# EAGLE schematic PKG900000001531 (EAGLE 7.7.0), part 1 of 2

## Sheet 1 of 32
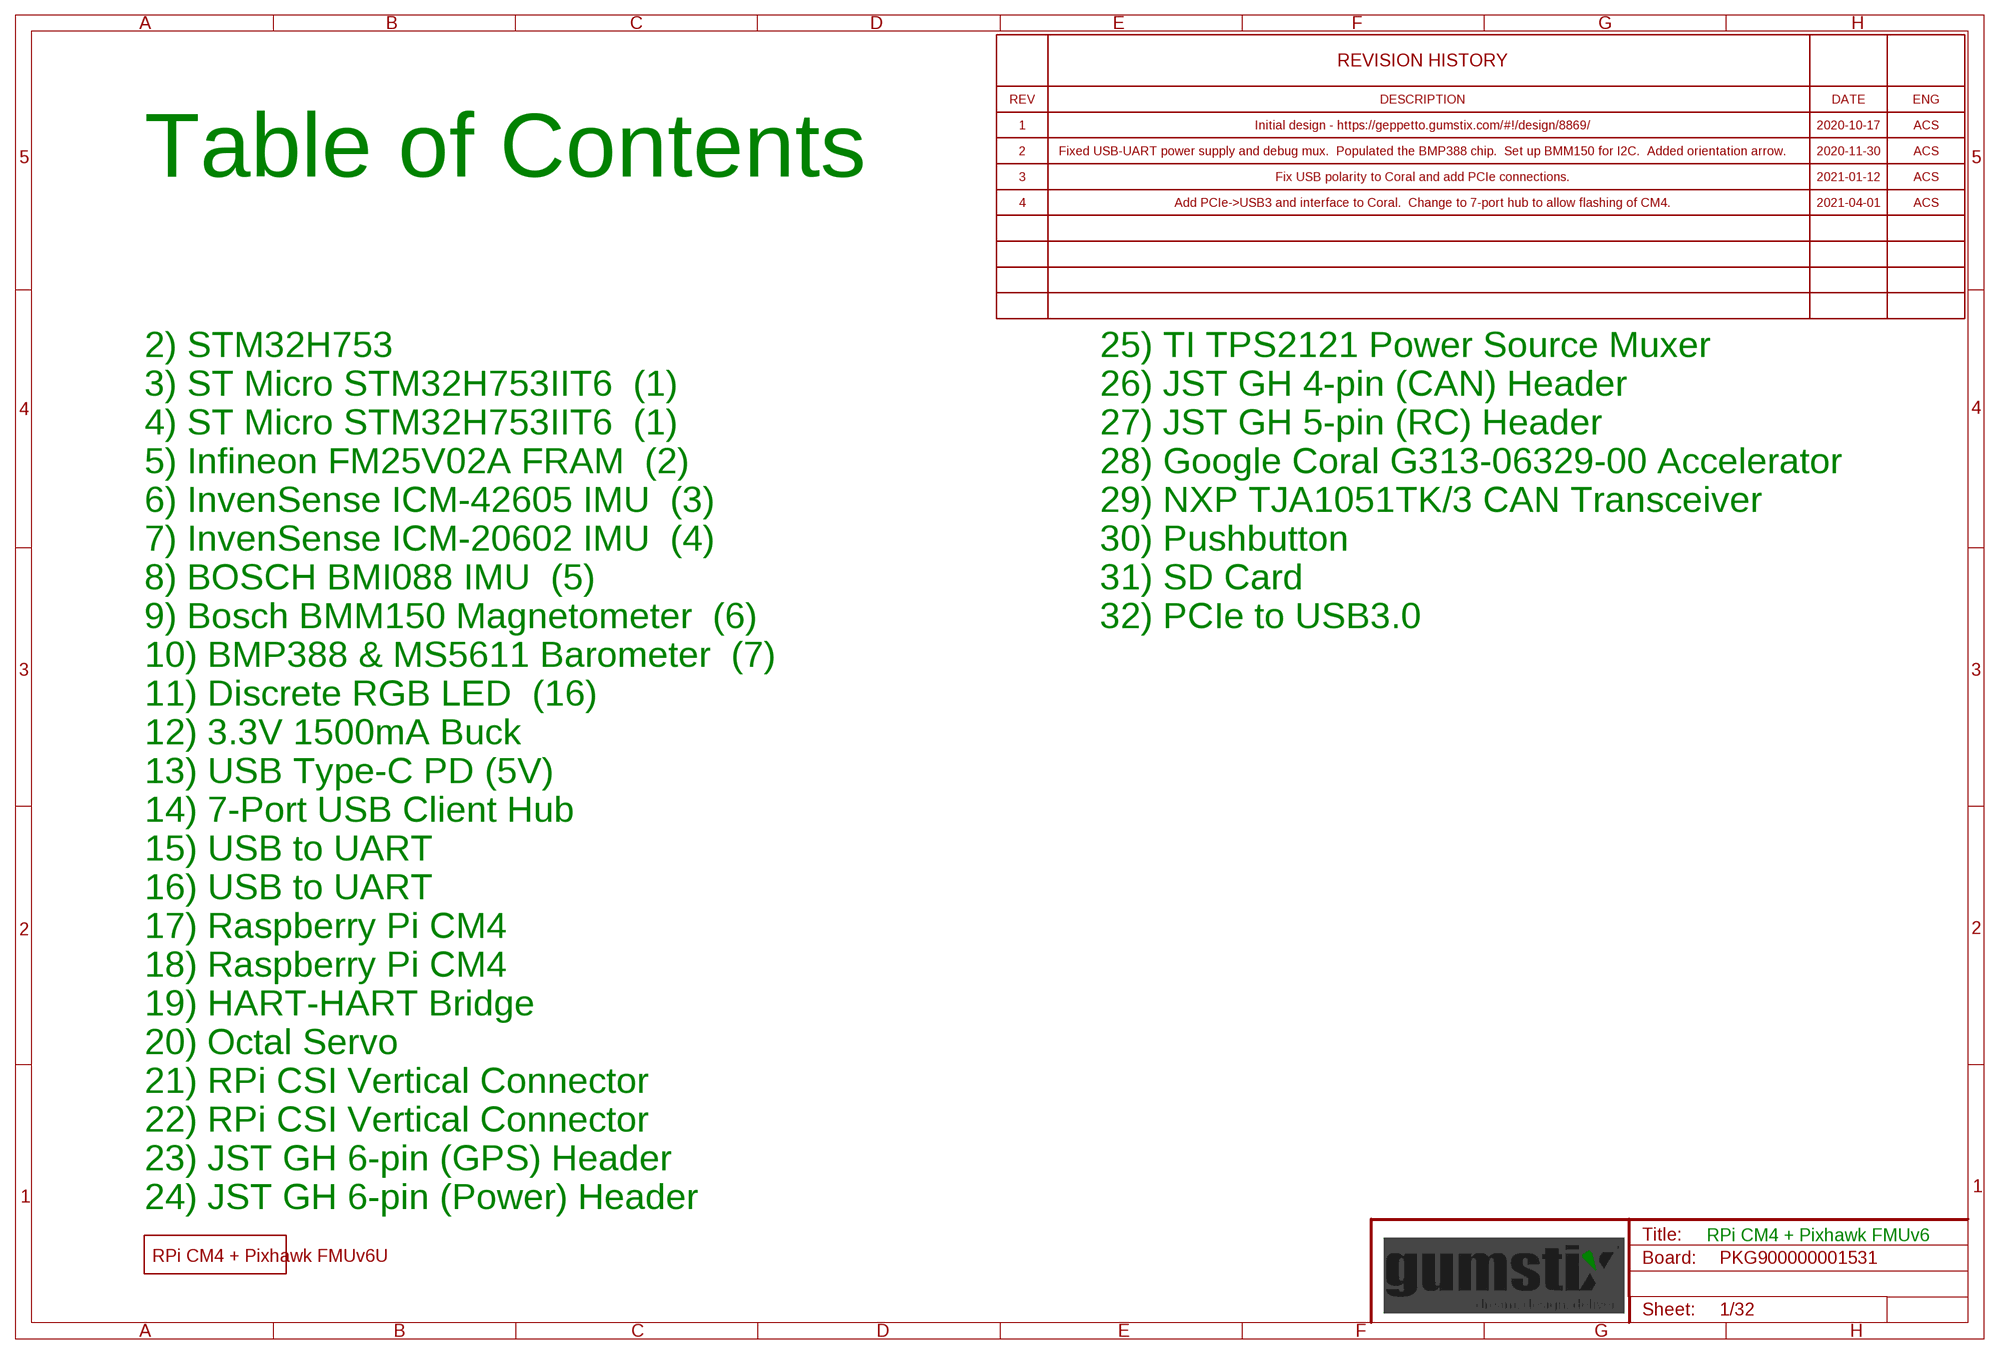
[diagram p0: schematic, sheet 1]
U$3 (REVISION_HISTORY_8): VALUE: DNP

### Parts
FD1  DNP  FIDUCIAL  [FIDUCIAL]
FD2  DNP  FIDUCIAL  [FIDUCIAL]
FD3  DNP  FIDUCIAL  [FIDUCIAL]
FD4  DNP  FIDUCIAL  [FIDUCIAL]
FD5  DNP  FIDUCIAL  [FIDUCIAL]
FD6  DNP  FIDUCIAL  [FIDUCIAL]
FD7  DNP  FIDUCIAL  [FIDUCIAL]
FD8  DNP  FIDUCIAL  [FIDUCIAL]
U$2  DNP  UPVERTER_LABELSMALL  [UPVERTER_LABEL_SMALL]

### Notes on the sheet
- 1 | Initial design - https://geppetto.gumstix.com/#\!/design/8869/ | 2020-10-17 | ACS
- 2 | Fixed USB-UART power supply and debug mux.  Populated the BMP388 chip.  Set up BMM150 for I2C.  Added orientation arrow. | 2020-11-30 | ACS
- Table of Contents | 3 | Fix USB polarity to Coral and add PCIe connections. | 2021-01-12 | ACS
- 4 | Add PCIe->USB3 and interface to Coral.  Change to 7-port hub to allow flashing of CM4. | 2021-04-01 | ACS
- 2) STM32H753 | 25) TI TPS2121 Power Source Muxer
- 3) ST Micro STM32H753IIT6  (1) | 26) JST GH 4-pin (CAN) Header
- 4) ST Micro STM32H753IIT6  (1) | 27) JST GH 5-pin (RC) Header
- 5) Infineon FM25V02A FRAM  (2) | 28) Google Coral G313-06329-00 Accelerator
- 6) InvenSense ICM-42605 IMU  (3) | 29) NXP TJA1051TK/3 CAN Transceiver
- 7) InvenSense ICM-20602 IMU  (4) | 30) Pushbutton
- 8) BOSCH BMI088 IMU  (5) | 31) SD Card
- 9) Bosch BMM150 Magnetometer  (6) | 32) PCIe to USB3.0
- 10) BMP388 & MS5611 Barometer  (7)
- 11) Discrete RGB LED  (16)
- 12) 3.3V 1500mA Buck
- 13) USB Type-C PD (5V)
- 14) 7-Port USB Client Hub
- 15) USB to UART
- 16) USB to UART
- 17) Raspberry Pi CM4
- 18) Raspberry Pi CM4
- 19) HART-HART Bridge
- 20) Octal Servo
- 21) RPi CSI Vertical Connector
- 22) RPi CSI Vertical Connector
- 23) JST GH 6-pin (GPS) Header
- 24) JST GH 6-pin (Power) Header
- RPi CM4 + Pixhawk FMUv6

## Sheet 2 of 32
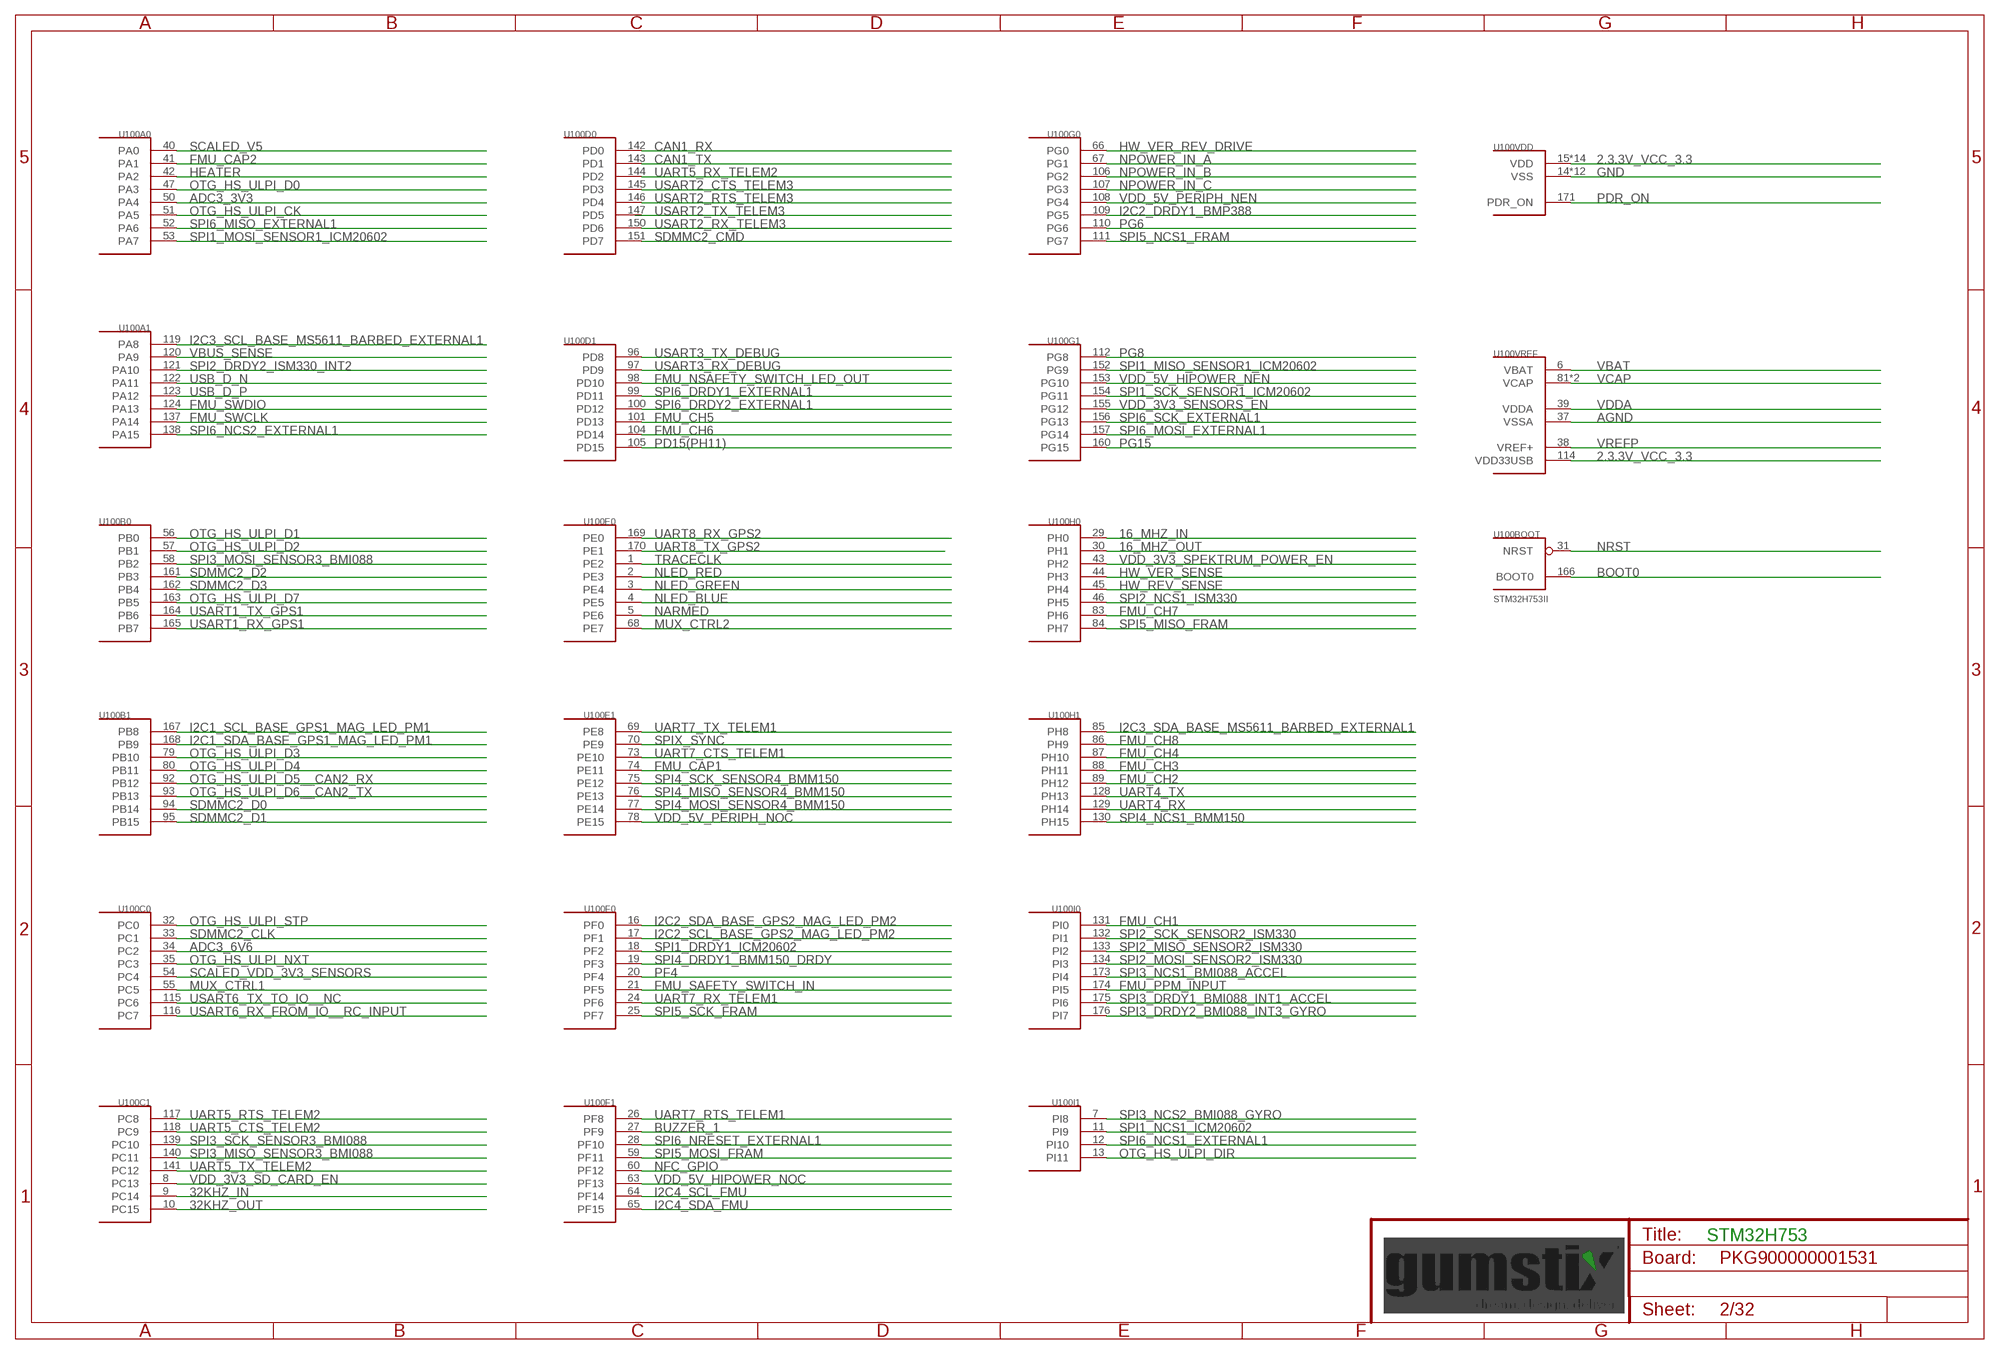
[diagram p1: schematic, sheet 2]

### Parts
U100  STM32H753II  [LQFP176]

### Nets
2.3.3V_VCC_3.3 [supply]: U100.15(VDD:VDD) U100.23(VDD:VDD) U100.36(VDD:VDD) U100.49(VDD:VDD) U100.62(VDD:VDD) U100.72(VDD:VDD) U100.82(VDD:VDD) U100.91(VDD:VDD) U100.103(VDD:VDD) U100.114(VREF:VDD33USB) U100.127(VDD:VDD) U100.136(VDD:VDD) U100.149(VDD:VDD) U100.159(VDD:VDD) U100.172(VDD:VDD) ; also sheet 3,4,5,11,12,14,15,19,20,21,22,29,30,32
16_MHZ_IN: U100.29(H0:PH0) ; also sheet 3
16_MHZ_OUT: U100.30(H0:PH1) ; also sheet 3
32KHZ_IN: U100.9(C1:PC14) ; also sheet 3
32KHZ_OUT: U100.10(C1:PC15) ; also sheet 3
ADC3_3V3: U100.50(A0:PA4) ; also sheet 24
ADC3_6V6: U100.34(C0:PC2) ; also sheet 24
AGND [supply]: U100.37(VREF:VSSA) ; also sheet 3
BOOT0: U100.166(BOOT:BOOT0) ; also sheet 3
BUZZER_1: U100.27(F1:PF9)
CAN1_RX: U100.142(D0:PD0) ; also sheet 29
CAN1_TX: U100.143(D0:PD1) ; also sheet 29
FMU_CAP1: U100.74(E1:PE11)
FMU_CAP2: U100.41(A0:PA1)
FMU_CH1: U100.131(I0:PI0) ; also sheet 20
FMU_CH2: U100.89(H1:PH12) ; also sheet 20
FMU_CH3: U100.88(H1:PH11) ; also sheet 20
FMU_CH4: U100.87(H1:PH10) ; also sheet 20
FMU_CH5: U100.101(D1:PD13) ; also sheet 20
FMU_CH6: U100.104(D1:PD14) ; also sheet 20
FMU_CH7: U100.83(H0:PH6) ; also sheet 20
FMU_CH8: U100.86(H1:PH9) ; also sheet 20
FMU_NSAFETY_SWITCH_LED_OUT: U100.98(D1:PD10)
FMU_PPM_INPUT: U100.174(I0:PI5) ; also sheet 27
FMU_SAFETY_SWITCH_IN: U100.21(F0:PF5)
FMU_SWCLK: U100.137(A1:PA14) ; also sheet 3
FMU_SWDIO: U100.124(A1:PA13) ; also sheet 3
GND [supply]: U100.14(VDD:VSS) U100.22(VDD:VSS) U100.48(VDD:VSS) U100.61(VDD:VSS) U100.71(VDD:VSS) U100.90(VDD:VSS) U100.102(VDD:VSS) U100.113(VDD:VSS) U100.126(VDD:VSS) U100.135(VDD:VSS) U100.148(VDD:VSS) U100.158(VDD:VSS) ; also sheet 3,4,5,6,7,8,9,10,12,13,14,15,16,17,18,19,20,21,22,23,24,25,26,27,28,29,30,31,32
HEATER: U100.42(A0:PA2)
HW_REV_SENSE: U100.45(H0:PH4) ; also sheet 3
HW_VER_REV_DRIVE: U100.66(PG0) ; also sheet 3
HW_VER_SENSE: U100.44(H0:PH3) ; also sheet 3
I2C1_SCL_BASE_GPS1_MAG_LED_PM1: U100.167(B1:PB8) ; also sheet 23
I2C1_SDA_BASE_GPS1_MAG_LED_PM1: U100.168(B1:PB9) ; also sheet 23
I2C2_DRDY1_BMP388: U100.109(PG5) ; also sheet 10
I2C2_SCL_BASE_GPS2_MAG_LED_PM2: U100.17(F0:PF1)
I2C2_SDA_BASE_GPS2_MAG_LED_PM2: U100.16(F0:PF0)
I2C3_SCL_BASE_MS5611_BARBED_EXTERNAL1: U100.119(A1:PA8) ; also sheet 10
I2C3_SDA_BASE_MS5611_BARBED_EXTERNAL1: U100.85(H1:PH8) ; also sheet 10
I2C4_SCL_FMU: U100.64(F1:PF14) ; also sheet 9,10
I2C4_SDA_FMU: U100.65(F1:PF15) ; also sheet 9,10
MUX_CTRL1: U100.55(C0:PC5)
MUX_CTRL2: U100.68(E0:PE7)
NARMED: U100.5(E0:PE6)
NFC_GPIO: U100.60(F1:PF12) ; also sheet 3
NLED_BLUE: U100.4(E0:PE5) ; also sheet 11
NLED_GREEN: U100.3(E0:PE4) ; also sheet 11
NLED_RED: U100.2(E0:PE3) ; also sheet 11
NPOWER_IN_A: U100.67(PG1)
NPOWER_IN_B: U100.106(PG2)
NPOWER_IN_C: U100.107(PG3)
NRST: U100.31(BOOT:NRST) ; also sheet 3,30
OTG_HS_ULPI_CK: U100.51(A0:PA5) ; also sheet 4
OTG_HS_ULPI_D0: U100.47(A0:PA3) ; also sheet 4
OTG_HS_ULPI_D1: U100.56(B0:PB0) ; also sheet 4
OTG_HS_ULPI_D2: U100.57(B0:PB1) ; also sheet 4
OTG_HS_ULPI_D3: U100.79(B1:PB10) ; also sheet 4
OTG_HS_ULPI_D4: U100.80(B1:PB11) ; also sheet 4
OTG_HS_ULPI_D5__CAN2_RX: U100.92(B1:PB12) ; also sheet 4
OTG_HS_ULPI_D6__CAN2_TX: U100.93(B1:PB13) ; also sheet 4
OTG_HS_ULPI_D7: U100.163(B0:PB5) ; also sheet 4
OTG_HS_ULPI_DIR: U100.13(I1:PI11) ; also sheet 4
OTG_HS_ULPI_NXT: U100.35(C0:PC3) ; also sheet 4
OTG_HS_ULPI_STP: U100.32(C0:PC0) ; also sheet 4
PD15(PH11): U100.105(D1:PD15) ; also sheet 3
PDR_ON: U100.171(VDD:PDR_ON) ; also sheet 3
PF4: U100.20(F0:PF4)
PG6: U100.110(PG6)
PG8: U100.112(PG8)
PG15: U100.160(PG15)
SCALED_V5 [supply]: U100.40(A0:PA0) ; also sheet 3
SCALED_VDD_3V3_SENSORS: U100.54(C0:PC4) ; also sheet 3
SDMMC2_CLK: U100.33(C0:PC1) ; also sheet 31
SDMMC2_CMD: U100.151(D0:PD7) ; also sheet 31
SDMMC2_D0: U100.94(B1:PB14) ; also sheet 31
SDMMC2_D1: U100.95(B1:PB15) ; also sheet 31
SDMMC2_D2: U100.161(B0:PB3) ; also sheet 31
SDMMC2_D3: U100.162(B0:PB4) ; also sheet 31
SPI1_DRDY1_ICM20602: U100.18(F0:PF2) ; also sheet 7
SPI1_MISO_SENSOR1_ICM20602: U100.152(PG9) ; also sheet 7
SPI1_MOSI_SENSOR1_ICM20602: U100.53(A0:PA7) ; also sheet 7
SPI1_NCS1_ICM20602: U100.11(I1:PI9) ; also sheet 7
SPI1_SCK_SENSOR1_ICM20602: U100.154(PG11) ; also sheet 7
SPI2_DRDY2_ISM330_INT2: U100.121(A1:PA10) ; also sheet 6
SPI2_MISO_SENSOR2_ISM330: U100.133(I0:PI2) ; also sheet 6
SPI2_MOSI_SENSOR2_ISM330: U100.134(I0:PI3) ; also sheet 6
SPI2_NCS1_ISM330: U100.46(H0:PH5) ; also sheet 6
SPI2_SCK_SENSOR2_ISM330: U100.132(I0:PI1) ; also sheet 6
SPI3_DRDY1_BMI088_INT1_ACCEL: U100.175(I0:PI6) ; also sheet 8
SPI3_DRDY2_BMI088_INT3_GYRO: U100.176(I0:PI7) ; also sheet 8
SPI3_MISO_SENSOR3_BMI088: U100.140(C1:PC11) ; also sheet 8
SPI3_MOSI_SENSOR3_BMI088: U100.58(B0:PB2) ; also sheet 8
SPI3_NCS1_BMI088_ACCEL: U100.173(I0:PI4) ; also sheet 8
SPI3_NCS2_BMI088_GYRO: U100.7(I1:PI8) ; also sheet 8
SPI3_SCK_SENSOR3_BMI088: U100.139(C1:PC10) ; also sheet 8
SPI4_DRDY1_BMM150_DRDY: U100.19(F0:PF3) ; also sheet 9
SPI4_MISO_SENSOR4_BMM150: U100.76(E1:PE13) ; also sheet 9
SPI4_MOSI_SENSOR4_BMM150: U100.77(E1:PE14) ; also sheet 9
SPI4_NCS1_BMM150: U100.130(H1:PH15) ; also sheet 9
SPI4_SCK_SENSOR4_BMM150: U100.75(E1:PE12) ; also sheet 9
SPI5_MISO_FRAM: U100.84(H0:PH7) ; also sheet 5
SPI5_MOSI_FRAM: U100.59(F1:PF11) ; also sheet 5
SPI5_NCS1_FRAM: U100.111(PG7) ; also sheet 5
SPI5_SCK_FRAM: U100.25(F0:PF7) ; also sheet 5
SPI6_DRDY1_EXTERNAL1: U100.99(D1:PD11)
SPI6_DRDY2_EXTERNAL1: U100.100(D1:PD12)
SPI6_MISO_EXTERNAL1: U100.52(A0:PA6)
SPI6_MOSI_EXTERNAL1: U100.157(PG14)
SPI6_NCS1_EXTERNAL1: U100.12(I1:PI10)
SPI6_NCS2_EXTERNAL1: U100.138(A1:PA15)
SPI6_NRESET_EXTERNAL1: U100.28(F1:PF10)
SPI6_SCK_EXTERNAL1: U100.156(PG13) ; also sheet 3
SPIX_SYNC: U100.70(E1:PE9)
TRACECLK: U100.1(E0:PE2)
UART4_RX: U100.129(H1:PH14)
UART4_TX: U100.128(H1:PH13)
UART5_CTS_TELEM2: U100.118(C1:PC9) ; also sheet 19
UART5_RTS_TELEM2: U100.117(C1:PC8) ; also sheet 19
UART5_RX_TELEM2: U100.144(D0:PD2) ; also sheet 19
UART5_TX_TELEM2: U100.141(C1:PC12) ; also sheet 19
UART7_CTS_TELEM1: U100.73(E1:PE10)
UART7_RTS_TELEM1: U100.26(F1:PF8)
UART7_RX_TELEM1: U100.24(F0:PF6) ; also sheet 19
UART7_TX_TELEM1: U100.69(E1:PE8) ; also sheet 19
UART8_RX_GPS2: U100.169(E0:PE0)
UART8_TX_GPS2: U100.170(E0:PE1)
USART1_RX_GPS1: U100.165(B0:PB7) ; also sheet 23
USART1_TX_GPS1: U100.164(B0:PB6) ; also sheet 23
USART2_CTS_TELEM3: U100.145(D0:PD3)
USART2_RTS_TELEM3: U100.146(D0:PD4)
USART2_RX_TELEM3: U100.150(D0:PD6)
USART3_RX_DEBUG: U100.97(D1:PD9) ; also sheet 15
USART3_TX_DEBUG: U100.96(D1:PD8) ; also sheet 15
USART6_RX_FROM_IO__RC_INPUT: U100.116(C0:PC7) ; also sheet 27
USART6_TX_TO_IO__NC: U100.115(C0:PC6)
USB_D_N [USB]: U100.122(A1:PA11) ; also sheet 14
USB_D_P [USB]: U100.123(A1:PA12) ; also sheet 14
VBAT [supply]: U100.6(VREF:VBAT) ; also sheet 3
VBUS_SENSE [supply]: U100.120(A1:PA9) ; also sheet 4,13,15,16
VCAP [supply]: U100.81(VREF:VCAP) U100.125(VREF:VCAP) ; also sheet 3
VDD_3V3_SD_CARD_EN: U100.8(C1:PC13) ; also sheet 3
VDD_3V3_SENSORS_EN: U100.155(PG12) ; also sheet 3
VDD_3V3_SPEKTRUM_POWER_EN: U100.43(H0:PH2) ; also sheet 3
VDD_5V_HIPOWER_NEN: U100.153(PG10) ; also sheet 3
VDD_5V_HIPOWER_NOC: U100.63(F1:PF13) ; also sheet 3
VDD_5V_PERIPH_NEN: U100.108(PG4) ; also sheet 3
VDD_5V_PERIPH_NOC: U100.78(E1:PE15) ; also sheet 3
VDDA [supply]: U100.39(VREF:VDDA) ; also sheet 3
VREFP [supply]: U100.38(VREF:VREF+) ; also sheet 3
Unconnected: U100.147(D0:PD5)

### Notes on the sheet
- STM32H753

## Sheet 3 of 32
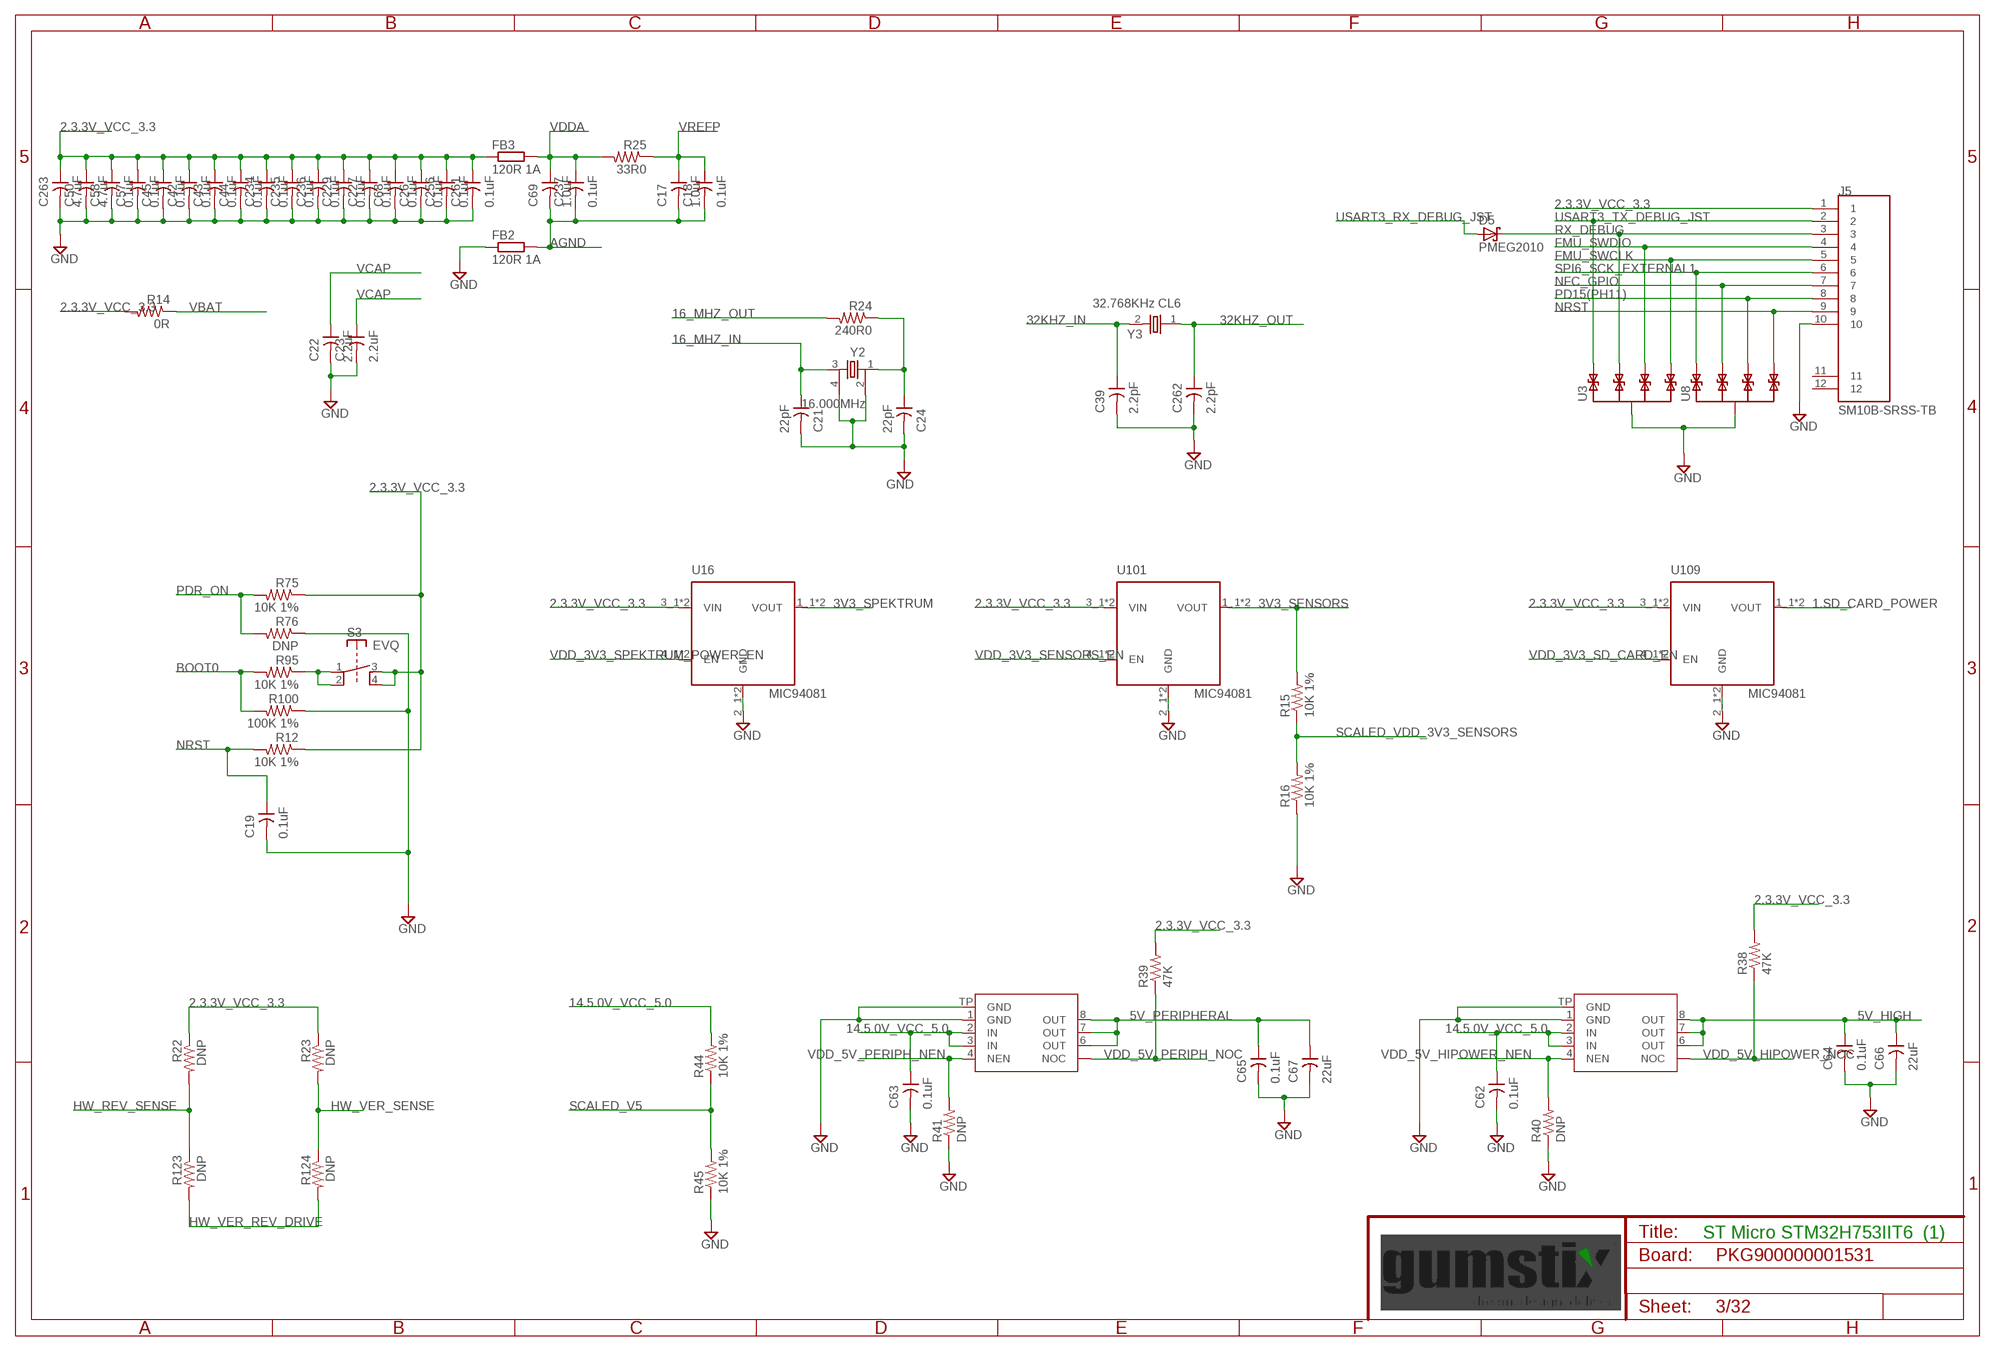
[diagram p2: schematic, sheet 3]

### Parts
C17  1.0uF  C0402  [0402]
C18  0.1uF  C0201  [0201]
C19  0.1uF  C0201  [0201]
C21  22pF  C0201  [0201]
C22  2.2uF  C0603  [0603]
C23  2.2uF  C0603  [0603]
C24  22pF  C0201  [0201]
C26  0.1uF  C0201  [0201]
C39  2.2pF  C0201  [0201]
C42  0.1uF  C0201  [0201]
C43  0.1uF  C0201  [0201]
C44  0.1uF  C0201  [0201]
C45  0.1uF  C0201  [0201]
C50  4.7uF  C0603  [0603]
C57  0.1uF  C0201  [0201]
C58  0.1uF  C0201  [0201]
C62  0.1uF  C0201  [0201]
C63  0.1uF  C0201  [0201]
C64  0.1uF  C0201  [0201]
C65  0.1uF  C0201  [0201]
C66  22uF  C0805  [0805]
C67  22uF  C0805  [0805]
C68  0.1uF  C0201  [0201]
C69  1.0uF  C0402  [0402]
C227  0.1uF  C0201  [0201]
C229  0.1uF  C0201  [0201]
C234  0.1uF  C0201  [0201]
C235  0.1uF  C0201  [0201]
C236  0.1uF  C0201  [0201]
C237  0.1uF  C0201  [0201]
C256  0.1uF  C0201  [0201]
C261  0.1uF  C0201  [0201]
C262  2.2pF  C0201  [0201]
C263  4.7uF  C0603  [0603]
D5  PMEG2010  SCHOTTKY-DIODESOD123F  [SOD123F]
FB2  120R 1A  FB0402  [0402]
FB3  120R 1A  FB0402  [0402]
J5  SM10B-SRSS-TB  [SM10B-SRSS-TB]
R12  10K 1%  R0201  [0201]
R14  0R  R0402  [0402]
R15  10K 1%  R0201  [0201]
R16  10K 1%  R0201  [0201]
R22  DNP  R0201  [0201]
R23  DNP  R0201  [0201]
R24  240R0  R0201  [0201]
R25  33R0  R0201  [0201]
R38  47K  R0201  [0201]
R39  47K  R0201  [0201]
R40  DNP  R0201  [0201]
R41  DNP  R0201  [0201]
R44  10K 1%  R0201  [0201]
R45  10K 1%  R0201  [0201]
R75  10K 1%  R0201  [0201]
R76  DNP  R0201  [0201]
R95  10K 1%  R0201  [0201]
R100  100K 1%  R0201  [0201]
R123  DNP  R0201  [0201]
R124  DNP  R0201  [0201]
S3  EVQ  EVQKMT0  [KMT0]
U1  TPS2041BDGN  TPS2041DGN  [MSOP8-PAD]
U3  TPD4E02B0410-USON  [UFDFN-10]
U8  TPD4E02B0410-USON  [UFDFN-10]
U16  MIC94081  MIC94080  [FTDFN-4]
U25  TPS2041BDGN  TPS2041DGN  [MSOP8-PAD]
U101  MIC94081  MIC94080  [FTDFN-4]
U109  MIC94081  MIC94080  [FTDFN-4]
Y2  16.000MHz  Y4CRYSTAL-3225  [CRYSTAL-3225]
Y3  32.768KHz CL6  X21206  [1206]

### Nets
1.SD_CARD_POWER: U109.1_1(VOUT) U109.1_2(VOUT) ; also sheet 31
2.3.3V_VCC_3.3 [supply]: C26.1 C42.1 C43.1 C44.1 C45.1 C50.1 C57.1 C58.1 C68.1 C227.1 C229.1 C234.1 C235.1 C236.1 C256.1 C261.1 C263.1 FB3.1 J5.1 R12.1 R14.2 R22.1 R23.1 R38.2 R39.2 R75.1 S3.3(B) S3.4(B') U16.3_1(VIN) U16.3_2(VIN) U101.3_1(VIN) U101.3_2(VIN) U109.3_1(VIN) U109.3_2(VIN) ; also sheet 2,4,5,11,12,14,15,19,20,21,22,29,30,32
3V3_SENSORS [supply]: R15.2 U101.1_1(VOUT) U101.1_2(VOUT) ; also sheet 6,7,8,9,10
3V3_SPEKTRUM [supply]: U16.1_1(VOUT) U16.1_2(VOUT) ; also sheet 27
5V_HIGH [supply]: C64.1 C66.1 U25.6(OUT) U25.7(OUT) U25.8(OUT) ; also sheet 20
5V_PERIPHERAL [supply]: C65.1 C67.1 U1.6(OUT) U1.7(OUT) U1.8(OUT) ; also sheet 23,26,27,29
14.5.0V_VCC_5.0 [supply]: C62.1 C63.1 R44.2 U1.2(IN) U1.3(IN) U25.2(IN) U25.3(IN) ; also sheet 12,17,25
16_MHZ_IN: C21.1 Y2.3 ; also sheet 2
16_MHZ_OUT: R24.2 ; also sheet 2
32KHZ_IN: C39.1 Y3.2 ; also sheet 2
32KHZ_OUT: C262.1 Y3.1 ; also sheet 2
AGND [supply]: C17.2 C18.2 C69.2 C237.2 FB2.2 ; also sheet 2
BOOT0: R95.2 R100.2 ; also sheet 2
BOOTBUT$1: R95.1 S3.1(A) S3.2(A')
FMU_SWCLK: J5.5 U3.5(P4) U3.6(P4) ; also sheet 2
FMU_SWDIO: J5.4 U3.4(P3) U3.7(P3) ; also sheet 2
GND [supply]: C19.2 C21.2 C22.2 C23.2 C24.2 C26.2 C39.2 C42.2 C43.2 C44.2 C45.2 C50.2 C57.2 C58.2 C62.2 C63.2 C64.2 C65.2 C66.2 C67.2 C68.2 C227.2 C229.2 C234.2 C235.2 C236.2 C256.2 C261.2 C262.2 C263.2 FB2.1 J5.10 R16.1 R40.1 R41.1 R45.1 R76.1 R100.1 U1.1(GND) U1.TP(GND) U3.3(SHIELD) U3.8(SHIELD) U8.3(SHIELD) U8.8(SHIELD) U16.2_1(GND) U16.2_2(GND) U25.1(GND) U25.TP(GND) U101.2_1(GND) U101.2_2(GND) U109.2_1(GND) U109.2_2(GND) Y2.2 Y2.4 ; also sheet 2,4,5,6,7,8,9,10,12,13,14,15,16,17,18,19,20,21,22,23,24,25,26,27,28,29,30,31,32
HW_REV_SENSE: R22.2 R123.1 ; also sheet 2
HW_VER_REV_DRIVE: R123.2 R124.2 ; also sheet 2
HW_VER_SENSE: R23.2 R124.1 ; also sheet 2
NFC_GPIO: J5.7 U8.2 U8.9(P2) ; also sheet 2
NRST: C19.1 J5.9 R12.2 U8.5(P4) U8.6(P4) ; also sheet 2,30
PD15(PH11): J5.8 U8.4(P3) U8.7(P3) ; also sheet 2
PDR_ON: R75.2 R76.2 ; also sheet 2
RX_DEBUG: D5.C J5.3 U3.2 U3.9(P2)
SCALED_V5 [supply]: R44.1 R45.2 ; also sheet 2
SCALED_VDD_3V3_SENSORS: R15.1 R16.2 ; also sheet 2
SPI6_SCK_EXTERNAL1: J5.6 U8.1 U8.10(P1) ; also sheet 2
STM_OSC2$1: C24.1 R24.1 Y2.1
USART3_RX_DEBUG_JST: D5.A ; also sheet 15
USART3_TX_DEBUG_JST: J5.2 U3.1 U3.10(P1) ; also sheet 15
VBAT [supply]: R14.1 ; also sheet 2
VCAP [supply]: C22.1 C23.1 ; also sheet 2
VDD_3V3_SD_CARD_EN: U109.4_1(EN) U109.4_2(EN) ; also sheet 2
VDD_3V3_SENSORS_EN: U101.4_1(EN) U101.4_2(EN) ; also sheet 2
VDD_3V3_SPEKTRUM_POWER_EN: U16.4_1(EN) U16.4_2(EN) ; also sheet 2
VDD_5V_HIPOWER_NEN: R40.2 U25.4(NEN) ; also sheet 2
VDD_5V_HIPOWER_NOC: R38.1 U25.5(NOC) ; also sheet 2
VDD_5V_PERIPH_NEN: R41.2 U1.4(NEN) ; also sheet 2
VDD_5V_PERIPH_NOC: R39.1 U1.5(NOC) ; also sheet 2
VDDA [supply]: C69.1 C237.1 FB3.2 R25.2 ; also sheet 2
VREFP [supply]: C17.1 C18.1 R25.1 ; also sheet 2
Unconnected: J5.11 J5.12

### Notes on the sheet
- ST Micro STM32H753IIT6  (1)

## Sheet 4 of 32
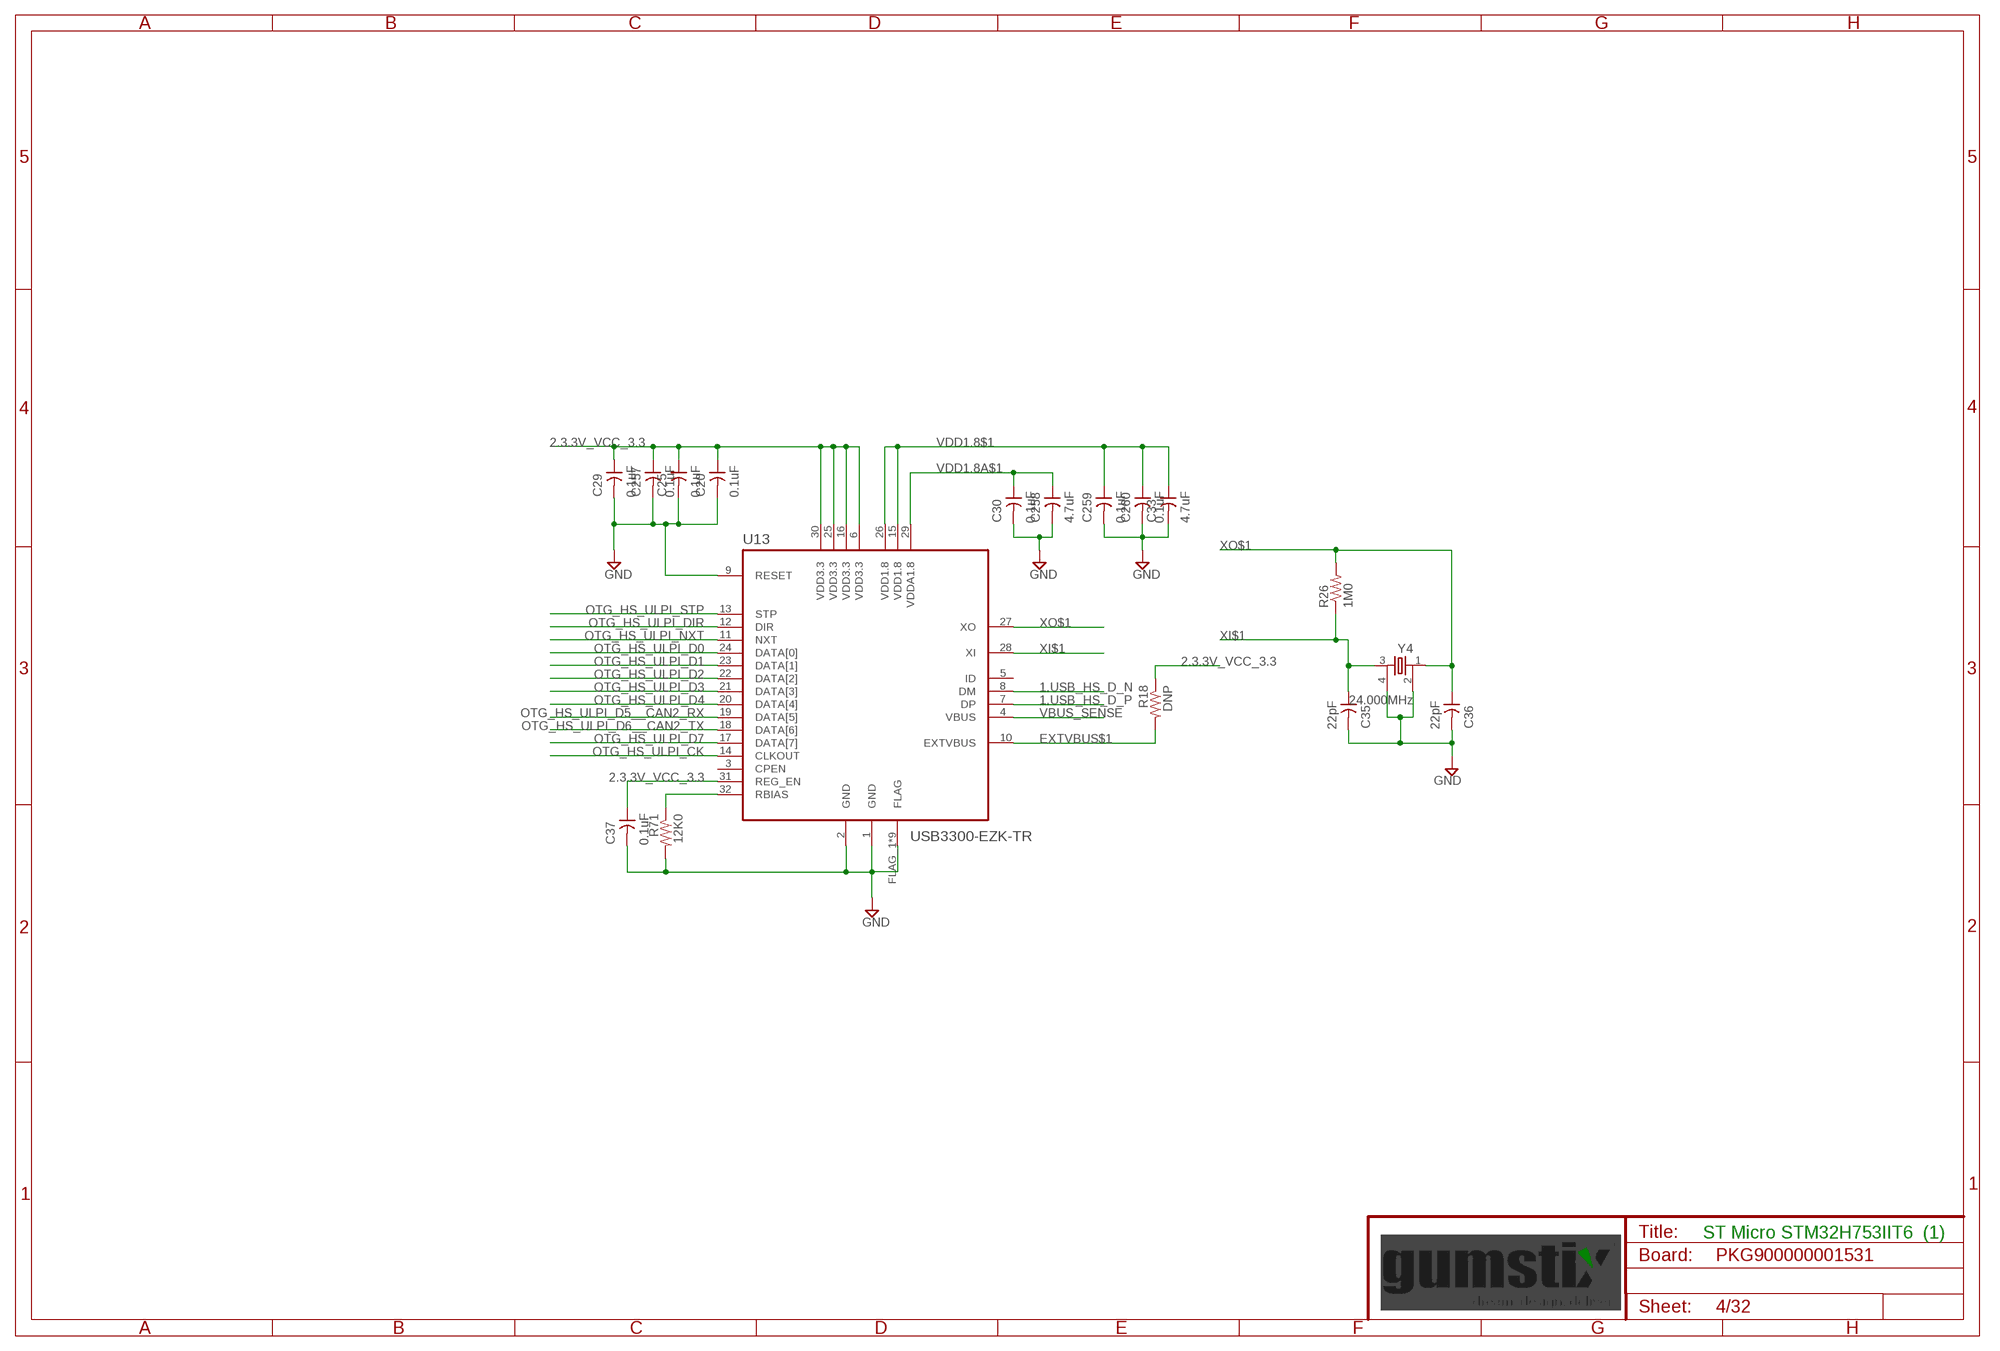
[diagram p3: schematic, sheet 4]

### Parts
C20  0.1uF  C0201  [0201]
C25  0.1uF  C0201  [0201]
C29  0.1uF  C0201  [0201]
C30  0.1uF  C0201  [0201]
C33  4.7uF  C0603  [0603]
C35  22pF  C0201  [0201]
C36  22pF  C0201  [0201]
C37  0.1uF  C0201  [0201]
C257  0.1uF  C0201  [0201]
C258  4.7uF  C0603  [0603]
C259  0.1uF  C0201  [0201]
C260  0.1uF  C0201  [0201]
R18  DNP  R0201  [0201]
R26  1M0  R0402  [0402]
R71  12K0  R0402  [0402]
U13  USB3300-EZK-TR  [QFN32-USB3300]
Y4  24.000MHz  Y4CRYSTAL-3225  [CRYSTAL-3225]

### Nets
1.USB_HS_D_N [USB]: U13.8(DM) ; also sheet 14
1.USB_HS_D_P [USB]: U13.7(DP) ; also sheet 14
2.3.3V_VCC_3.3 [supply]: C20.1 C25.1 C29.1 C37.1 C257.1 R18.1 U13.6(VDD3.3) U13.16(VDD3.3) U13.25(VDD3.3) U13.30(VDD3.3) U13.31(REG_EN) ; also sheet 2,3,5,11,12,14,15,19,20,21,22,29,30,32
EXTVBUS$1: R18.2 U13.10(EXTVBUS)
GND [supply]: C20.2 C25.2 C29.2 C30.2 C33.2 C35.2 C36.2 C37.2 C257.2 C258.2 C259.2 C260.2 R71.2 U13.1(GND) U13.2(GND) U13.9(RESET) U13.FLAG_1(FLAG) U13.FLAG_2(FLAG) U13.FLAG_3(FLAG) U13.FLAG_4(FLAG) U13.FLAG_5(FLAG) U13.FLAG_6(FLAG) U13.FLAG_7(FLAG) U13.FLAG_8(FLAG) U13.FLAG_9(FLAG) Y4.2 Y4.4 ; also sheet 2,3,5,6,7,8,9,10,12,13,14,15,16,17,18,19,20,21,22,23,24,25,26,27,28,29,30,31,32
OTG_HS_ULPI_CK: U13.14(CLKOUT) ; also sheet 2
OTG_HS_ULPI_D0: U13.24(DATA[0]) ; also sheet 2
OTG_HS_ULPI_D1: U13.23(DATA[1]) ; also sheet 2
OTG_HS_ULPI_D2: U13.22(DATA[2]) ; also sheet 2
OTG_HS_ULPI_D3: U13.21(DATA[3]) ; also sheet 2
OTG_HS_ULPI_D4: U13.20(DATA[4]) ; also sheet 2
OTG_HS_ULPI_D5__CAN2_RX: U13.19(DATA[5]) ; also sheet 2
OTG_HS_ULPI_D6__CAN2_TX: U13.18(DATA[6]) ; also sheet 2
OTG_HS_ULPI_D7: U13.17(DATA[7]) ; also sheet 2
OTG_HS_ULPI_DIR: U13.12(DIR) ; also sheet 2
OTG_HS_ULPI_NXT: U13.11(NXT) ; also sheet 2
OTG_HS_ULPI_STP: U13.13(STP) ; also sheet 2
RBIAS$1: R71.1 U13.32(RBIAS)
VBUS_SENSE [supply]: U13.4(VBUS) ; also sheet 2,13,15,16
VDD1.8$1 [supply]: C33.1 C259.1 C260.1 U13.15(VDD1.8) U13.26(VDD1.8)
VDD1.8A$1 [supply]: C30.1 C258.1 U13.29(VDDA1.8)
XI$1: C35.1 R26.1 U13.28(XI) Y4.3
XO$1: C36.1 R26.2 U13.27(XO) Y4.1
Unconnected: U13.3(CPEN) U13.5(ID)

### Notes on the sheet
- ST Micro STM32H753IIT6  (1)

## Sheet 5 of 32
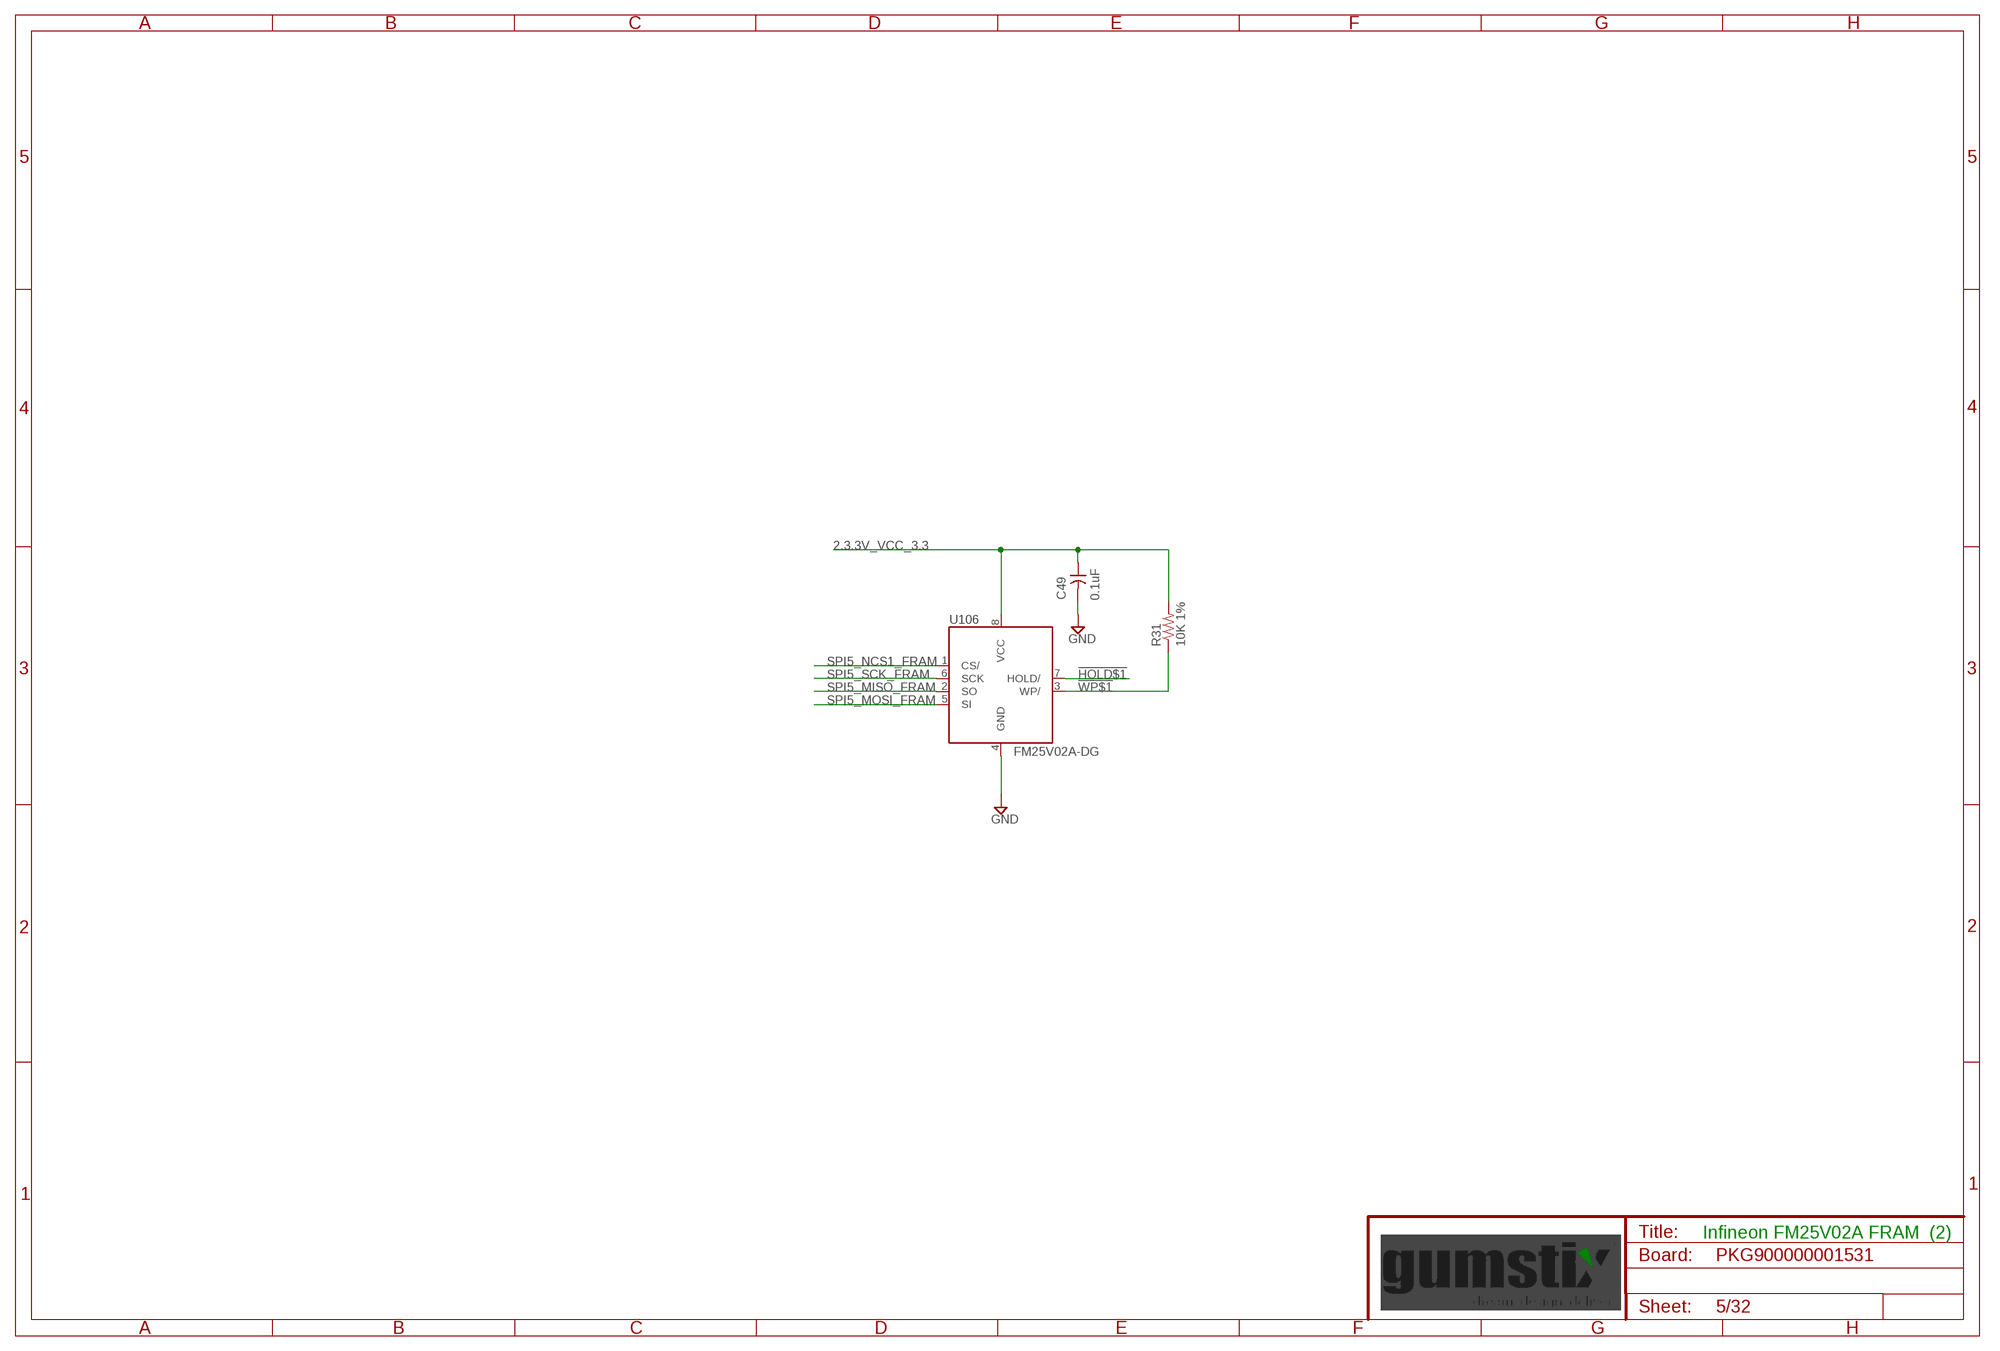
[diagram p4: schematic, sheet 5]

### Parts
C49  0.1uF  C0201  [0201]
R31  10K 1%  R0201  [0201]
U106  FM25V02A-DG  [DFN8-4X4.5]

### Nets
2.3.3V_VCC_3.3 [supply]: C49.1 R31.2 U106.8(VCC) ; also sheet 2,3,4,11,12,14,15,19,20,21,22,29,30,32
!HOLD$1: U106.7(HOLD/)
!WP$1: R31.1 U106.3(WP/)
GND [supply]: C49.2 U106.4(GND) ; also sheet 2,3,4,6,7,8,9,10,12,13,14,15,16,17,18,19,20,21,22,23,24,25,26,27,28,29,30,31,32
SPI5_MISO_FRAM: U106.2(SO) ; also sheet 2
SPI5_MOSI_FRAM: U106.5(SI) ; also sheet 2
SPI5_NCS1_FRAM: U106.1(CS/) ; also sheet 2
SPI5_SCK_FRAM: U106.6(SCK) ; also sheet 2

### Notes on the sheet
- Infineon FM25V02A FRAM  (2)

## Sheet 6 of 32
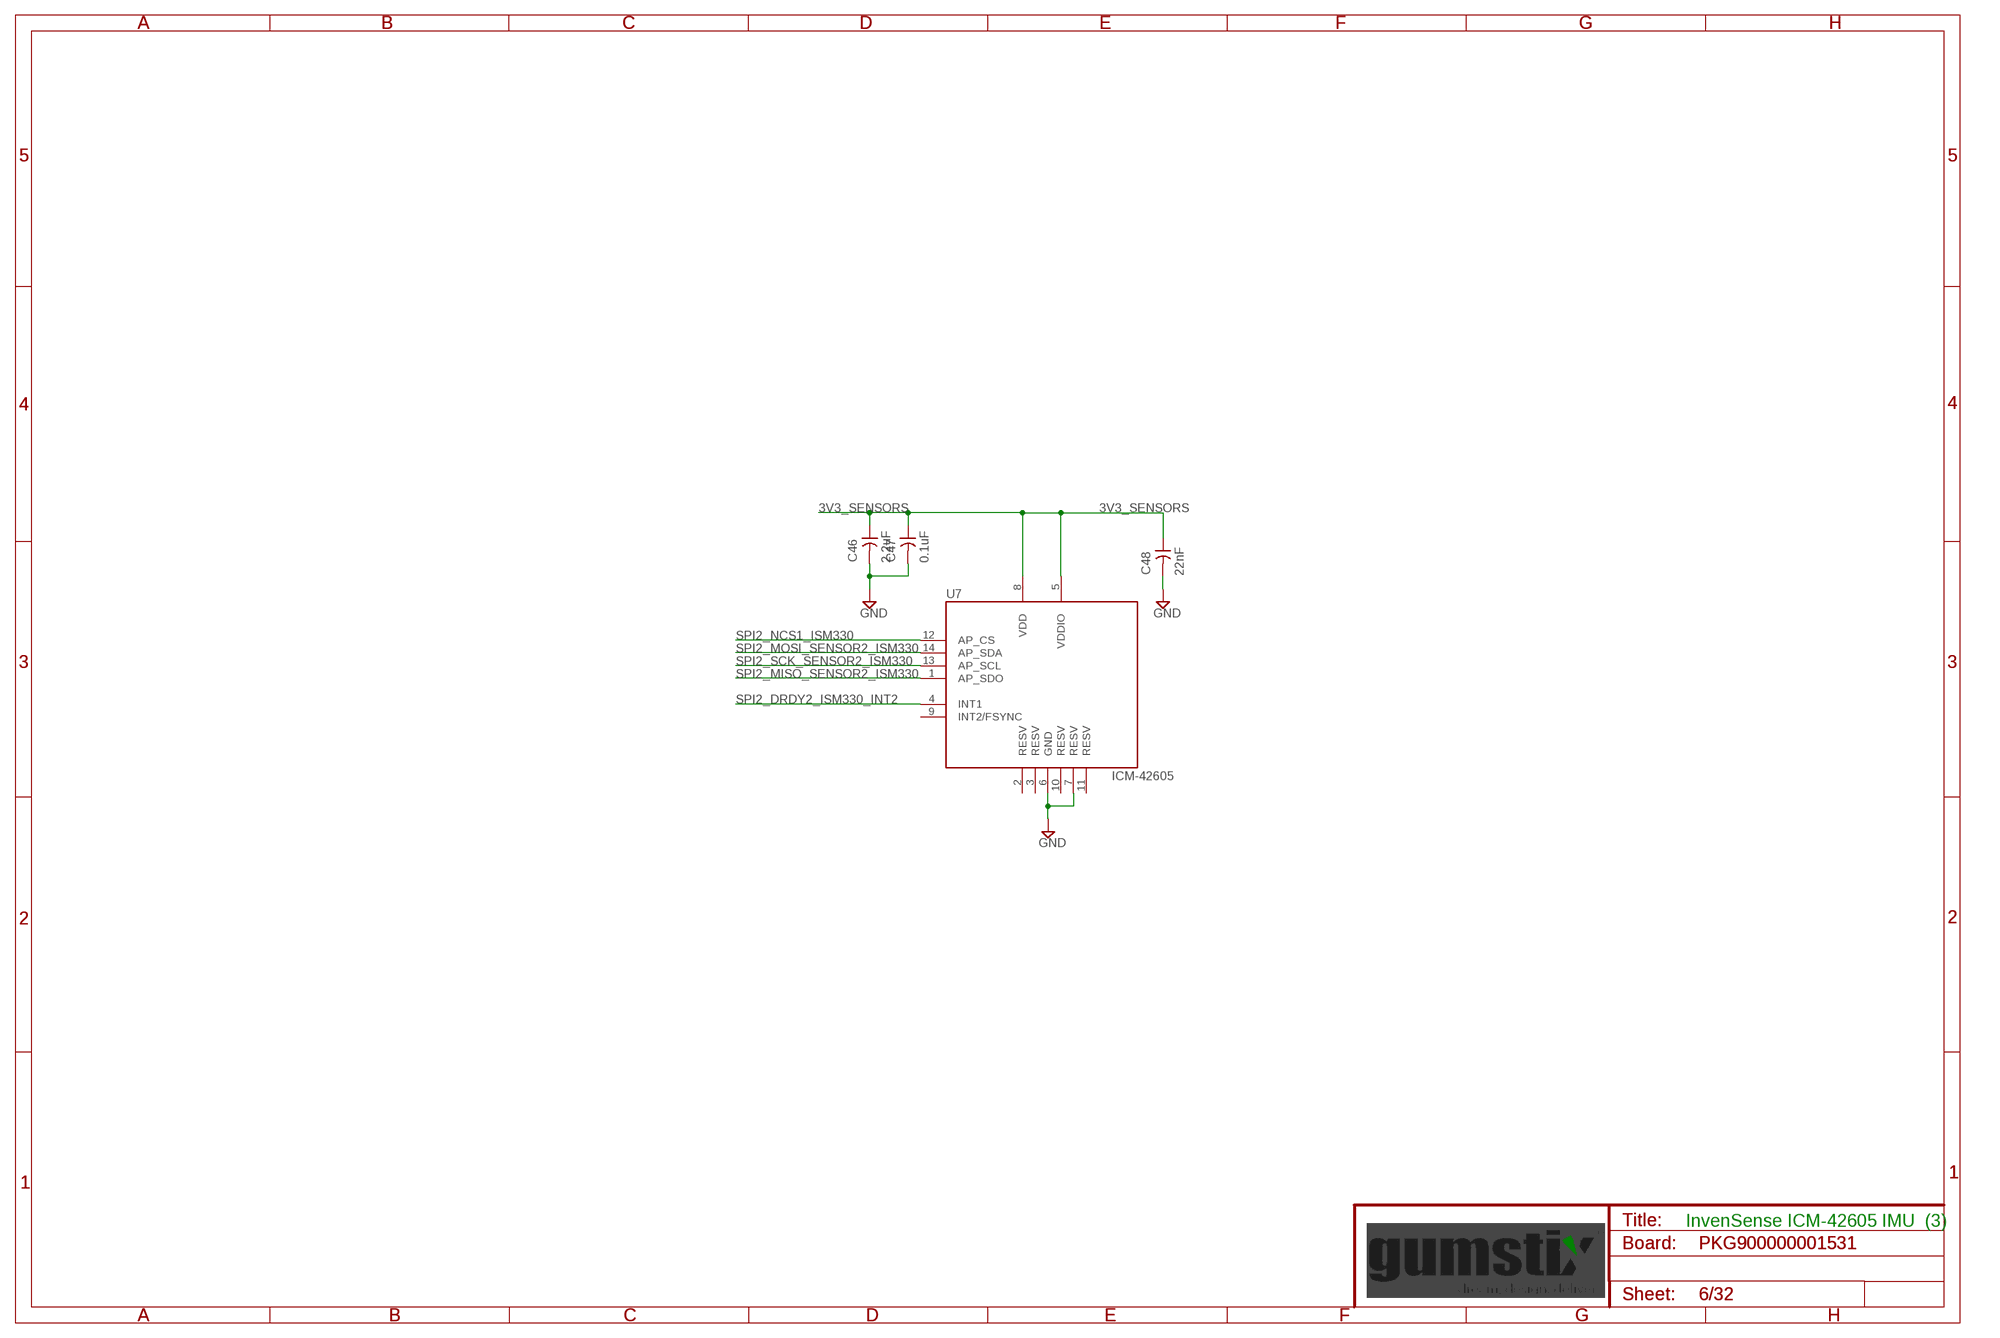
[diagram p5: schematic, sheet 6]

### Parts
C46  2.2uF  C0402  [0402]
C47  0.1uF  C0201  [0201]
C48  22nF  C0201  [0201]
U7  ICM-42605  ICM-42688-P  [LGA14-2.5X3MM]

### Nets
3V3_SENSORS [supply]: C46.1 C47.1 C48.1 U7.5(VDDIO) U7.8(VDD) ; also sheet 3,7,8,9,10
GND [supply]: C46.2 C47.2 C48.2 U7.6(GND) U7.7(RESV) ; also sheet 2,3,4,5,7,8,9,10,12,13,14,15,16,17,18,19,20,21,22,23,24,25,26,27,28,29,30,31,32
SPI2_DRDY2_ISM330_INT2: U7.4(INT1) ; also sheet 2
SPI2_MISO_SENSOR2_ISM330: U7.1(AP_SDO) ; also sheet 2
SPI2_MOSI_SENSOR2_ISM330: U7.14(AP_SDA) ; also sheet 2
SPI2_NCS1_ISM330: U7.12(AP_CS) ; also sheet 2
SPI2_SCK_SENSOR2_ISM330: U7.13(AP_SCL) ; also sheet 2
Unconnected: U7.2(RESV) U7.3(RESV) U7.9(INT2/FSYNC) U7.10(RESV) U7.11(RESV)

### Notes on the sheet
- InvenSense ICM-42605 IMU  (3)

## Sheet 7 of 32
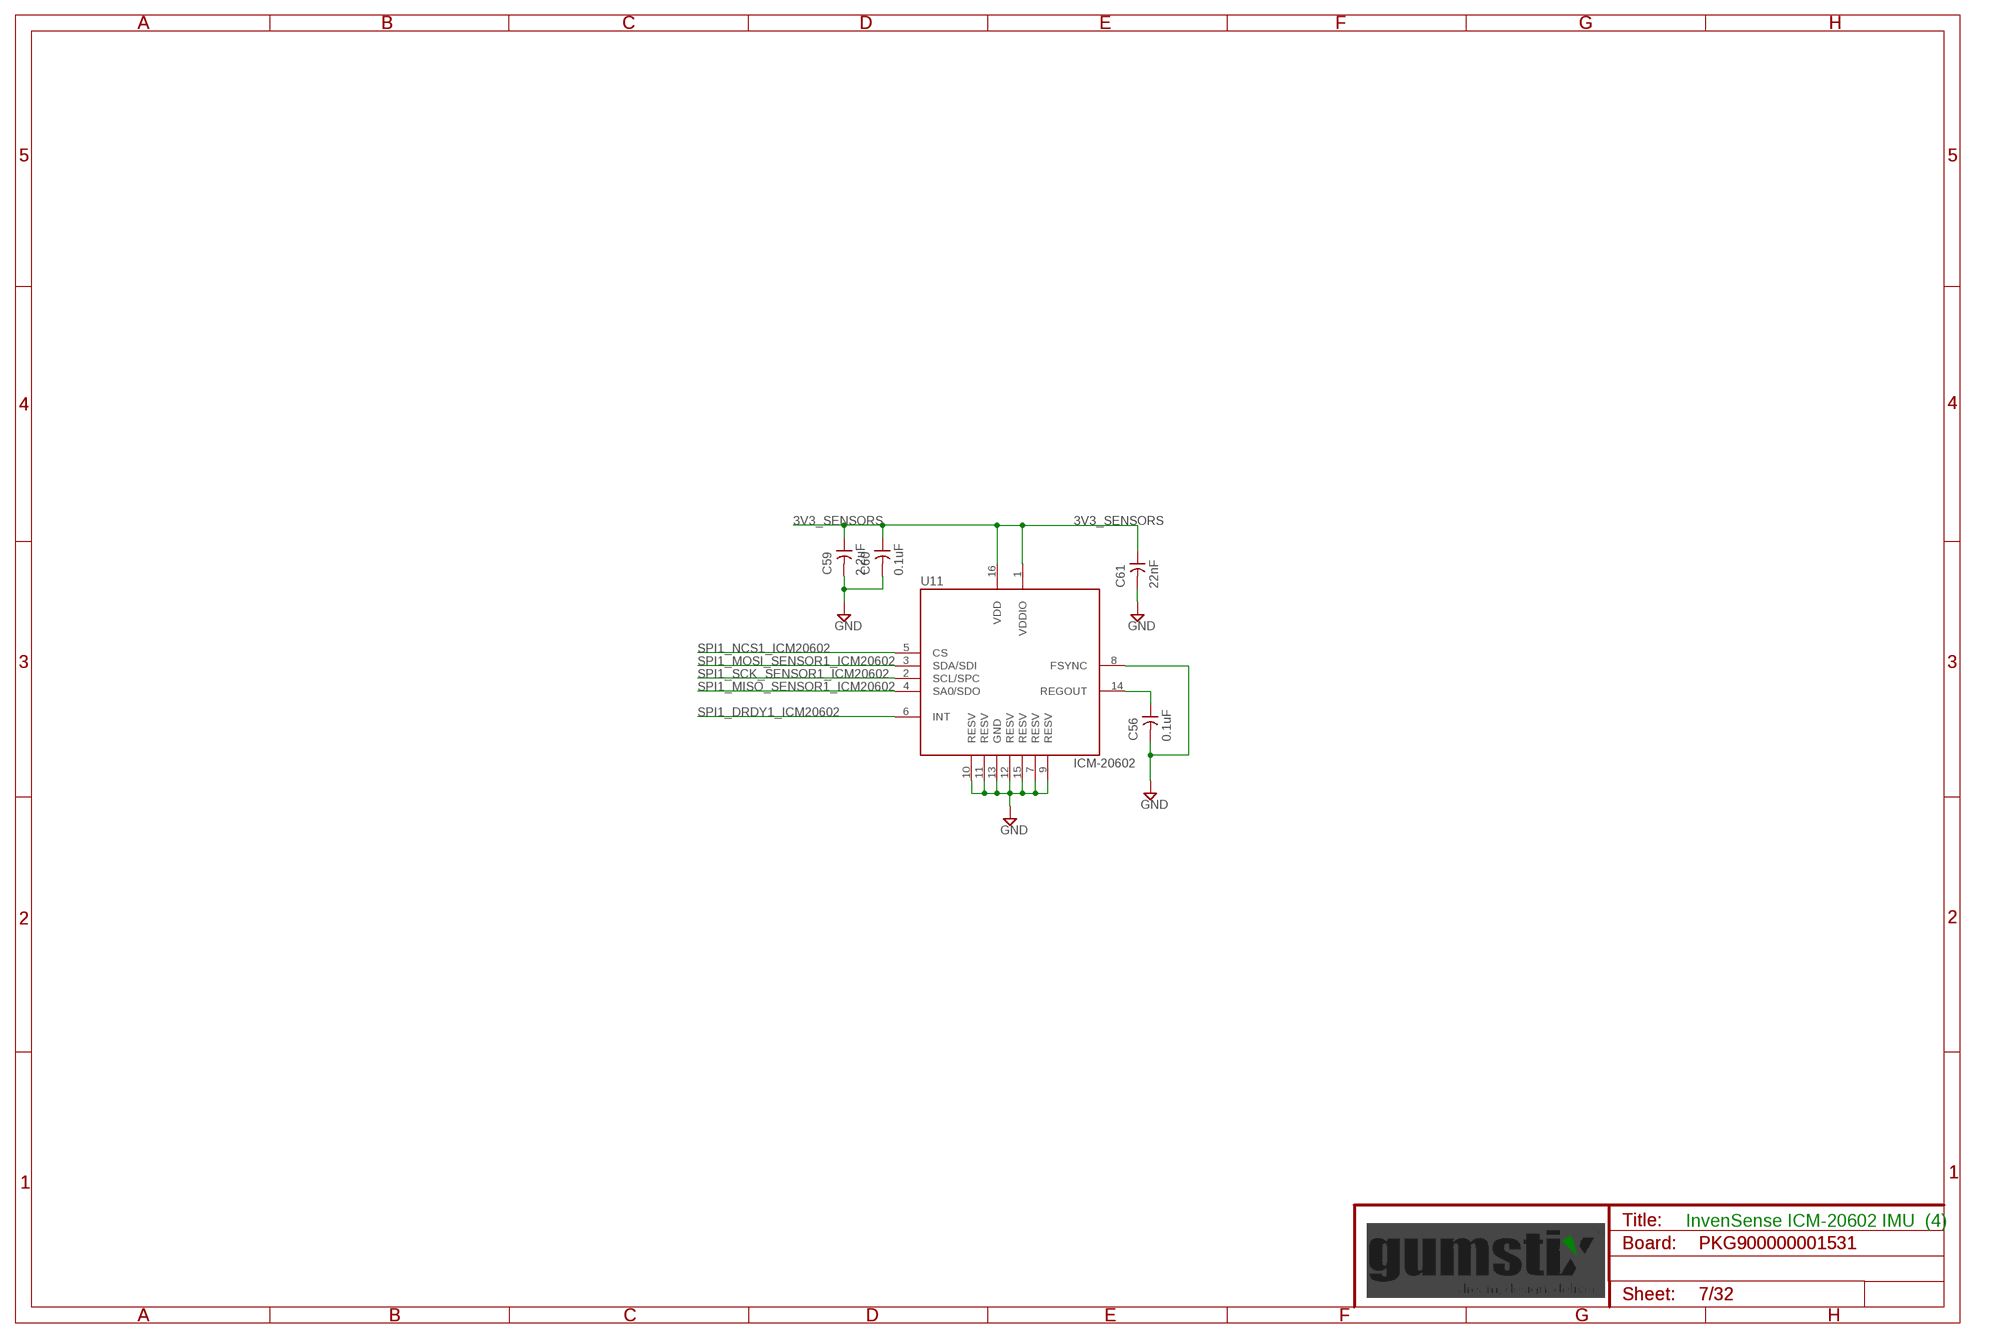
[diagram p6: schematic, sheet 7]

### Parts
C56  0.1uF  C0201  [0201]
C59  2.2uF  C0402  [0402]
C60  0.1uF  C0201  [0201]
C61  22nF  C0201  [0201]
U11  ICM-20602  [LGA16-3X3MM]

### Nets
3V3_SENSORS [supply]: C59.1 C60.1 C61.1 U11.1(VDDIO) U11.16(VDD) ; also sheet 3,6,8,9,10
GND [supply]: C56.2 C59.2 C60.2 C61.2 U11.7(RESV) U11.8(FSYNC) U11.9(RESV) U11.10(RESV) U11.11(RESV) U11.12(RESV) U11.13(GND) U11.15(RESV) ; also sheet 2,3,4,5,6,8,9,10,12,13,14,15,16,17,18,19,20,21,22,23,24,25,26,27,28,29,30,31,32
REGOUT$1: C56.1 U11.14(REGOUT)
SPI1_DRDY1_ICM20602: U11.6(INT) ; also sheet 2
SPI1_MISO_SENSOR1_ICM20602: U11.4(SA0/SDO) ; also sheet 2
SPI1_MOSI_SENSOR1_ICM20602: U11.3(SDA/SDI) ; also sheet 2
SPI1_NCS1_ICM20602: U11.5(CS) ; also sheet 2
SPI1_SCK_SENSOR1_ICM20602: U11.2(SCL/SPC) ; also sheet 2

### Notes on the sheet
- InvenSense ICM-20602 IMU  (4)

## Sheet 8 of 32
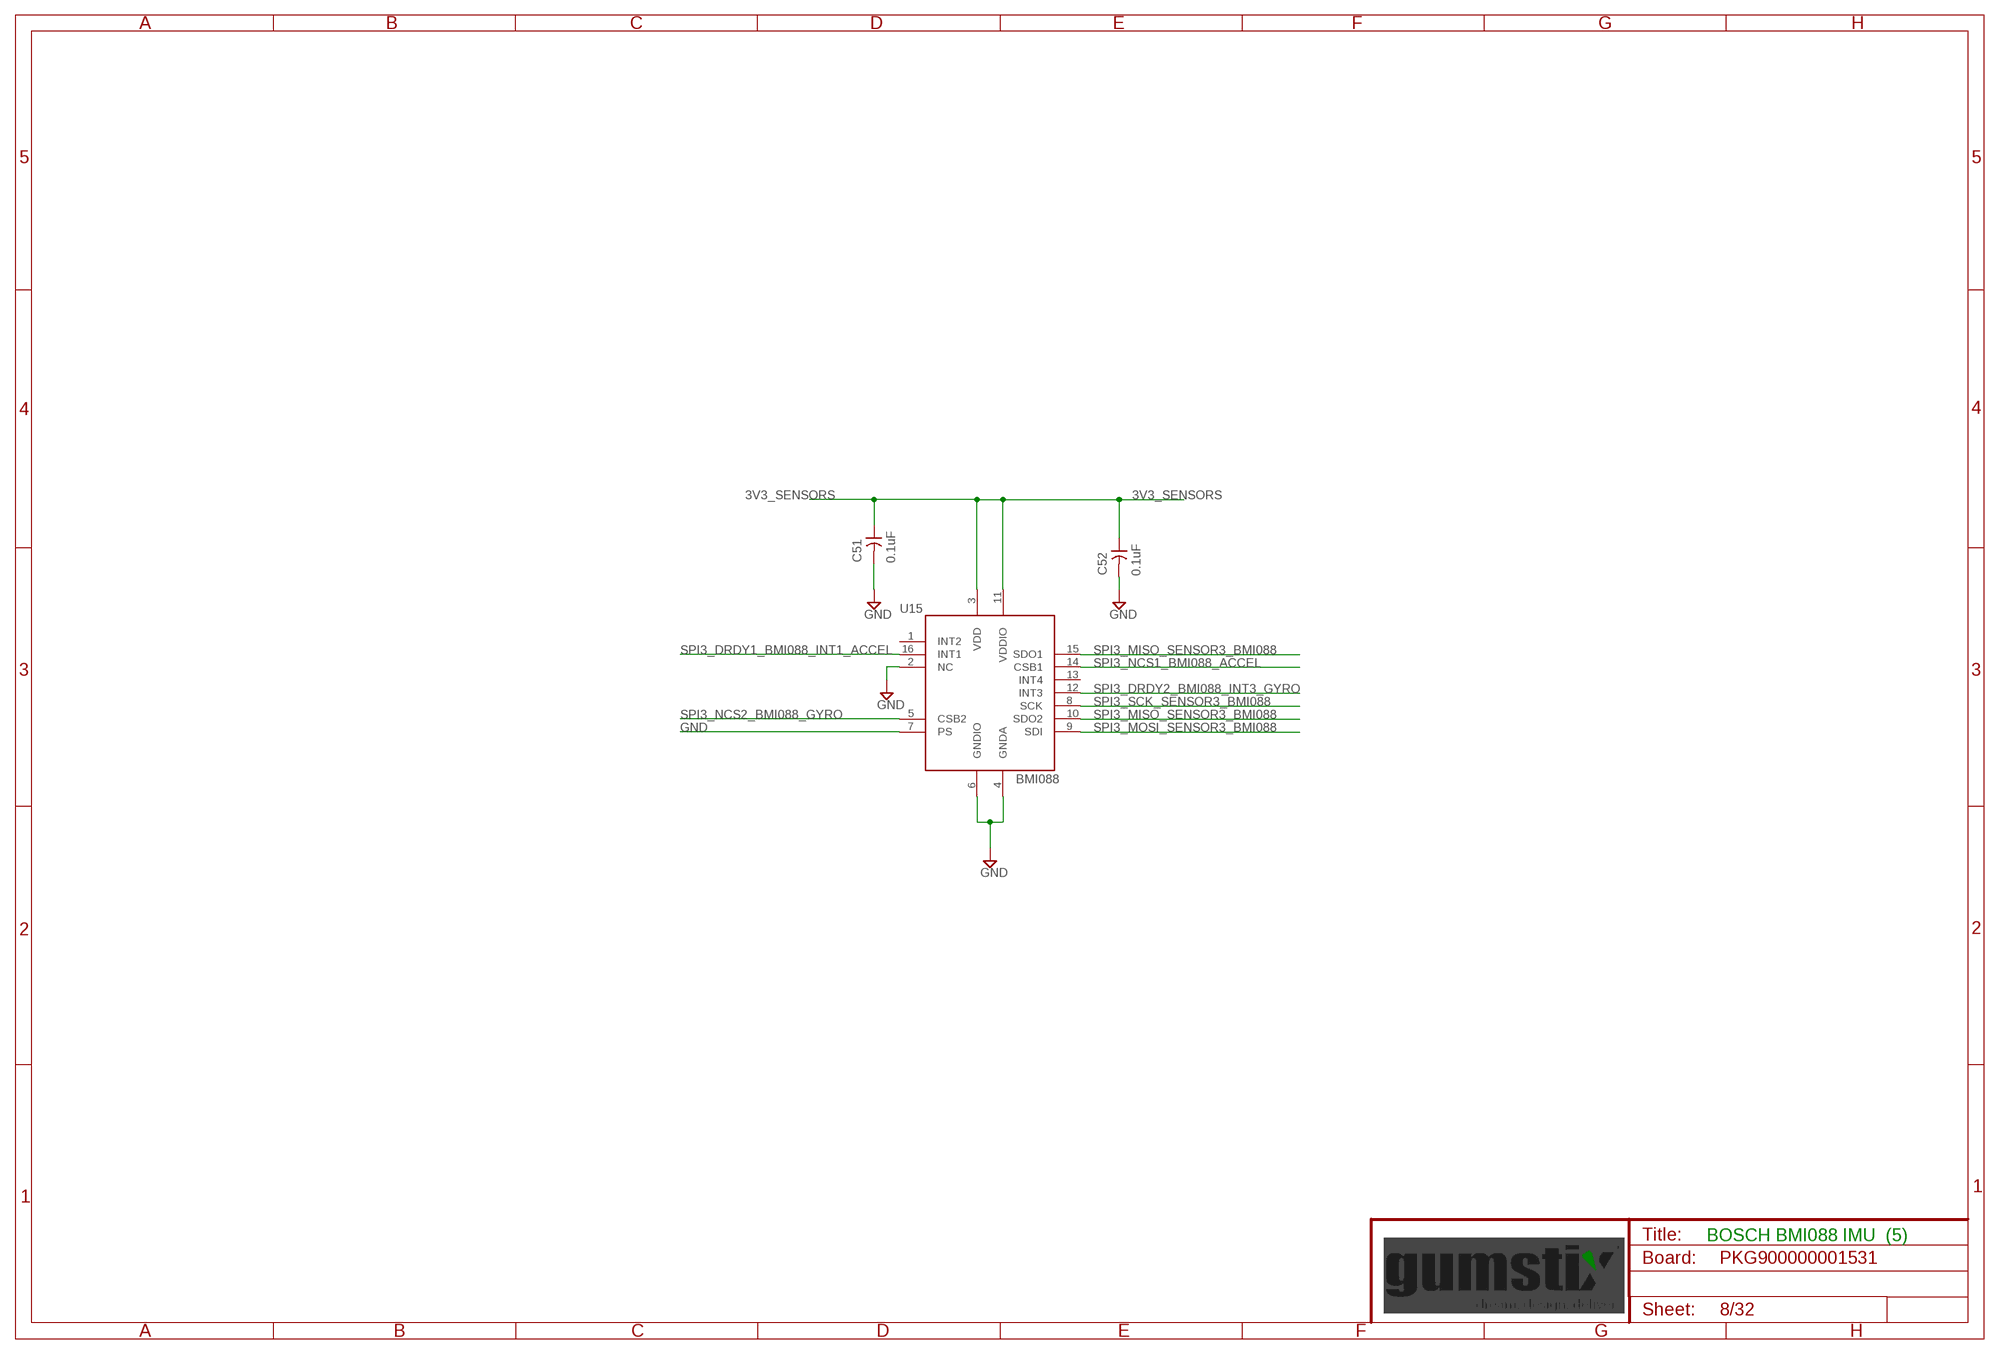
[diagram p7: schematic, sheet 8]

### Parts
C51  0.1uF  C0201  [0201]
C52  0.1uF  C0201  [0201]
U15  BMI088  [LGA16-BMI088]

### Nets
3V3_SENSORS [supply]: C51.1 C52.1 U15.3(VDD) U15.11(VDDIO) ; also sheet 3,6,7,9,10
GND [supply]: C51.2 C52.2 U15.2(NC) U15.4(GNDA) U15.6(GNDIO) U15.7(PS) ; also sheet 2,3,4,5,6,7,9,10,12,13,14,15,16,17,18,19,20,21,22,23,24,25,26,27,28,29,30,31,32
SPI3_DRDY1_BMI088_INT1_ACCEL: U15.16(INT1) ; also sheet 2
SPI3_DRDY2_BMI088_INT3_GYRO: U15.12(INT3) ; also sheet 2
SPI3_MISO_SENSOR3_BMI088: U15.10(SDO2) U15.15(SDO1) ; also sheet 2
SPI3_MOSI_SENSOR3_BMI088: U15.9(SDI) ; also sheet 2
SPI3_NCS1_BMI088_ACCEL: U15.14(CSB1) ; also sheet 2
SPI3_NCS2_BMI088_GYRO: U15.5(CSB2) ; also sheet 2
SPI3_SCK_SENSOR3_BMI088: U15.8(SCK) ; also sheet 2
Unconnected: U15.1(INT2) U15.13(INT4)

### Notes on the sheet
- BOSCH BMI088 IMU  (5)

## Sheet 9 of 32
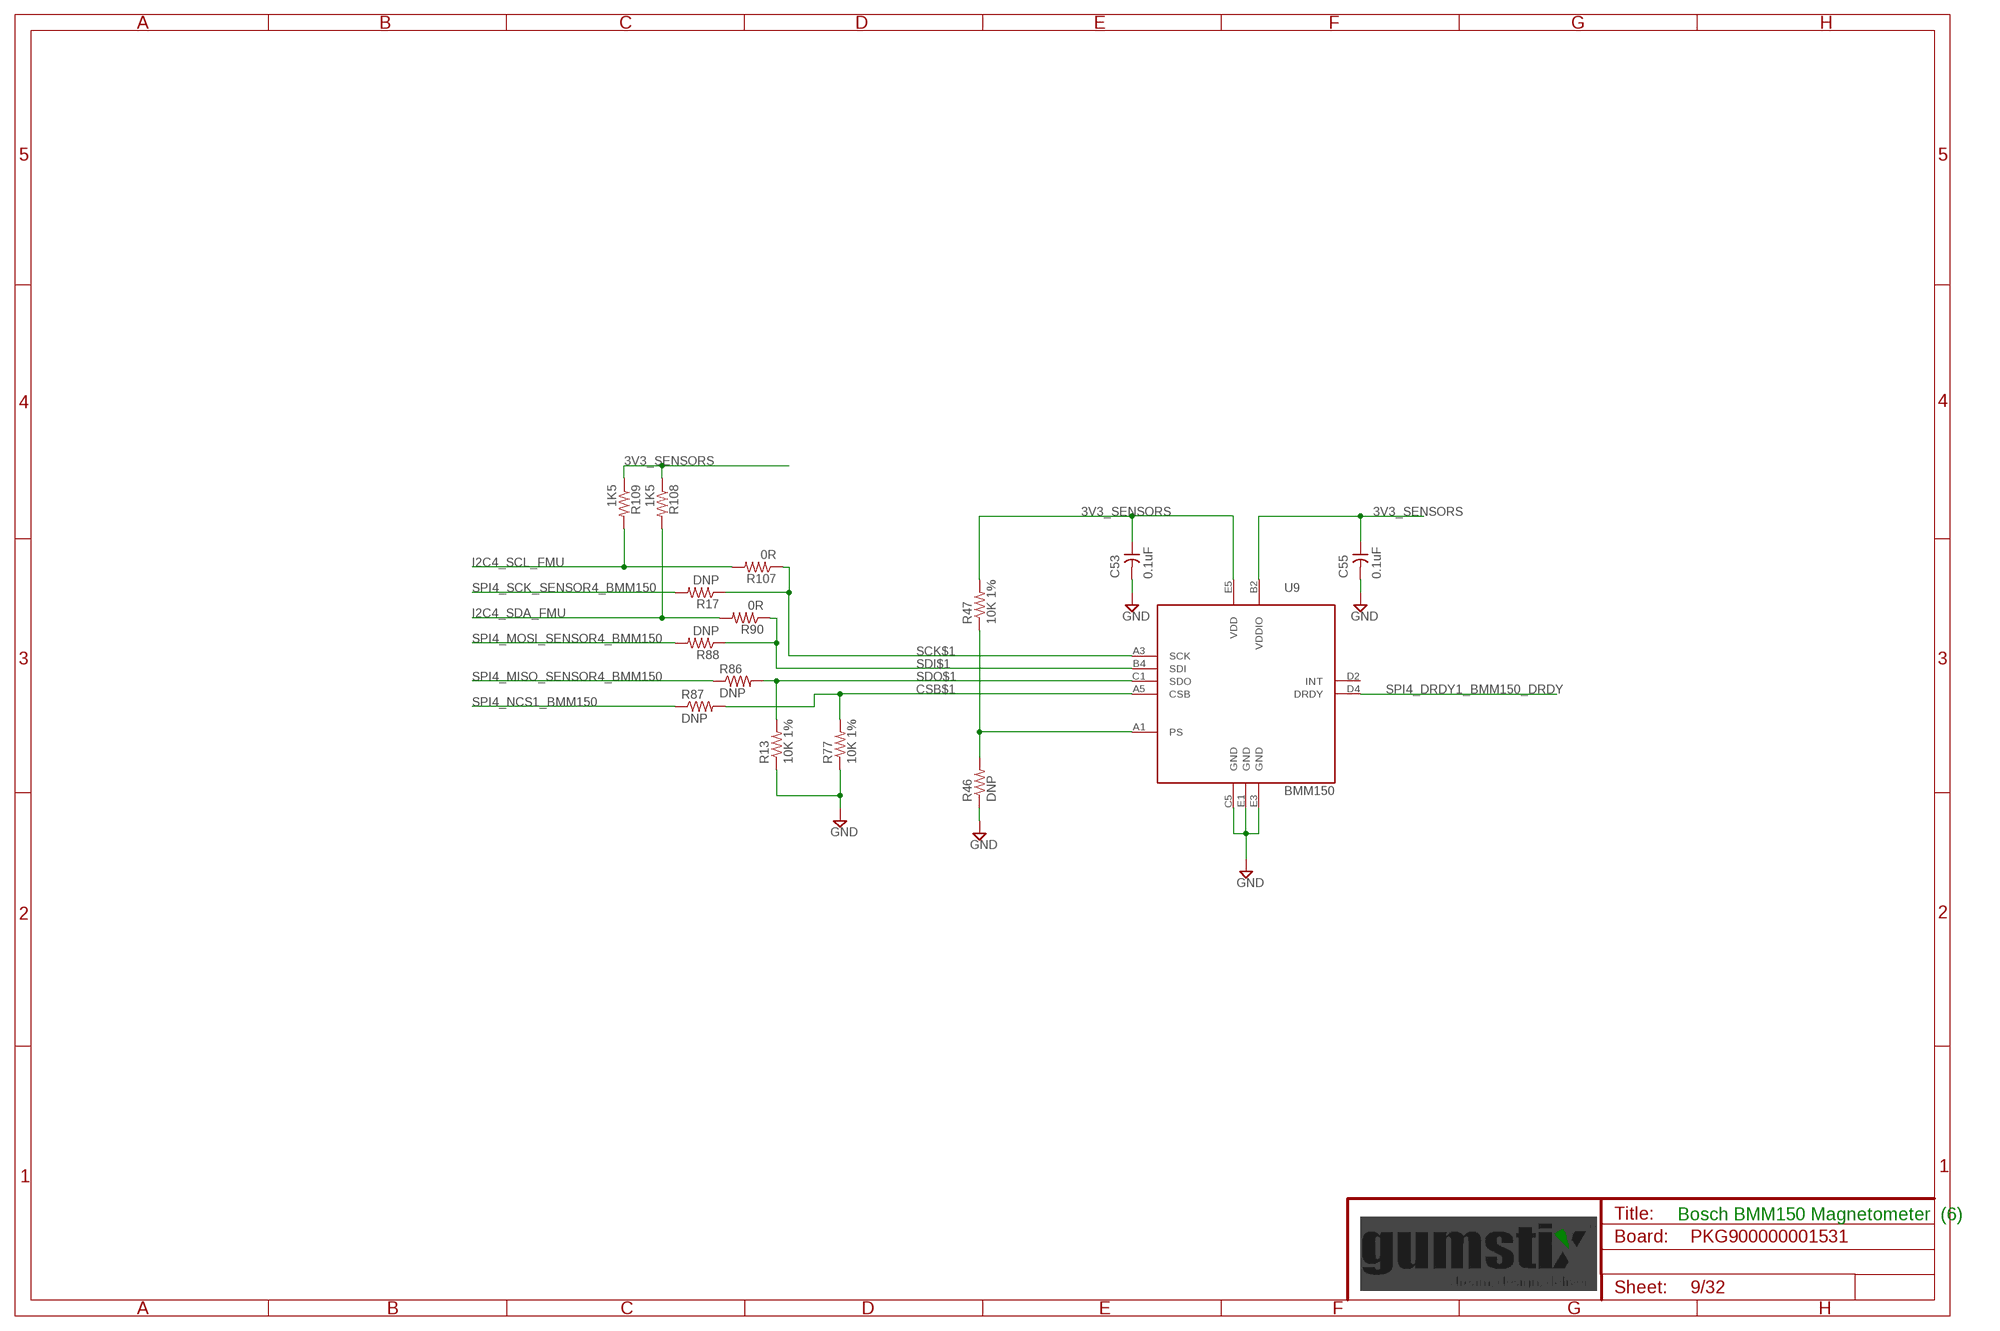
[diagram p8: schematic, sheet 9]

### Parts
C53  0.1uF  C0201  [0201]
C55  0.1uF  C0201  [0201]
R13  10K 1%  R0201  [0201]
R17  DNP  R0201  [0201]
R46  DNP  R0201  [0201]
R47  10K 1%  R0201  [0201]
R77  10K 1%  R0201  [0201]
R86  DNP  R0201  [0201]
R87  DNP  R0201  [0201]
R88  DNP  R0201  [0201]
R90  0R  R0201  [0201]
R107  0R  R0201  [0201]
R108  1K5  R0201  [0201]
R109  1K5  R0201  [0201]
U9  BMM150  [WLCSP-12]

### Nets
3V3_SENSORS [supply]: C53.1 C55.1 R47.2 R108.1 R109.1 U9.B2(VDDIO) U9.E5(VDD) ; also sheet 3,6,7,8,10
BMM150_PS: R46.2 R47.1 U9.A1(PS)
CSB$1: R77.2 R87.2 U9.A5(CSB)
GND [supply]: C53.2 C55.2 R13.1 R46.1 R77.1 U9.C5(GND) U9.E1(GND) U9.E3(GND) ; also sheet 2,3,4,5,6,7,8,10,12,13,14,15,16,17,18,19,20,21,22,23,24,25,26,27,28,29,30,31,32
I2C4_SCL_FMU: R107.2 R109.2 ; also sheet 2,10
I2C4_SDA_FMU: R90.2 R108.2 ; also sheet 2,10
SCK$1: R17.1 R107.1 U9.A3(SCK)
SDI$1: R88.1 R90.1 U9.B4(SDI)
SDO$1: R13.2 R86.2 U9.C1(SDO)
SPI4_DRDY1_BMM150_DRDY: U9.D4(DRDY) ; also sheet 2
SPI4_MISO_SENSOR4_BMM150: R86.1 ; also sheet 2
SPI4_MOSI_SENSOR4_BMM150: R88.2 ; also sheet 2
SPI4_NCS1_BMM150: R87.1 ; also sheet 2
SPI4_SCK_SENSOR4_BMM150: R17.2 ; also sheet 2
Unconnected: U9.D2(INT)

### Notes on the sheet
- Bosch BMM150 Magnetometer  (6)

## Sheet 10 of 32
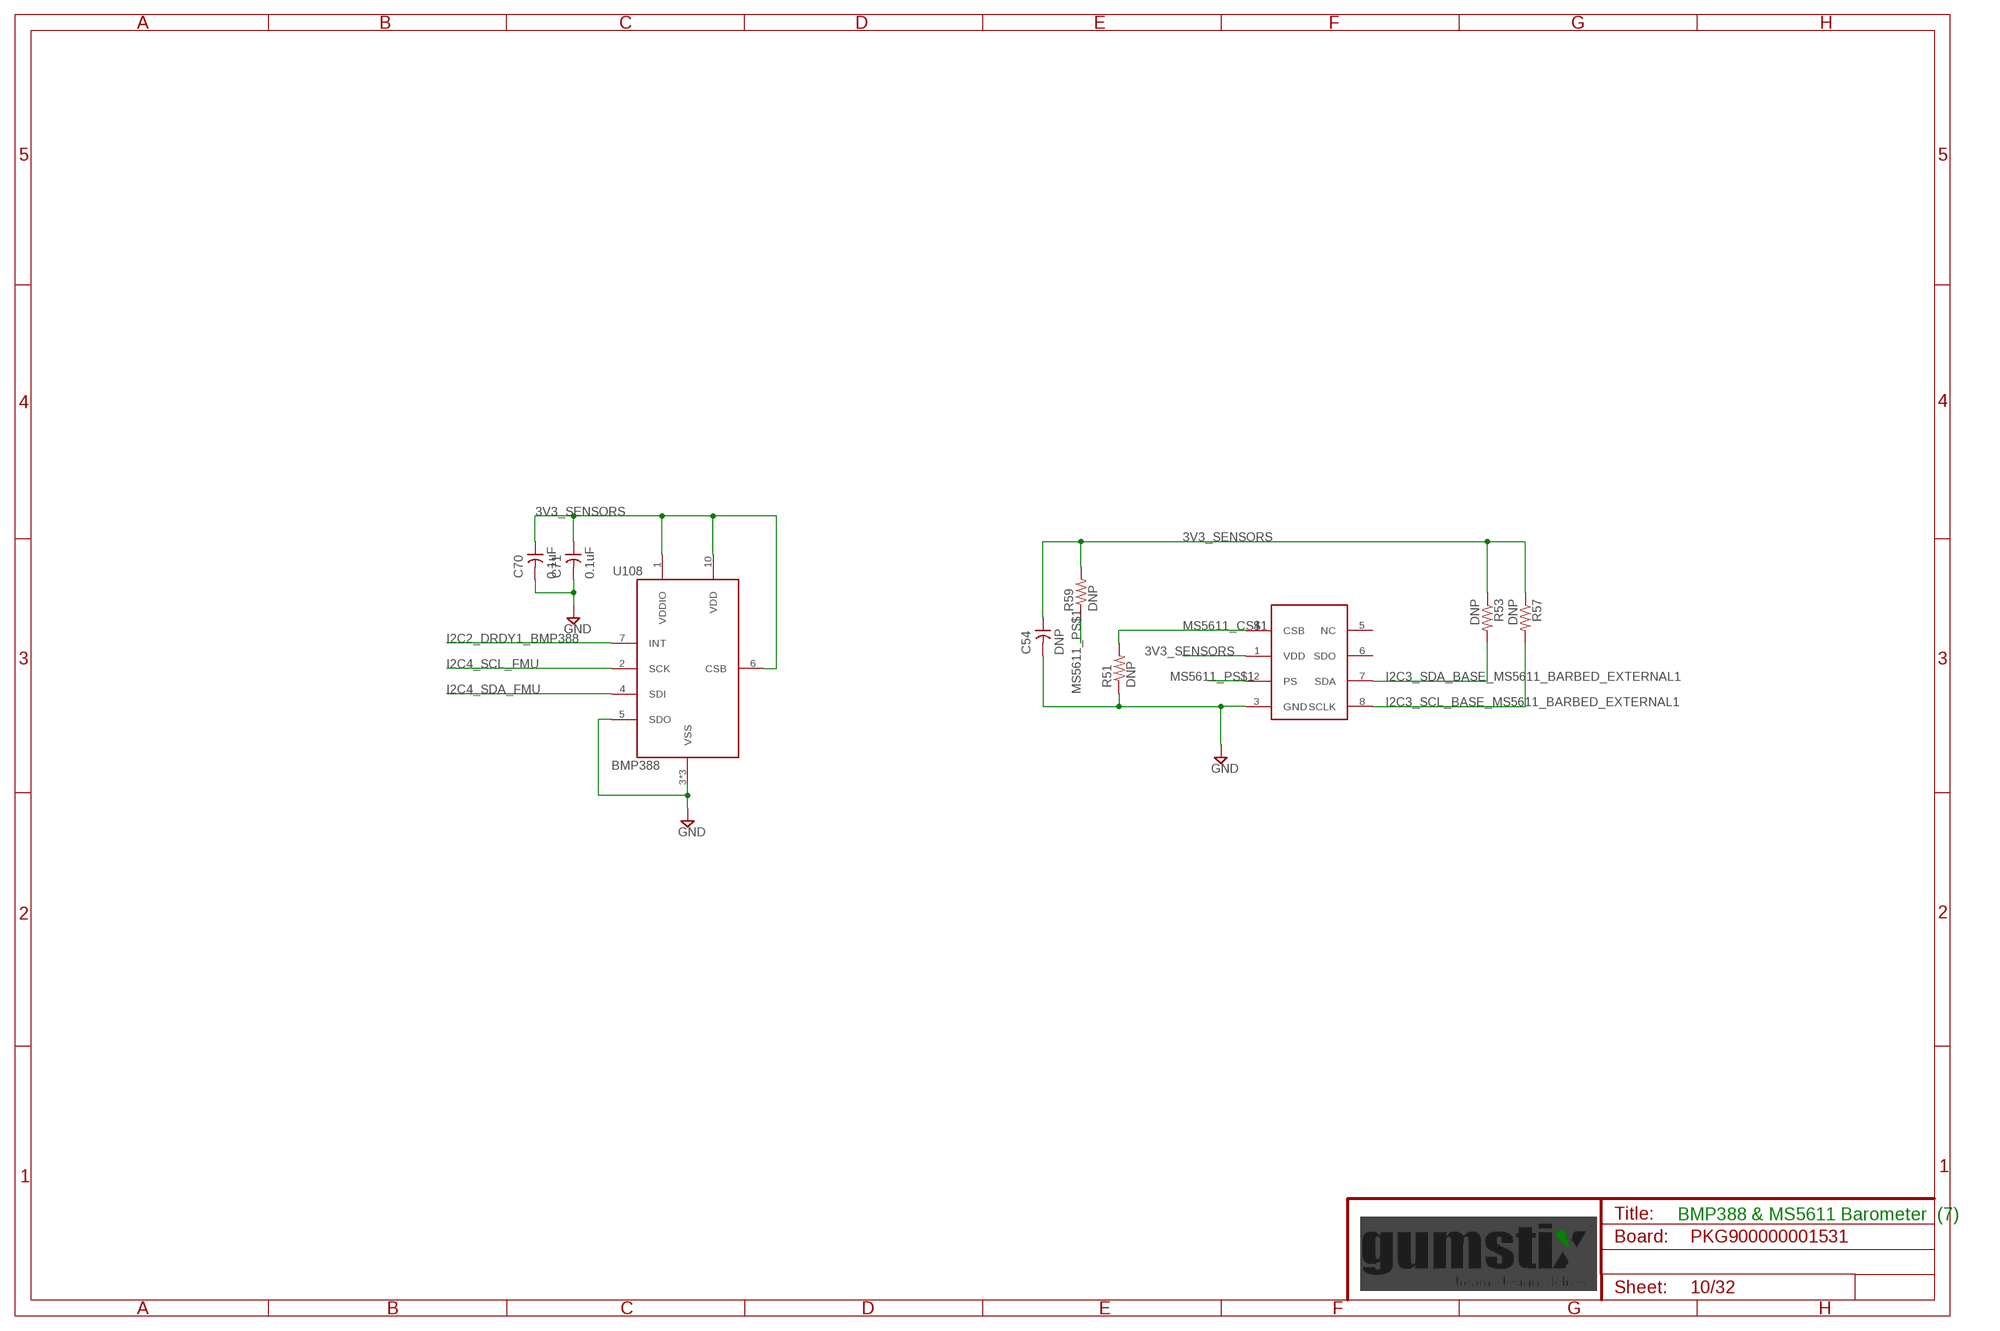
[diagram p9: schematic, sheet 10]

### Parts
C54  DNP  C0201  [0201]
C70  0.1uF  C0201  [0201]
C71  0.1uF  C0201  [0201]
R51  DNP  R0201  [0201]
R53  DNP  R0201  [0201]
R57  DNP  R0201  [0201]
R59  DNP  R0201  [0201]
U10  DNP  MS5611-01  [BA03]
U108  BMP388  [LGA10]

### Nets
3V3_SENSORS [supply]: C54.1 C70.1 C71.1 R53.1 R57.1 R59.2 U10.1(VDD) U108.1(VDDIO) U108.6(CSB) U108.10(VDD) ; also sheet 3,6,7,8,9
GND [supply]: C54.2 C70.2 C71.2 R51.1 U10.3(GND) U108.3(VSS) U108.5(SDO) U108.8(VSS) U108.9(VSS) ; also sheet 2,3,4,5,6,7,8,9,12,13,14,15,16,17,18,19,20,21,22,23,24,25,26,27,28,29,30,31,32
I2C2_DRDY1_BMP388: U108.7(INT) ; also sheet 2
I2C3_SCL_BASE_MS5611_BARBED_EXTERNAL1: R57.2 U10.8(SCLK) ; also sheet 2
I2C3_SDA_BASE_MS5611_BARBED_EXTERNAL1: R53.2 U10.7(SDA) ; also sheet 2
I2C4_SCL_FMU: U108.2(SCK) ; also sheet 2,9
I2C4_SDA_FMU: U108.4(SDI) ; also sheet 2,9
MS5611_CS$1: R51.2 U10.4(CSB)
MS5611_PS$1: R59.1 U10.2(PS)
Unconnected: U10.5(NC) U10.6(SDO)

### Notes on the sheet
- BMP388 & MS5611 Barometer  (7)

## Sheet 11 of 32
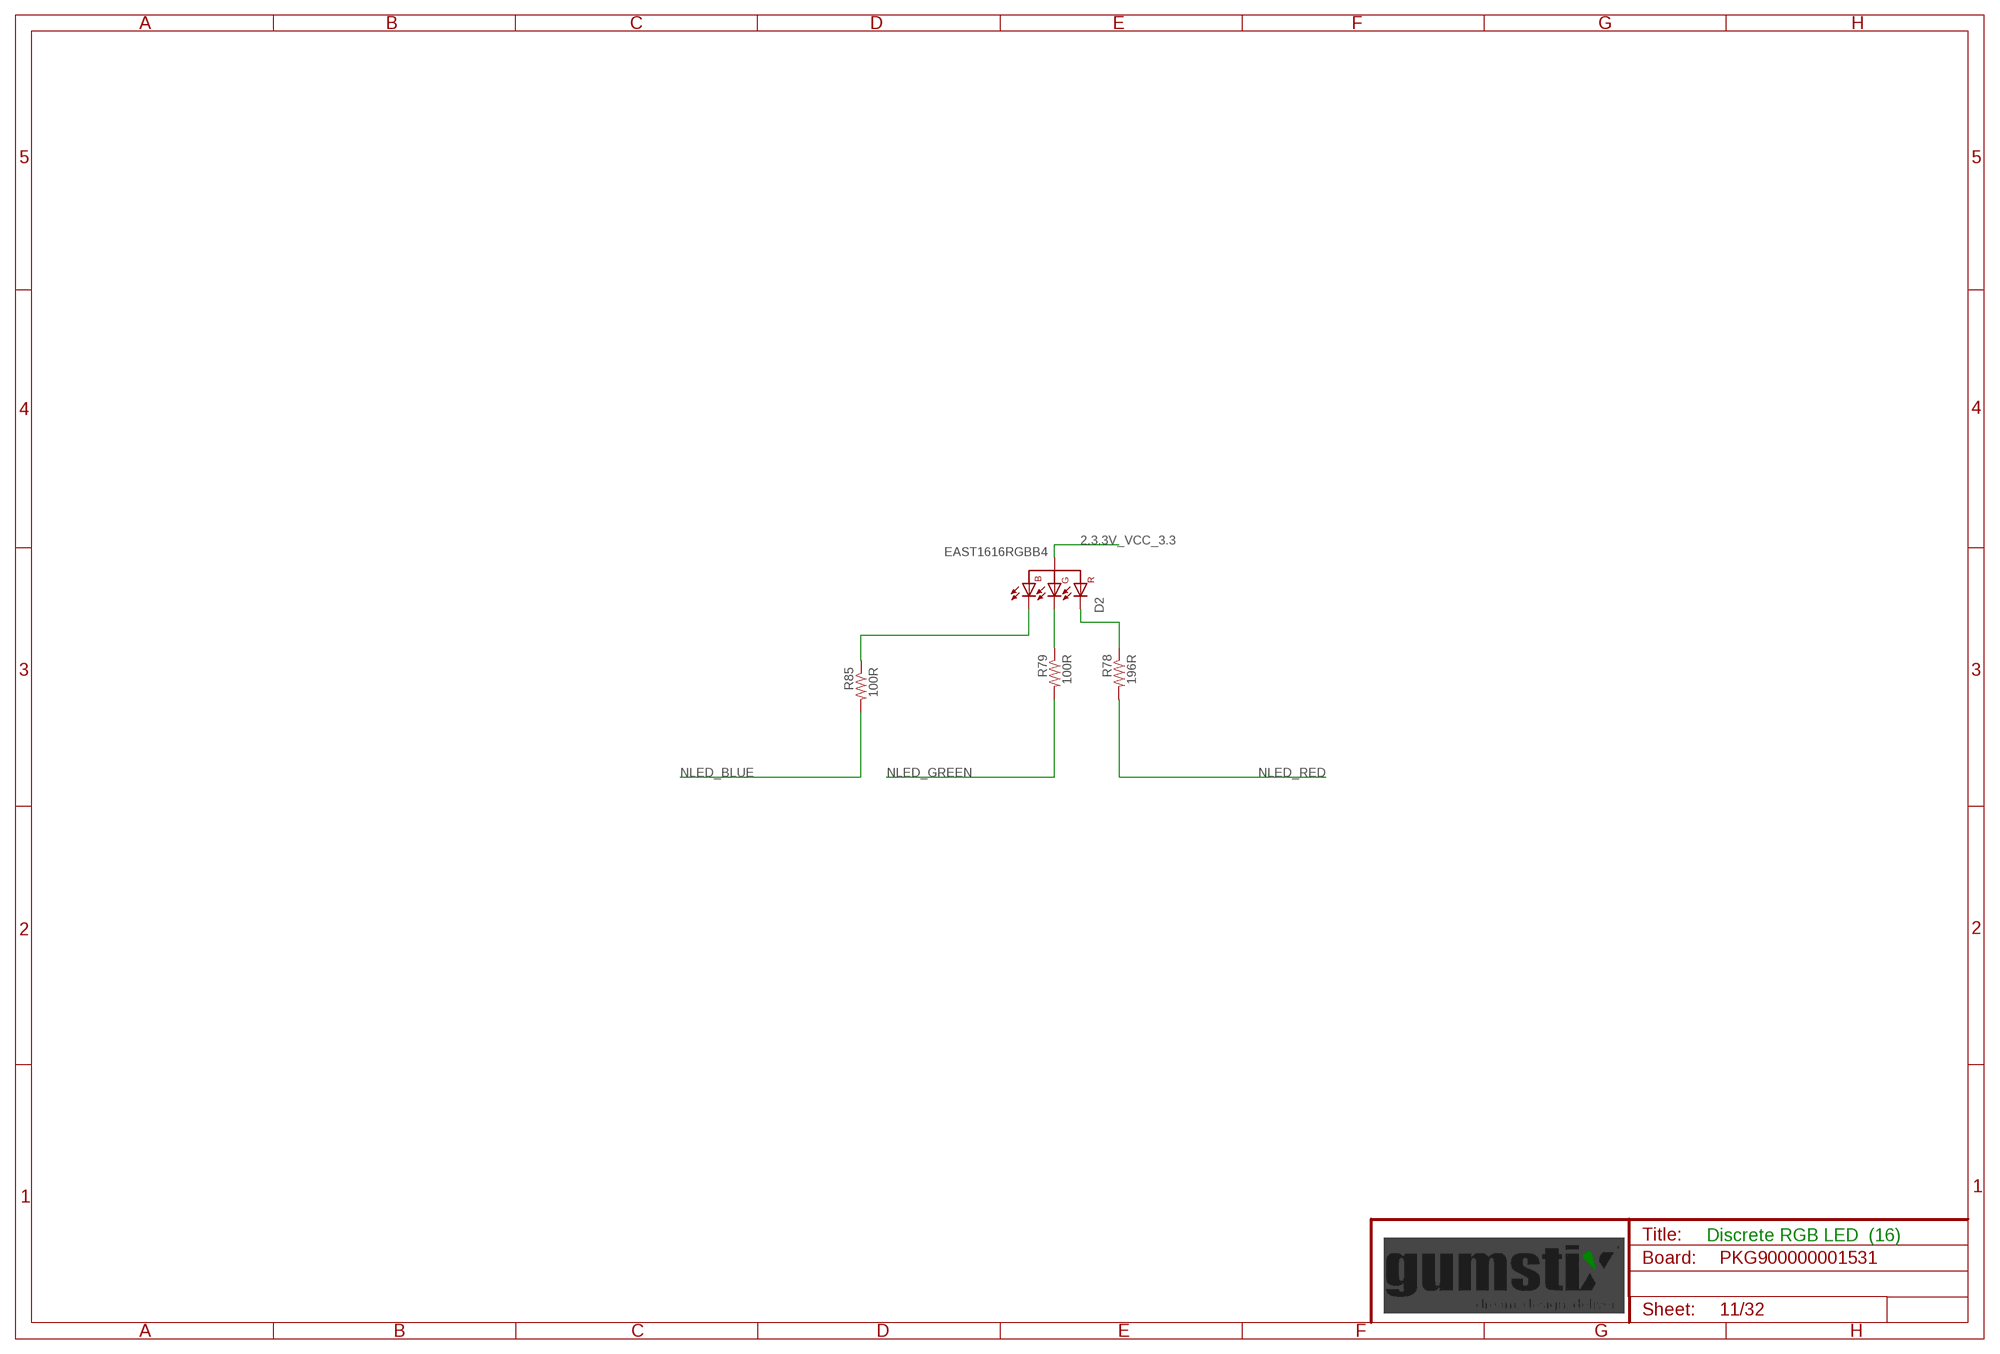
[diagram p10: schematic, sheet 11]

### Parts
D2  EAST1616RGBB4  [SMD4]
R78  196R  R0201  [0201]
R79  100R  R0201  [0201]
R85  100R  R0201  [0201]

### Nets
2.3.3V_VCC_3.3 [supply]: D2.4(VCC) ; also sheet 2,3,4,5,12,14,15,19,20,21,22,29,30,32
C_BLUE$1: D2.3(B) R85.1
C_GREEN$1: D2.2(G) R79.1
C_RED$1: D2.1(R) R78.1
NLED_BLUE: R85.2 ; also sheet 2
NLED_GREEN: R79.2 ; also sheet 2
NLED_RED: R78.2 ; also sheet 2

### Notes on the sheet
- Discrete RGB LED  (16)

## Sheet 12 of 32
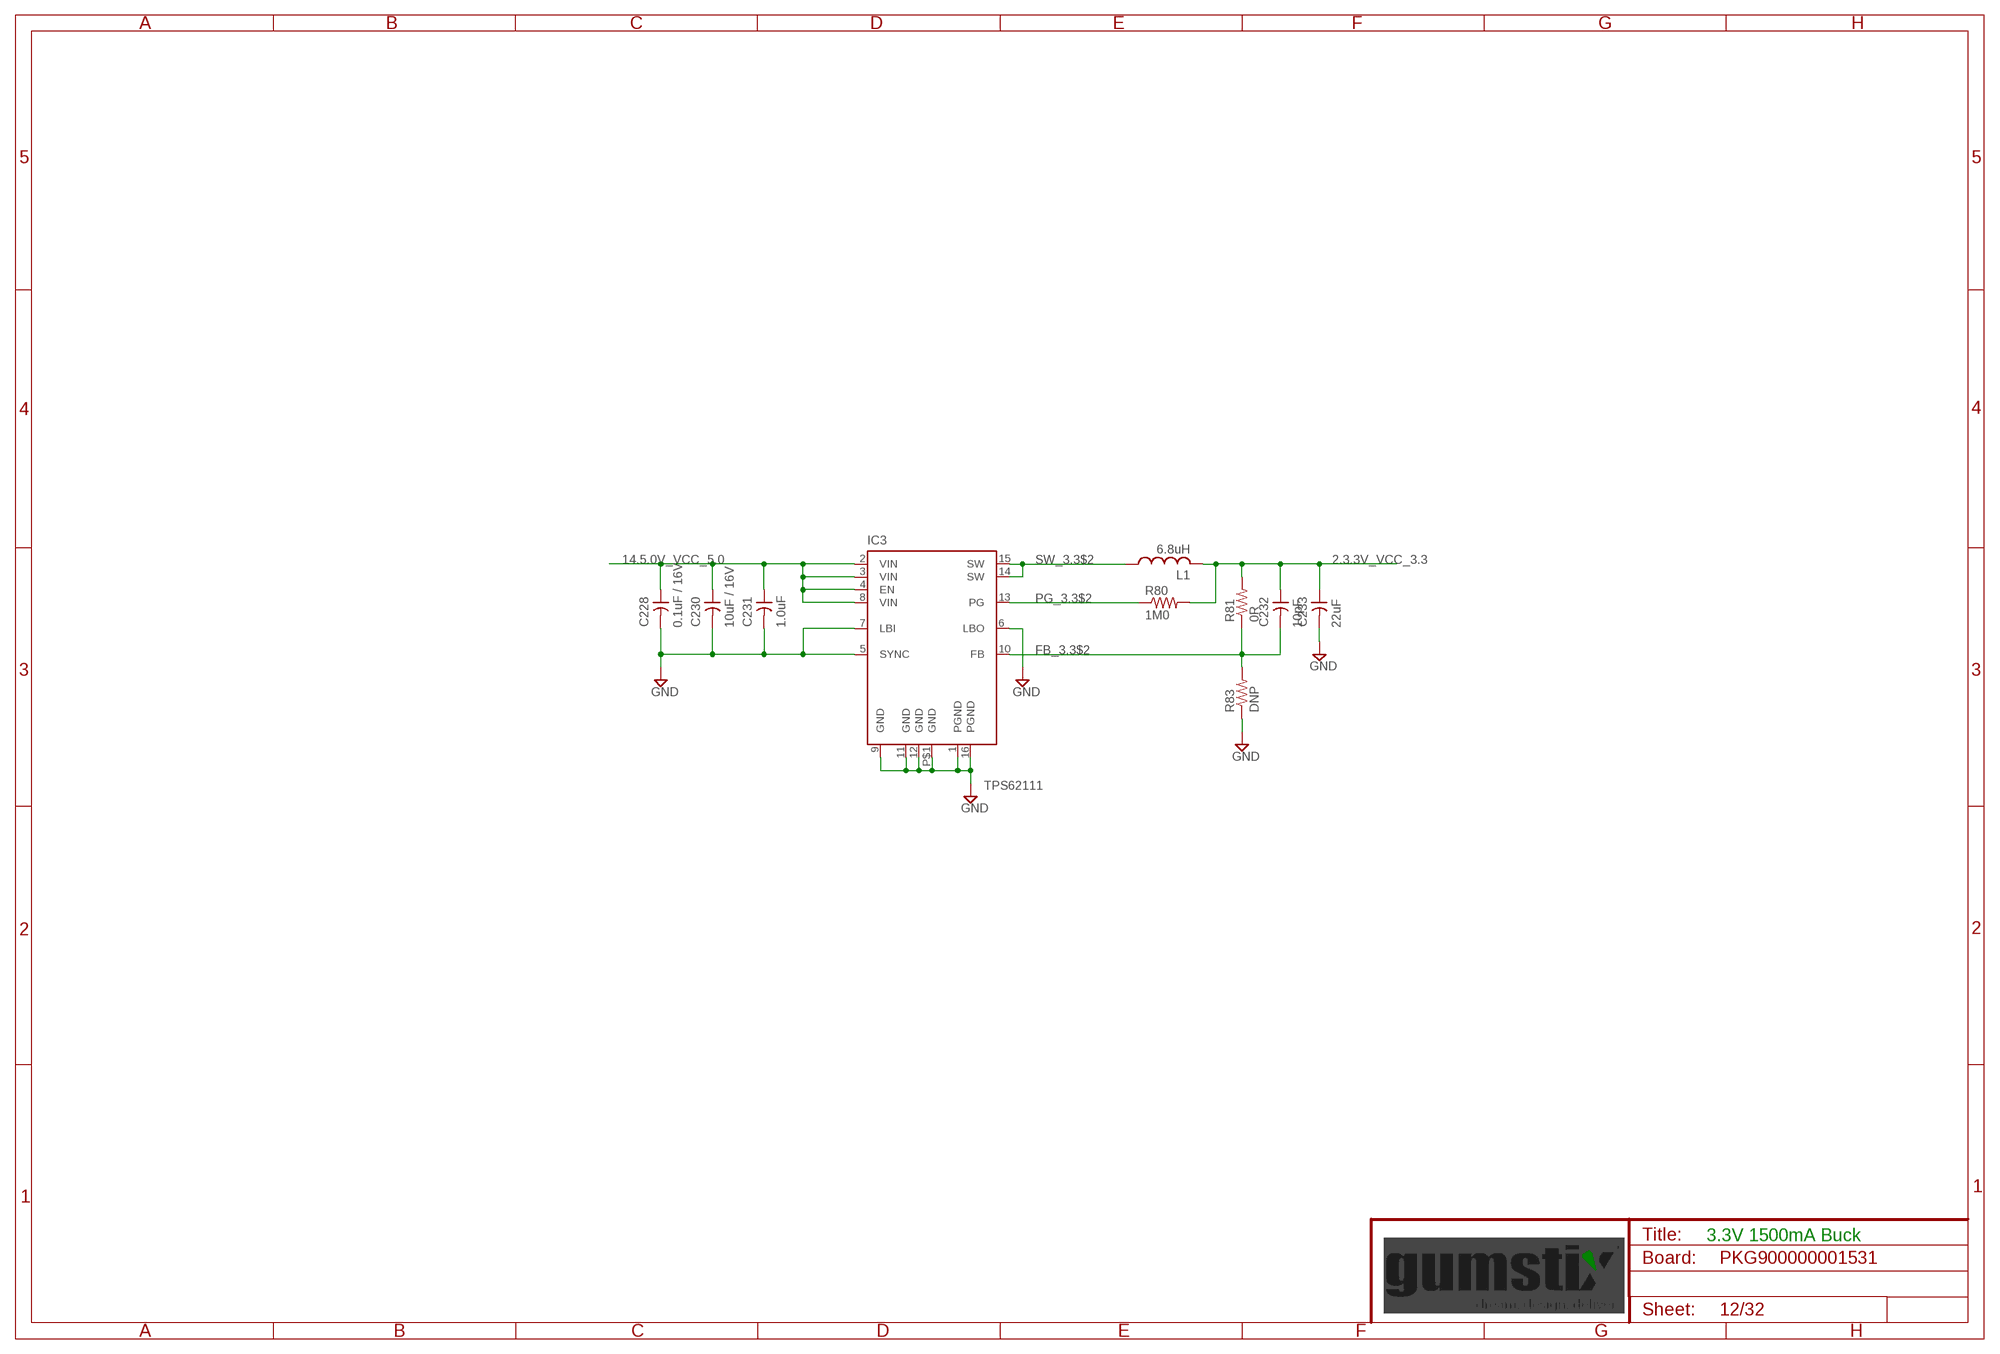
[diagram p11: schematic, sheet 12]

### Parts
C228  0.1uF / 16V  C0402  [0402]
C230  10uF / 16V  C0805  [0805]
C231  1.0uF  C0402  [0402]
C232  10pF  C0201  [0201]
C233  22uF  C0805  [0805]
IC3  TPS62111  [PQFP16]
L1  6.8uH  L1515  [1515]
R80  1M0  R0201  [0201]
R81  0R  R0402  [0402]
R83  DNP  R0402  [0402]

### Nets
2.3.3V_VCC_3.3 [supply]: C232.1 C233.1 L1.2 R80.2 R81.2 ; also sheet 2,3,4,5,11,14,15,19,20,21,22,29,30,32
14.5.0V_VCC_5.0 [supply]: C228.1 C230.1 C231.1 IC3.2(VIN) IC3.3(VIN) IC3.4(EN) IC3.8(VIN) ; also sheet 3,17,25
FB_3.3$2 [supply]: C232.2 IC3.10(FB) R81.1 R83.2
GND [supply]: C228.2 C230.2 C231.2 C233.2 IC3.1(PGND) IC3.5(SYNC) IC3.6(LBO) IC3.7(LBI) IC3.9(GND) IC3.11(GND) IC3.12(GND) IC3.16(PGND) IC3.P$1(GND) R83.1 ; also sheet 2,3,4,5,6,7,8,9,10,13,14,15,16,17,18,19,20,21,22,23,24,25,26,27,28,29,30,31,32
PG_3.3$2: IC3.13(PG) R80.1
SW_3.3$2 [supply]: IC3.14(SW) IC3.15(SW) L1.1

### Notes on the sheet
- 3.3V 1500mA Buck

## Sheet 13 of 32
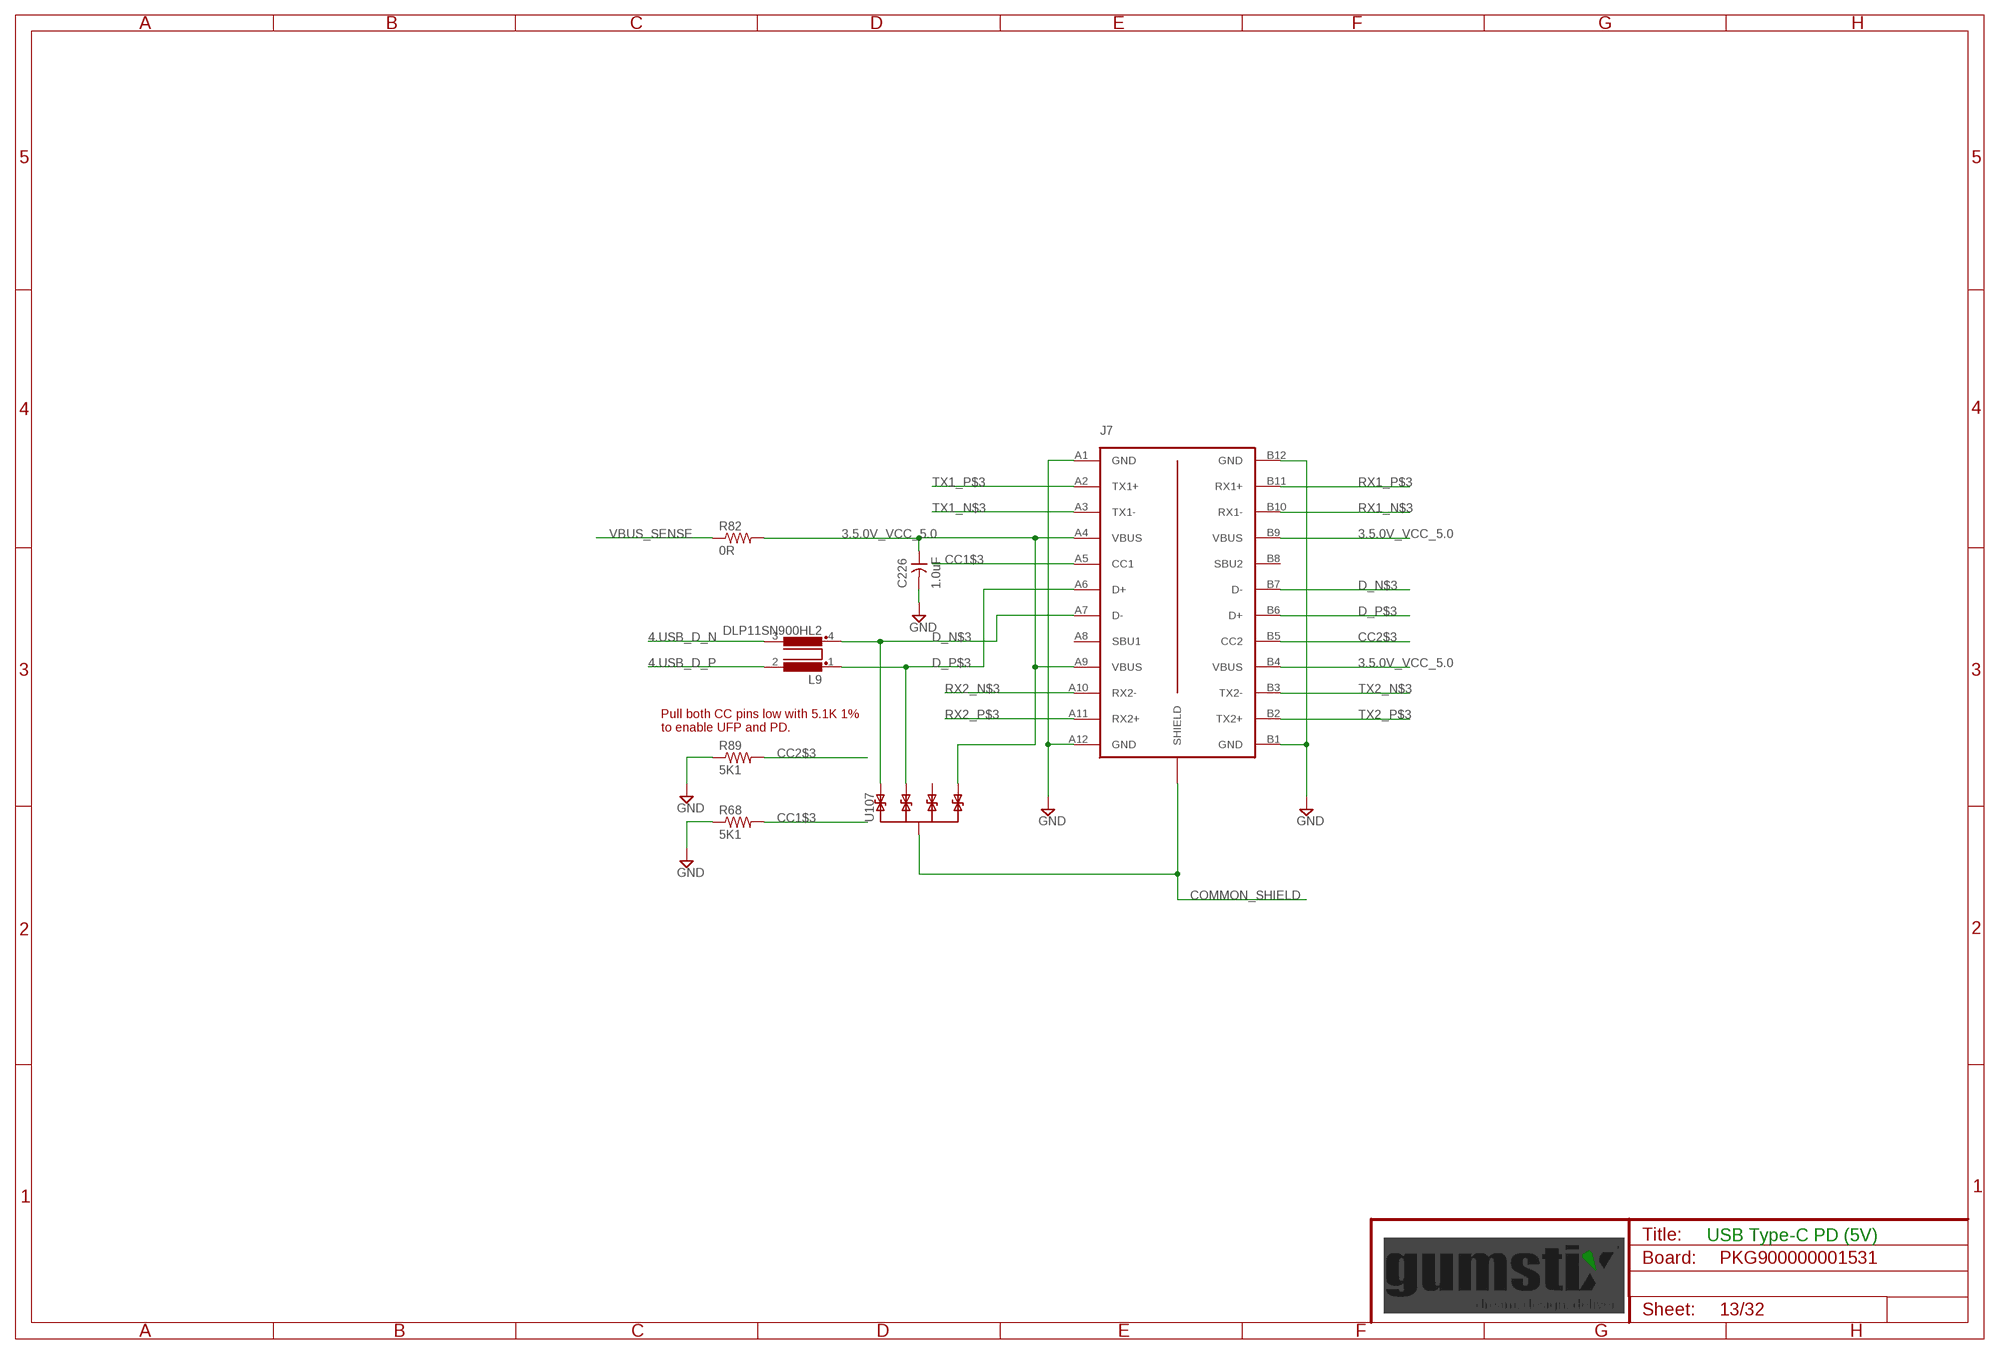
[diagram p12: schematic, sheet 13]

### Parts
C226  1.0uF  C0402  [0402]
J7  USB-TYPE-C  [USB-TYPE-C-SMT]
L9  DLP11SN900HL2  COM_MODE_CHOKE  [0504-DLP11S]
R68  5K1  R0201  [0201]
R82  0R  R0201  [0201]
R89  5K1  R0201  [0201]
U107  TPD4E02B0410-USON  [UFDFN-10]

### Nets
3.5.0V_VCC_5.0 [supply]: C226.1 J7.A4(VBUS) J7.A9(VBUS) J7.B4(VBUS) J7.B9(VBUS) R82.2 U107.5(P4) U107.6(P4) ; also sheet 25
4.USB_D_N [USB]: L9.3 ; also sheet 14
4.USB_D_P [USB]: L9.2 ; also sheet 14
CC1$3: J7.A5(CC1) R68.2
CC2$3: J7.B5(CC2) R89.2
COMMON_SHIELD [supply]: J7.P$1(SHIELD) J7.P$2(SHIELD) J7.P$3(SHIELD) J7.P$4(SHIELD) U107.3(SHIELD) U107.8(SHIELD)
D_N$3 [USB]: J7.A7(D-) J7.B7(D-) L9.4 U107.1 U107.10(P1)
D_P$3 [USB]: J7.A6(D+) J7.B6(D+) L9.1 U107.2 U107.9(P2)
GND [supply]: C226.2 J7.A1(GND) J7.A12(GND) J7.B1(GND) J7.B12(GND) R68.1 R89.1 ; also sheet 2,3,4,5,6,7,8,9,10,12,14,15,16,17,18,19,20,21,22,23,24,25,26,27,28,29,30,31,32
RX1_N$3 [USB]: J7.B10(RX1-)
RX1_P$3 [USB]: J7.B11(RX1+)
RX2_N$3 [USB]: J7.A10(RX2-)
RX2_P$3 [USB]: J7.A11(RX2+)
TX1_N$3 [USB]: J7.A3(TX1-)
TX1_P$3 [USB]: J7.A2(TX1+)
TX2_N$3 [USB]: J7.B3(TX2-)
TX2_P$3 [USB]: J7.B2(TX2+)
VBUS_SENSE [supply]: R82.1 ; also sheet 2,4,15,16
Unconnected: J7.A8(SBU1) J7.B8(SBU2) U107.4(P3) U107.7(P3)

### Notes on the sheet
- Pull both CC pins low with 5.1K 1%
  to enable UFP and PD.
- USB Type-C PD (5V)

## Sheet 14 of 32
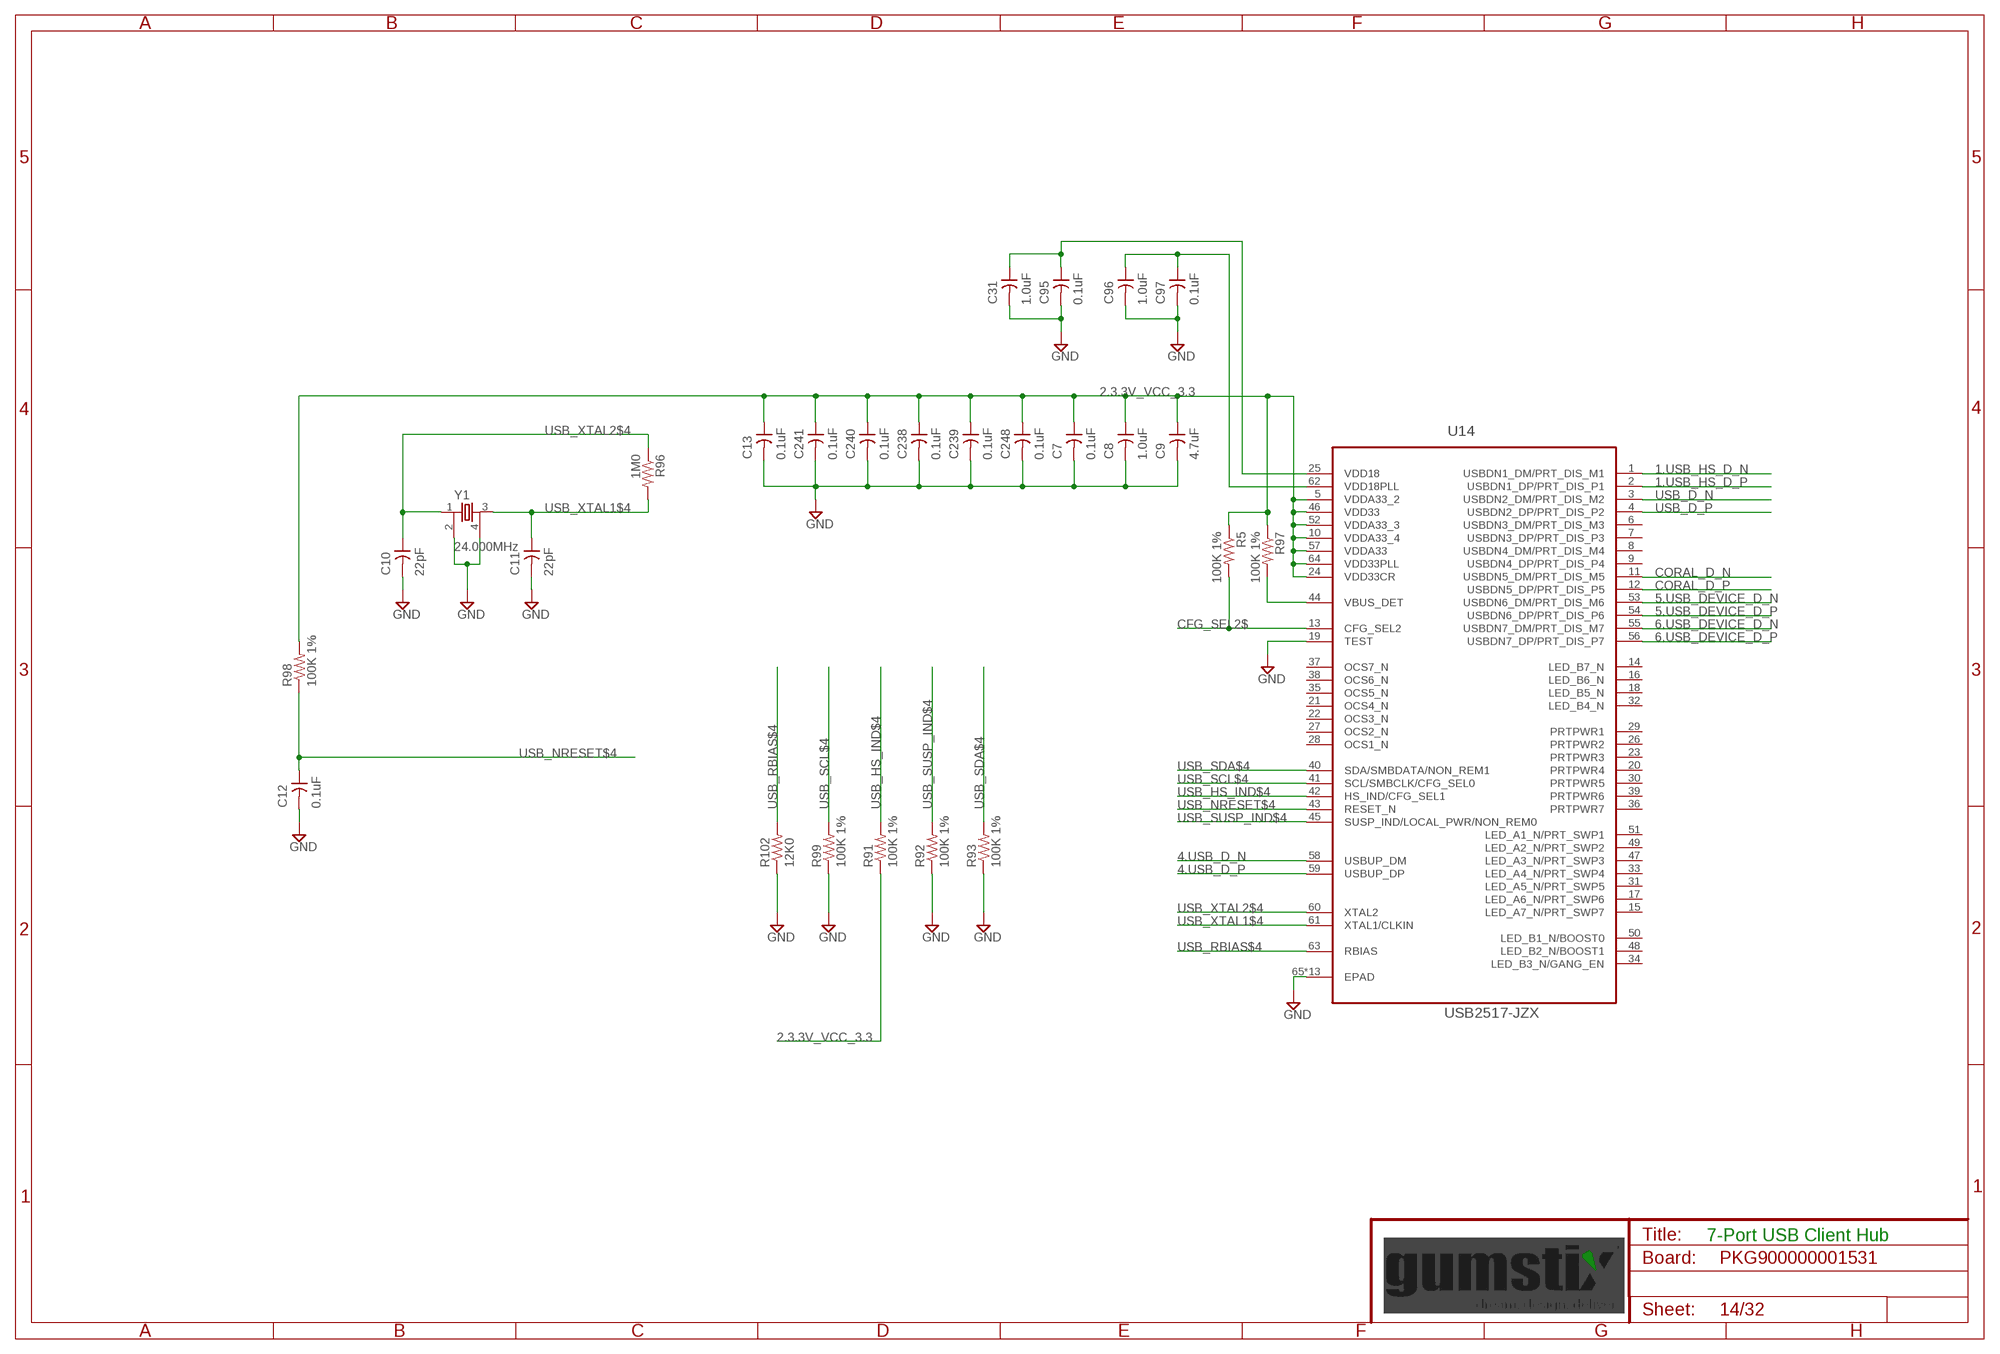
[diagram p13: schematic, sheet 14]

### Parts
C7  0.1uF  C0201  [0201]
C8  1.0uF  C0402  [0402]
C9  4.7uF  C0603  [0603]
C10  22pF  C0201  [0201]
C11  22pF  C0201  [0201]
C12  0.1uF  C0402  [0402]
C13  0.1uF  C0201  [0201]
C31  1.0uF  C0402  [0402]
C95  0.1uF  C0201  [0201]
C96  1.0uF  C0402  [0402]
C97  0.1uF  C0201  [0201]
C238  0.1uF  C0201  [0201]
C239  0.1uF  C0201  [0201]
C240  0.1uF  C0201  [0201]
C241  0.1uF  C0201  [0201]
C248  0.1uF  C0201  [0201]
R5  100K 1%  R0201  [0201]
R91  100K 1%  R0201  [0201]
R92  100K 1%  R0201  [0201]
R93  100K 1%  R0201  [0201]
R96  1M0  R0201  [0201]
R97  100K 1%  R0201  [0201]
R98  100K 1%  R0201  [0201]
R99  100K 1%  R0201  [0201]
R102  12K0  R0201  [0201]
U14  USB2517-JZX  [QFN64-9X9MM-FT2232HQ]
Y1  24.000MHz  Y4CRYSTAL-3225  [CRYSTAL-3225]

### Nets
1.USB_HS_D_N [USB]: U14.1(USBDN1_DM/PRT_DIS_M1) ; also sheet 4
1.USB_HS_D_P [USB]: U14.2(USBDN1_DP/PRT_DIS_P1) ; also sheet 4
2.3.3V_VCC_3.3 [supply]: C7.1 C8.1 C9.1 C13.1 C238.1 C239.1 C240.1 C241.1 C248.1 R5.1 R91.1 R97.1 R98.2 U14.5(VDDA33_2) U14.10(VDDA33_4) U14.24(VDD33CR) U14.46(VDD33) U14.52(VDDA33_3) U14.57(VDDA33) U14.64(VDD33PLL) ; also sheet 2,3,4,5,11,12,15,19,20,21,22,29,30,32
4.USB_D_N [USB]: U14.58(USBUP_DM) ; also sheet 13
4.USB_D_P [USB]: U14.59(USBUP_DP) ; also sheet 13
5.USB_DEVICE_D_N [USB]: U14.53(USBDN6_DM/PRT_DIS_M6) ; also sheet 15
5.USB_DEVICE_D_P [USB]: U14.54(USBDN6_DP/PRT_DIS_P6) ; also sheet 15
6.USB_DEVICE_D_N [USB]: U14.55(USBDN7_DM/PRT_DIS_M7) ; also sheet 16
6.USB_DEVICE_D_P [USB]: U14.56(USBDN7_DP/PRT_DIS_P7) ; also sheet 16
CFG_SEL2$: R5.2 U14.13(CFG_SEL2)
CORAL_D_N [USB]: U14.11(USBDN5_DM/PRT_DIS_M5) ; also sheet 17
CORAL_D_P [USB]: U14.12(USBDN5_DP/PRT_DIS_P5) ; also sheet 17
GND [supply]: C7.2 C8.2 C9.2 C10.2 C11.2 C12.2 C13.2 C31.2 C95.2 C96.2 C97.2 C238.2 C239.2 C240.2 C241.2 C248.2 R92.1 R93.1 R99.1 R102.1 U14.19(TEST) U14.65(EPAD) U14.EPAD1(EPAD) U14.EPAD2(EPAD) U14.EPAD3(EPAD) U14.EPAD4(EPAD) U14.EPAD5(EPAD) U14.EPAD6(EPAD) U14.EPAD7(EPAD) U14.EPAD8(EPAD) U14.EPAD9(EPAD) U14.EPAD10(EPAD) U14.EPAD11(EPAD) U14.EPAD12(EPAD) Y1.2 Y1.4 ; also sheet 2,3,4,5,6,7,8,9,10,12,13,15,16,17,18,19,20,21,22,23,24,25,26,27,28,29,30,31,32
USB_CRFILT$ [supply]: C31.1 C95.1 U14.25(VDD18)
USB_D_N [USB]: U14.3(USBDN2_DM/PRT_DIS_M2) ; also sheet 2
USB_D_P [USB]: U14.4(USBDN2_DP/PRT_DIS_P2) ; also sheet 2
USB_HS_IND$4: R91.2 U14.42(HS_IND/CFG_SEL1)
USB_NRESET$4: C12.1 R98.1 U14.43(RESET_N)
USB_PLLFILT$ [supply]: C96.1 C97.1 U14.62(VDD18PLL)
USB_RBIAS$4: R102.2 U14.63(RBIAS)
USB_SCL$4: R99.2 U14.41(SCL/SMBCLK/CFG_SEL0)
USB_SDA$4: R93.2 U14.40(SDA/SMBDATA/NON_REM1)
USB_SUSP_IND$4: R92.2 U14.45(SUSP_IND/LOCAL_PWR/NON_REM0)
USB_XTAL1$4: C11.1 R96.2 U14.61(XTAL1/CLKIN) Y1.3
USB_XTAL2$4: C10.1 R96.1 U14.60(XTAL2) Y1.1
VBUS_DET$ [USB]: R97.2 U14.44(VBUS_DET)
Unconnected: U14.6(USBDN3_DM/PRT_DIS_M3) U14.7(USBDN3_DP/PRT_DIS_P3) U14.8(USBDN4_DM/PRT_DIS_M4) U14.9(USBDN4_DP/PRT_DIS_P4) U14.14(LED_B7_N) U14.15(LED_A7_N/PRT_SWP7) U14.16(LED_B6_N) U14.17(LED_A6_N/PRT_SWP6) U14.18(LED_B5_N) U14.20(PRTPWR4) U14.21(OCS4_N) U14.22(OCS3_N) U14.23(PRTPWR3) U14.26(PRTPWR2) U14.27(OCS2_N) U14.28(OCS1_N) U14.29(PRTPWR1) U14.30(PRTPWR5) U14.31(LED_A5_N/PRT_SWP5) U14.32(LED_B4_N) U14.33(LED_A4_N/PRT_SWP4) U14.34(LED_B3_N/GANG_EN) U14.35(OCS5_N) U14.36(PRTPWR7) U14.37(OCS7_N) U14.38(OCS6_N) U14.39(PRTPWR6) U14.47(LED_A3_N/PRT_SWP3) U14.48(LED_B2_N/BOOST1) U14.49(LED_A2_N/PRT_SWP2) U14.50(LED_B1_N/BOOST0) U14.51(LED_A1_N/PRT_SWP1)

### Notes on the sheet
- 7-Port USB Client Hub

## Sheet 15 of 32
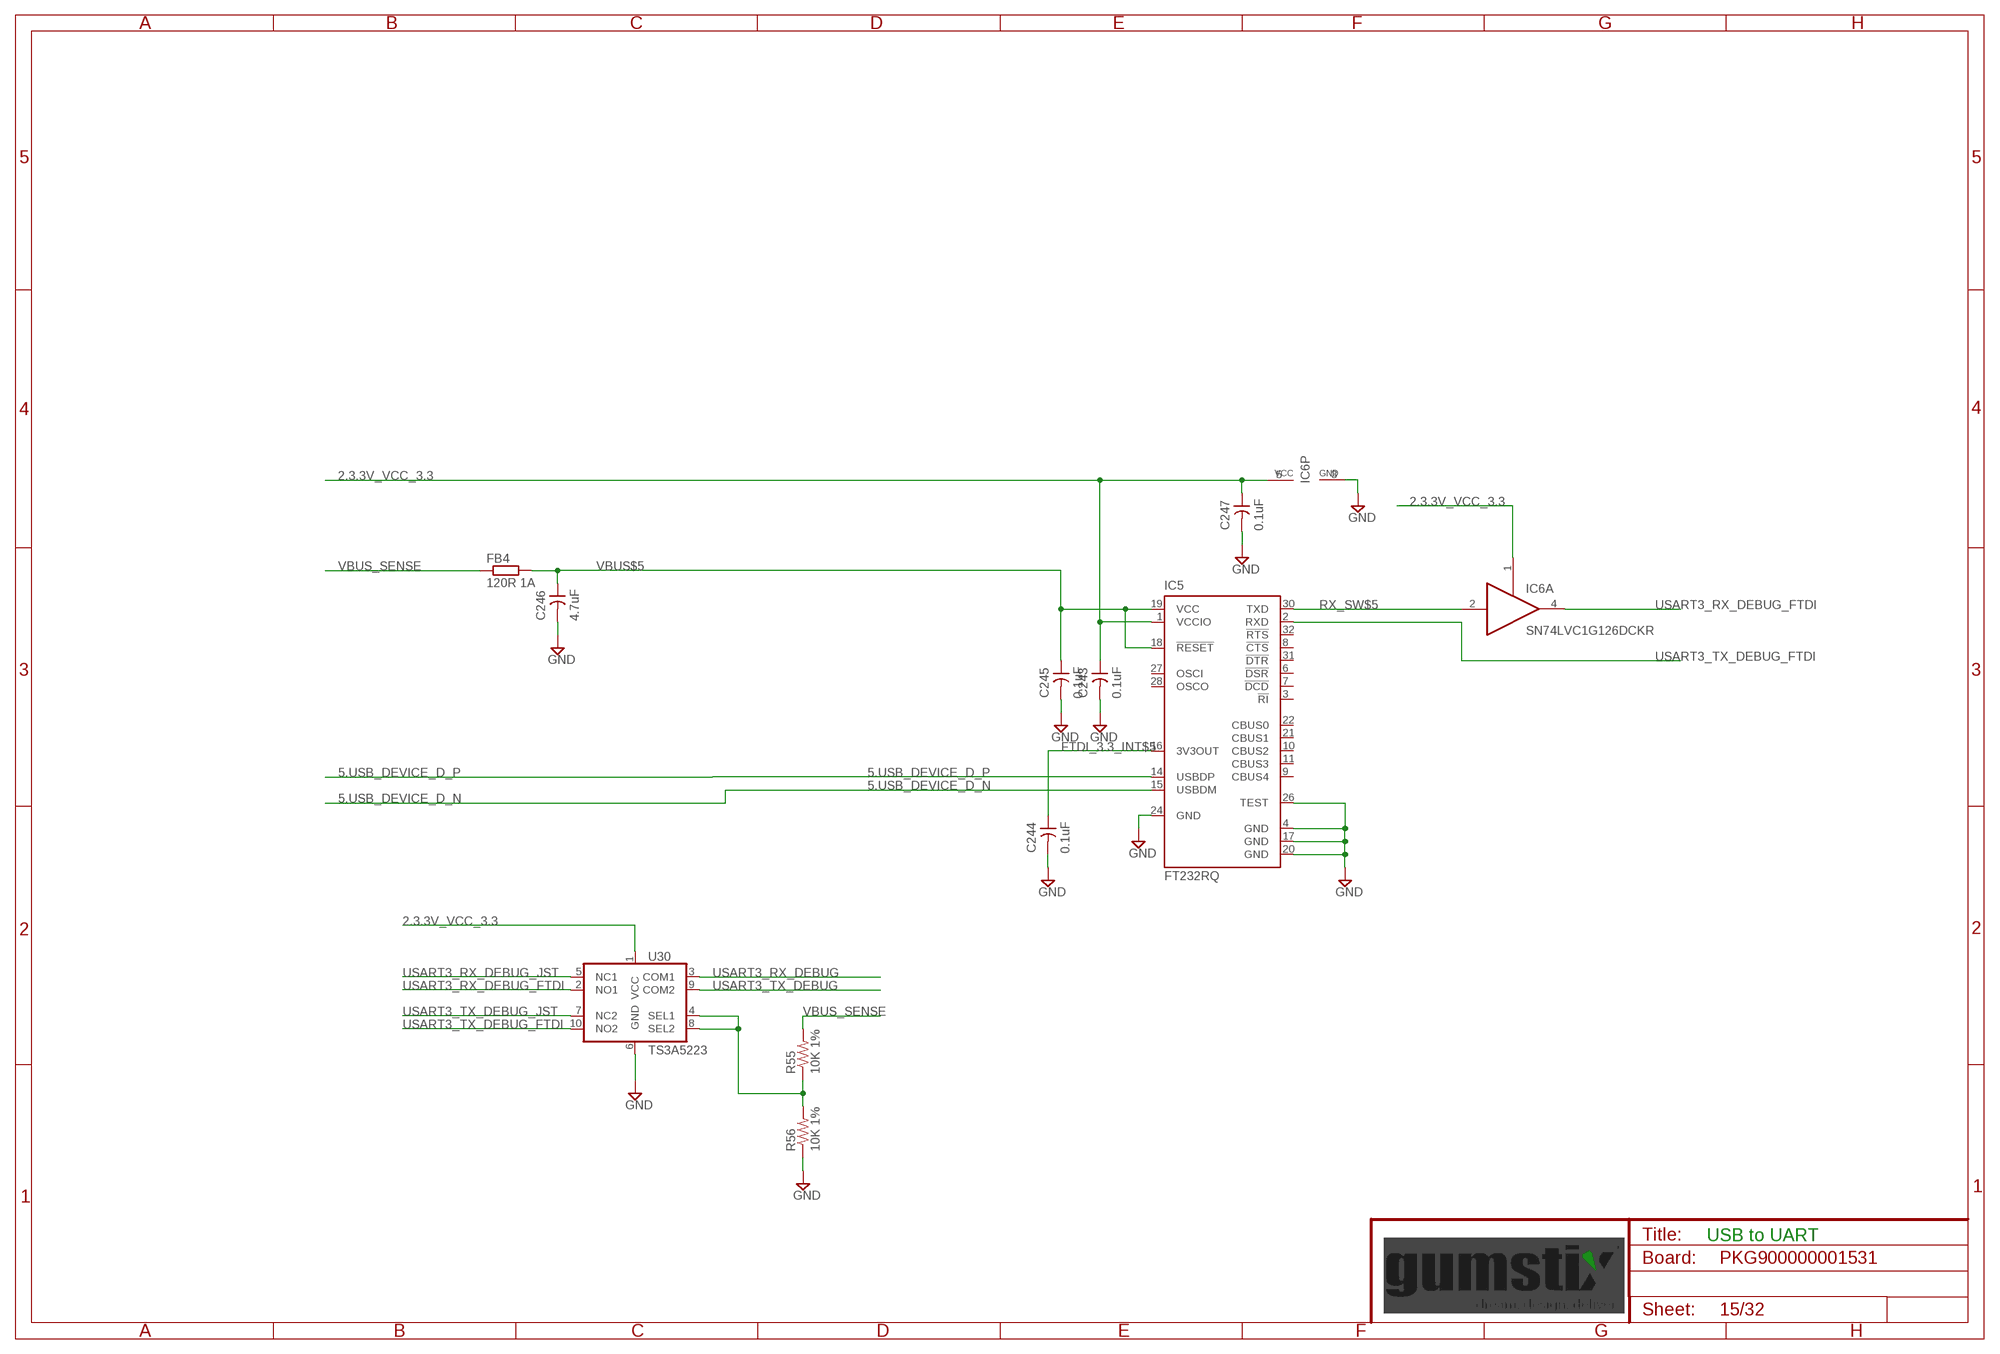
[diagram p14: schematic, sheet 15]

### Parts
C243  0.1uF  C0201  [0201]
C244  0.1uF  C0201  [0201]
C245  0.1uF  C0201  [0201]
C246  4.7uF  C0603  [0603]
C247  0.1uF  C0201  [0201]
FB4  120R 1A  FB0402  [0402]
IC5  FT232RQ  [QFN32]
IC6  SN74LVC1G126DCKR  [SC70-5]
R55  10K 1%  R0201  [0201]
R56  10K 1%  R0201  [0201]
U30  TS3A5223  [UQFN-10]

### Nets
2.3.3V_VCC_3.3 [supply]: C243.1 C247.1 IC5.1(VCCIO) IC6.1(A:OE) IC6.5(P:VCC) U30.1(VCC) ; also sheet 2,3,4,5,11,12,14,19,20,21,22,29,30,32
5.USB_DEVICE_D_N [USB]: IC5.15(USBDM) ; also sheet 14
5.USB_DEVICE_D_P [USB]: IC5.14(USBDP) ; also sheet 14
FTDI_3.3_INT$5 [supply]: C244.1 IC5.16(3V3OUT)
GND [supply]: C243.2 C244.2 C245.2 C246.2 C247.2 IC5.4(GND) IC5.17(GND) IC5.20(GND) IC5.24(GND) IC5.26(TEST) IC6.3(P:GND) R56.1 U30.6(GND) ; also sheet 2,3,4,5,6,7,8,9,10,12,13,14,16,17,18,19,20,21,22,23,24,25,26,27,28,29,30,31,32
RX_SW$5: IC5.30(TXD) IC6.2(A:I)
UART_MUX_SEL$: R55.1 R56.2 U30.4(SEL1) U30.8(SEL2)
USART3_RX_DEBUG: U30.3(COM1) ; also sheet 2
USART3_RX_DEBUG_FTDI: IC6.4(A:O) U30.2(NO1)
USART3_RX_DEBUG_JST: U30.5(NC1) ; also sheet 3
USART3_TX_DEBUG: U30.9(COM2) ; also sheet 2
USART3_TX_DEBUG_FTDI: IC5.2(RXD) U30.10(NO2)
USART3_TX_DEBUG_JST: U30.7(NC2) ; also sheet 3
VBUS$5 [supply]: C245.1 C246.1 FB4.2 IC5.18(!RESET) IC5.19(VCC)
VBUS_SENSE [supply]: FB4.1 R55.2 ; also sheet 2,4,13,16
Unconnected: IC5.3(!RI) IC5.6(!DSR) IC5.7(!DCD) IC5.8(!CTS) IC5.9(CBUS4) IC5.10(CBUS2) IC5.11(CBUS3) IC5.21(CBUS1) IC5.22(CBUS0) IC5.27(OSCI) IC5.28(OSCO) IC5.31(!DTR) IC5.32(!RTS)

### Notes on the sheet
- USB to UART

## Sheet 16 of 32
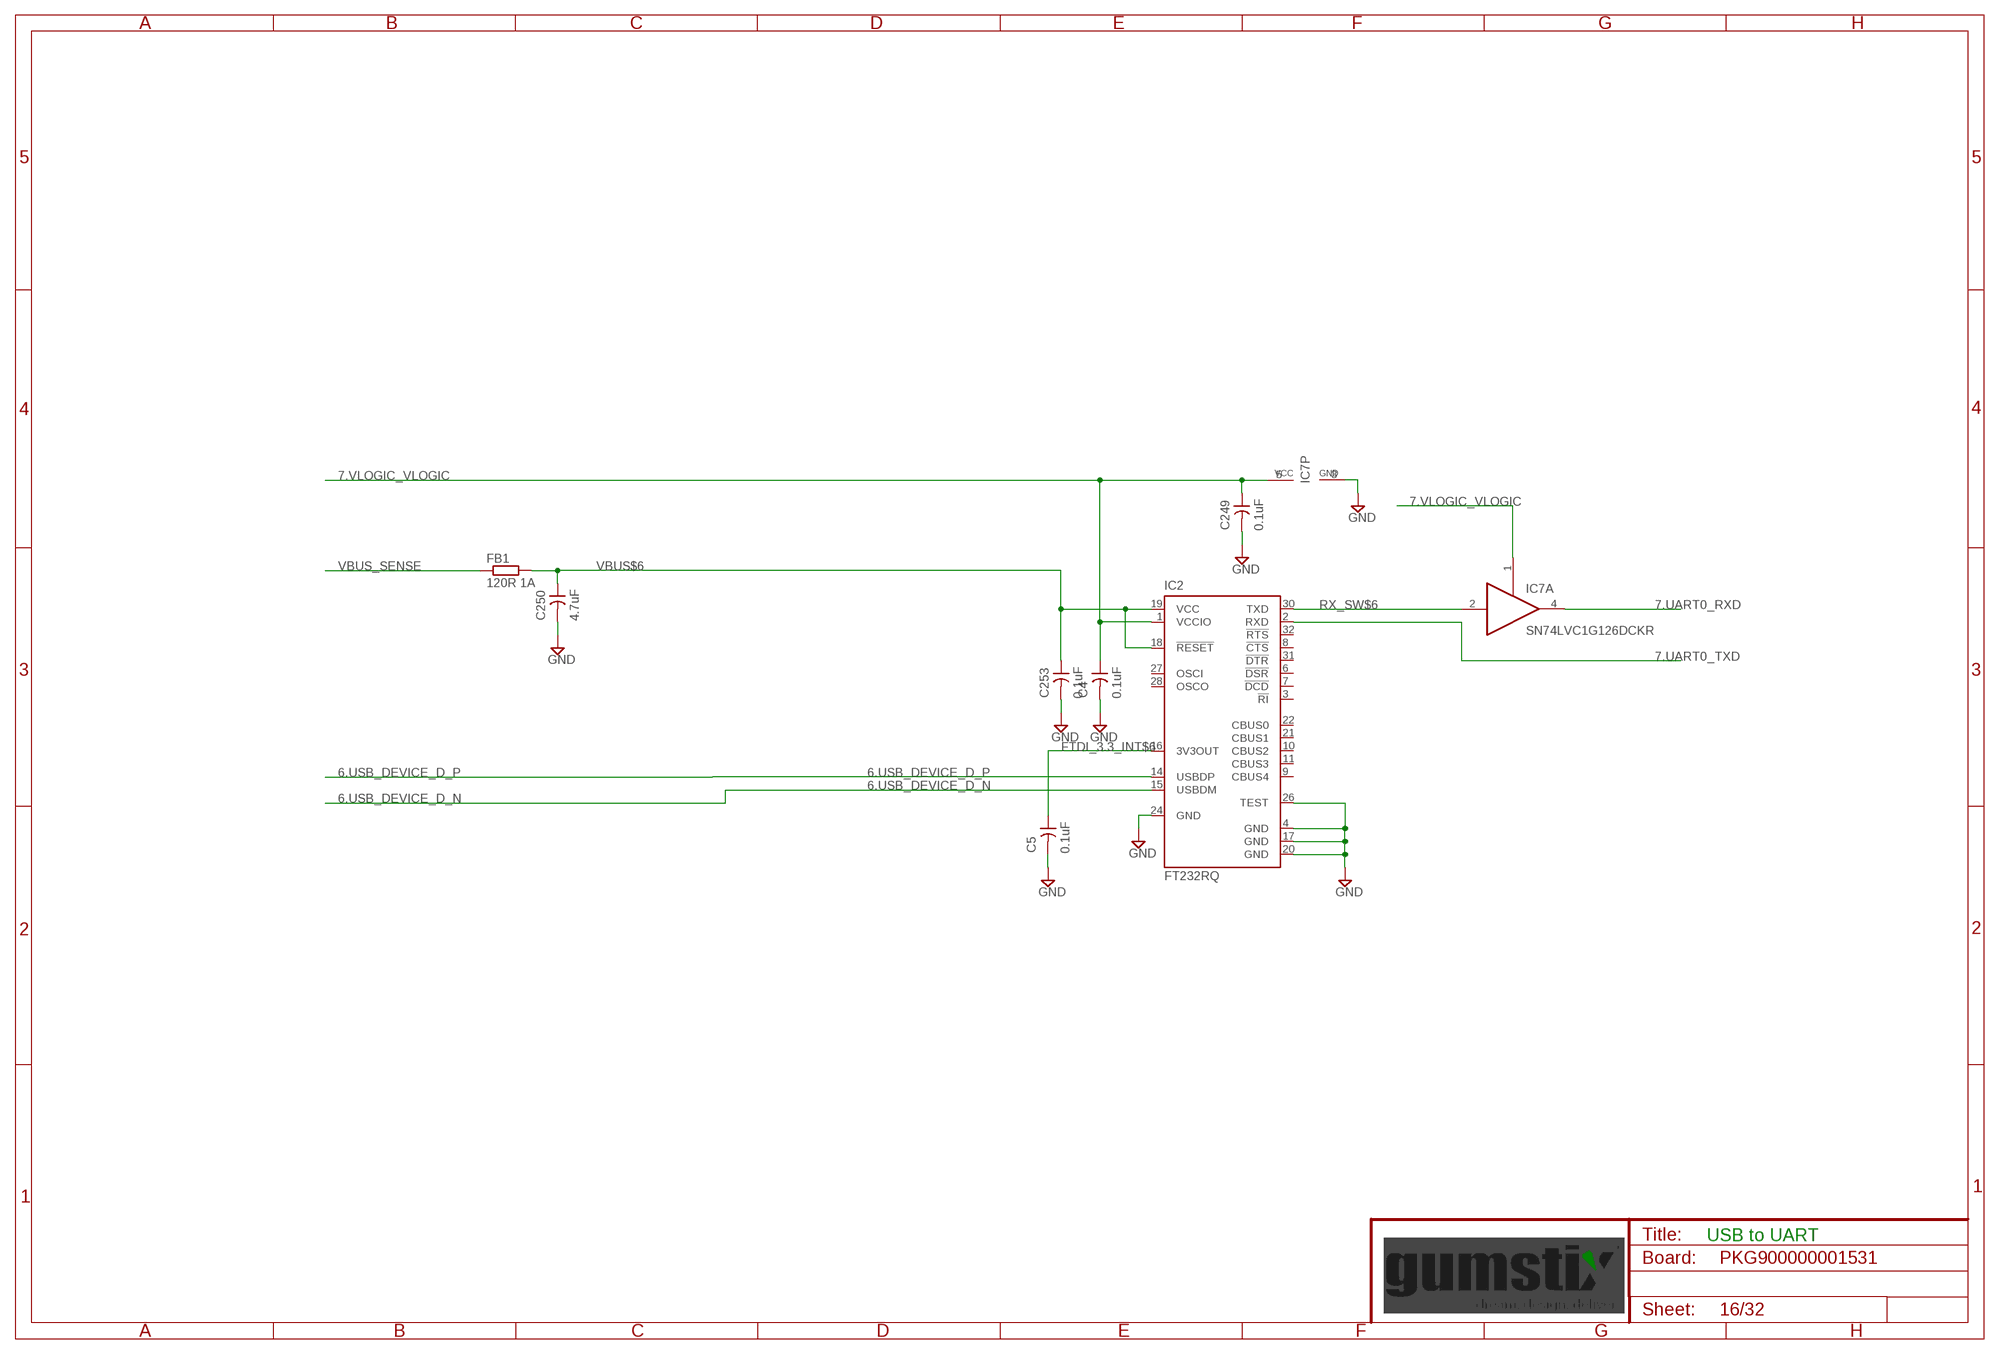
[diagram p15: schematic, sheet 16]

### Parts
C4  0.1uF  C0201  [0201]
C5  0.1uF  C0201  [0201]
C249  0.1uF  C0201  [0201]
C250  4.7uF  C0603  [0603]
C253  0.1uF  C0201  [0201]
FB1  120R 1A  FB0402  [0402]
IC2  FT232RQ  [QFN32]
IC7  SN74LVC1G126DCKR  [SC70-5]

### Nets
6.USB_DEVICE_D_N [USB]: IC2.15(USBDM) ; also sheet 14
6.USB_DEVICE_D_P [USB]: IC2.14(USBDP) ; also sheet 14
7.UART0_RXD: IC7.4(A:O) ; also sheet 17
7.UART0_TXD: IC2.2(RXD) ; also sheet 17
7.VLOGIC_VLOGIC [supply]: C4.1 C249.1 IC2.1(VCCIO) IC7.1(A:OE) IC7.5(P:VCC) ; also sheet 17,19
FTDI_3.3_INT$6 [supply]: C5.1 IC2.16(3V3OUT)
GND [supply]: C4.2 C5.2 C249.2 C250.2 C253.2 IC2.4(GND) IC2.17(GND) IC2.20(GND) IC2.24(GND) IC2.26(TEST) IC7.3(P:GND) ; also sheet 2,3,4,5,6,7,8,9,10,12,13,14,15,17,18,19,20,21,22,23,24,25,26,27,28,29,30,31,32
RX_SW$6: IC2.30(TXD) IC7.2(A:I)
VBUS$6 [supply]: C250.1 C253.1 FB1.2 IC2.18(!RESET) IC2.19(VCC)
VBUS_SENSE [supply]: FB1.1 ; also sheet 2,4,13,15
Unconnected: IC2.3(!RI) IC2.6(!DSR) IC2.7(!DCD) IC2.8(!CTS) IC2.9(CBUS4) IC2.10(CBUS2) IC2.11(CBUS3) IC2.21(CBUS1) IC2.22(CBUS0) IC2.27(OSCI) IC2.28(OSCO) IC2.31(!DTR) IC2.32(!RTS)

### Notes on the sheet
- USB to UART

## Sheet 17 of 32
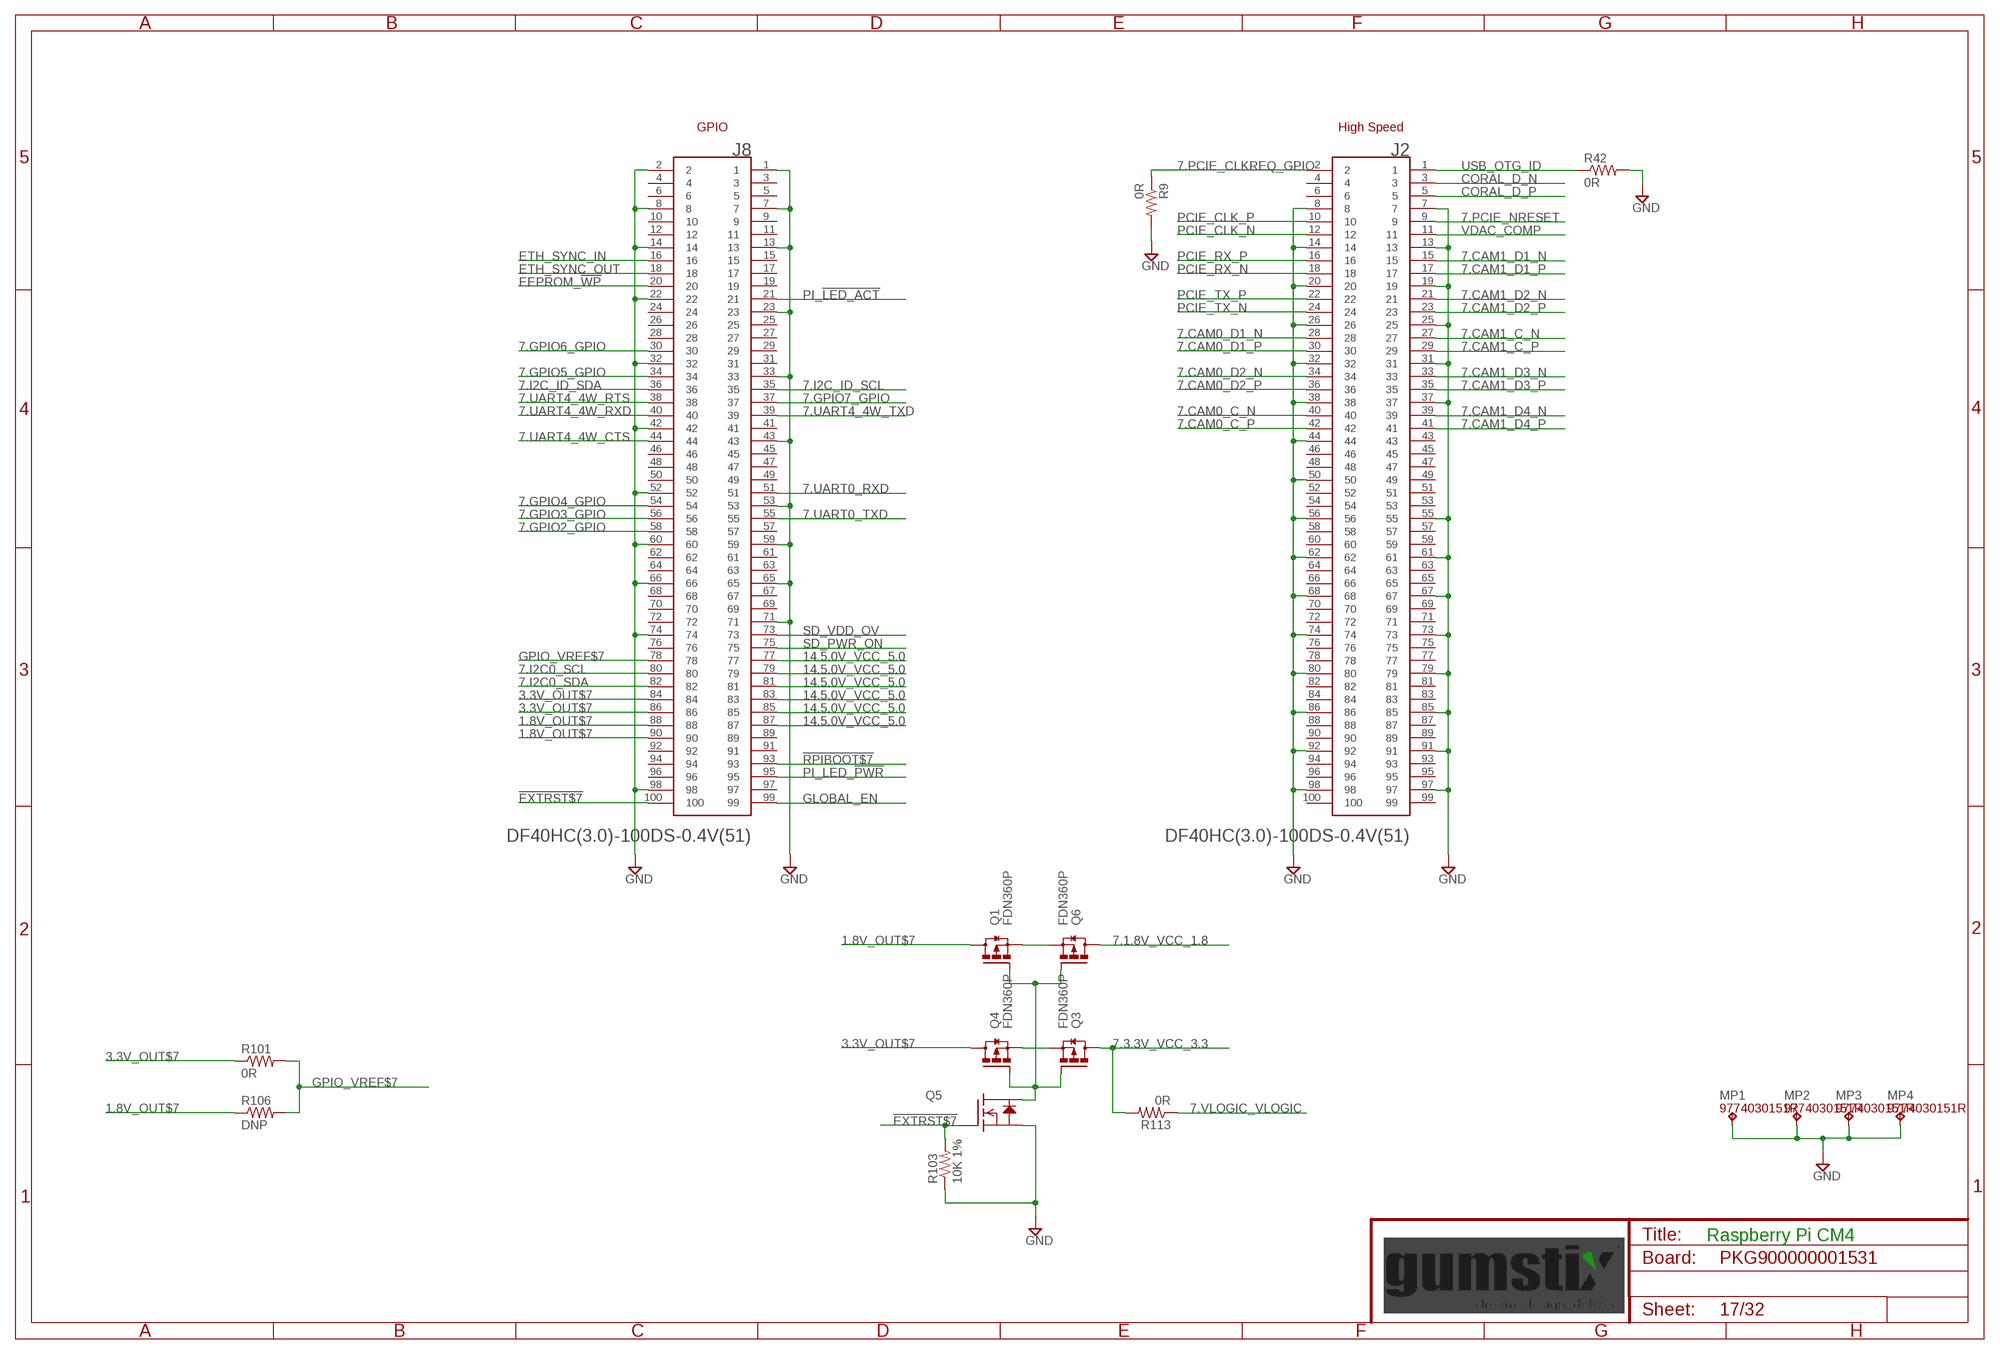
[diagram p16: schematic, sheet 17]

### Parts
J2  DF40HC(3.0)-100DS-0.4V(51)  DF40C-100DS-0.4V(51)  [HRS_DF40C-100DS-0.4V(51)]
J8  DF40HC(3.0)-100DS-0.4V(51)  DF40C-100DS-0.4V(51)  [HRS_DF40C-100DS-0.4V(51)]
MP1  9774030151R  BULLET_CONN2.5MM  [WA-SMSI_9774___151]
MP2  9774030151R  BULLET_CONN2.5MM  [WA-SMSI_9774___151]
MP3  9774030151R  BULLET_CONN2.5MM  [WA-SMSI_9774___151]
MP4  9774030151R  BULLET_CONN2.5MM  [WA-SMSI_9774___151]
Q1  FDN360P  MOSFET_P_ENH  [SOT23]
Q3  FDN360P  MOSFET_P_ENH  [SOT23]
Q4  FDN360P  MOSFET_P_ENH  [SOT23]
Q5  BSS138  [SOT23]
Q6  FDN360P  MOSFET_P_ENH  [SOT23]
R9  0R  R0201  [0201]
R42  0R  R0201  [0201]
R101  0R  R0201  [0201]
R103  10K 1%  R0201  [0201]
R106  DNP  R0201  [0201]
R113  0R  R0201  [0201]

### Nets
1.8V_OUT$7 [supply]: J8.88 J8.90 Q1.3(D) R106.1
3.3V_OUT$7 [supply]: J8.84 J8.86 Q4.3(D) R101.1
7.1.8V_VCC_1.8: Q6.3(D) ; also sheet 28
7.3.3V_VCC_3.3 [supply]: Q3.3(D) R113.2 ; also sheet 27,28
7.CAM0_C_N [HDMI]: J2.40 ; also sheet 21
7.CAM0_C_P [HDMI]: J2.42 ; also sheet 21
7.CAM0_D1_N [HDMI]: J2.28 ; also sheet 21
7.CAM0_D1_P [HDMI]: J2.30 ; also sheet 21
7.CAM0_D2_N [HDMI]: J2.34 ; also sheet 21
7.CAM0_D2_P [HDMI]: J2.36 ; also sheet 21
7.CAM1_C_N [HDMI]: J2.27 ; also sheet 22
7.CAM1_C_P [HDMI]: J2.29 ; also sheet 22
7.CAM1_D1_N [HDMI]: J2.15 ; also sheet 22
7.CAM1_D1_P [HDMI]: J2.17 ; also sheet 22
7.CAM1_D2_N [HDMI]: J2.21 ; also sheet 22
7.CAM1_D2_P [HDMI]: J2.23 ; also sheet 22
7.CAM1_D3_N [HDMI]: J2.33
7.CAM1_D3_P [HDMI]: J2.35
7.CAM1_D4_N [HDMI]: J2.39
7.CAM1_D4_P [HDMI]: J2.41
7.GPIO2_GPIO: J8.58 ; also sheet 28
7.GPIO3_GPIO: J8.56 ; also sheet 28
7.GPIO4_GPIO: J8.54 ; also sheet 21
7.GPIO5_GPIO: J8.34 ; also sheet 22
7.GPIO6_GPIO: J8.30 ; also sheet 28
7.GPIO7_GPIO: J8.37 ; also sheet 28
7.I2C0_SCL: J8.80 ; also sheet 22
7.I2C0_SDA: J8.82 ; also sheet 22
7.I2C_ID_SCL: J8.35 ; also sheet 18,21
7.I2C_ID_SDA: J8.36 ; also sheet 18,21
7.PCIE_CLKREQ_GPIO: J2.2 R9.1
7.PCIE_NRESET: J2.9 ; also sheet 32
7.UART0_RXD: J8.51 ; also sheet 16
7.UART0_TXD: J8.55 ; also sheet 16
7.UART4_4W_CTS: J8.44 ; also sheet 19
7.UART4_4W_RTS: J8.38 ; also sheet 19
7.UART4_4W_RXD: J8.40 ; also sheet 19
7.UART4_4W_TXD: J8.39 ; also sheet 19
7.VLOGIC_VLOGIC [supply]: R113.1 ; also sheet 16,19
14.5.0V_VCC_5.0 [supply]: J8.77 J8.79 J8.81 J8.83 J8.85 J8.87 ; also sheet 3,12,25
!EXTRST$7: J8.100 Q5.1(G) R103.2
!RPIBOOT$7: J8.93 ; also sheet 18
CORAL_D_N [USB]: J2.3 ; also sheet 14
CORAL_D_P [USB]: J2.5 ; also sheet 14
DS_LOAD$7 [supply]: Q3.2(S) Q4.2(S)
DS_LOAD_1V8$7 [supply]: Q1.2(S) Q6.2(S)
EEPROM_!WP: J8.20
ETH_SYNC_IN: J8.16
ETH_SYNC_OUT: J8.18
GLOBAL_EN: J8.99
GND [supply]: J2.7 J2.8 J2.13 J2.14 J2.19 J2.20 J2.25 J2.26 J2.31 J2.32 J2.37 J2.38 J2.44 J2.50 J2.55 J2.56 J2.61 J2.62 J2.67 J2.68 J2.73 J2.74 J2.79 J2.80 J2.85 J2.86 J2.91 J2.92 J2.97 J2.98 J8.1 J8.2 J8.7 J8.8 J8.13 J8.14 J8.22 J8.23 J8.32 J8.33 J8.42 J8.43 J8.52 J8.53 J8.59 J8.60 J8.65 J8.66 J8.71 J8.74 J8.98 MP1.1(TP) MP2.1(TP) MP3.1(TP) MP4.1(TP) Q5.2(S) R9.2 R42.2 R103.1 ; also sheet 2,3,4,5,6,7,8,9,10,12,13,14,15,16,18,19,20,21,22,23,24,25,26,27,28,29,30,31,32
GPIO_VREF$7 [supply]: J8.78 R101.2 R106.2 ; also sheet 18
LOAD_GATE$7: Q1.1(G) Q3.1(G) Q4.1(G) Q5.3(D) Q6.1(G)
PCIE_CLK_N [USB]: J2.12 ; also sheet 32
PCIE_CLK_P [USB]: J2.10 ; also sheet 32
PCIE_RX_N [USB]: J2.18 ; also sheet 32
PCIE_RX_P [USB]: J2.16 ; also sheet 32
PCIE_TX_N [USB]: J2.24 ; also sheet 32
PCIE_TX_P [USB]: J2.22 ; also sheet 32
PI_!LED_ACT: J8.21
PI_LED_!PWR: J8.95
SD_PWR_ON: J8.75
SD_VDD_OV: J8.73
USB_OTG_ID: J2.1 R42.1
VDAC_COMP: J2.11
Unconnected: J2.4 J2.6 J2.43 J2.45 J2.46 J2.47 J2.48 J2.49 J2.51 J2.52 J2.53 J2.54 J2.57 J2.58 J2.59 J2.60 J2.63 J2.64 J2.65 J2.66 J2.69 J2.70 J2.71 J2.72 J2.75 J2.76 J2.77 J2.78 J2.81 J2.82 J2.83 J2.84 J2.87 J2.88 J2.89 J2.90 J2.93 J2.94 J2.95 J2.96 J2.99 J2.100 J8.3 J8.4 J8.5 J8.6 J8.9 J8.10 J8.11 J8.12 J8.15 J8.17 J8.19 J8.24 J8.25 J8.26 J8.27 J8.28 J8.29 J8.31 J8.41 J8.45 J8.46 J8.47 J8.48 J8.49 J8.50 J8.57 J8.61 J8.62 J8.63 J8.64 J8.67 J8.68 J8.69 J8.70 J8.72 J8.76 J8.89 J8.91 J8.92 J8.94 J8.96 J8.97

### Notes on the sheet
- GPIO | High Speed
- Raspberry Pi CM4

## Sheet 18 of 32
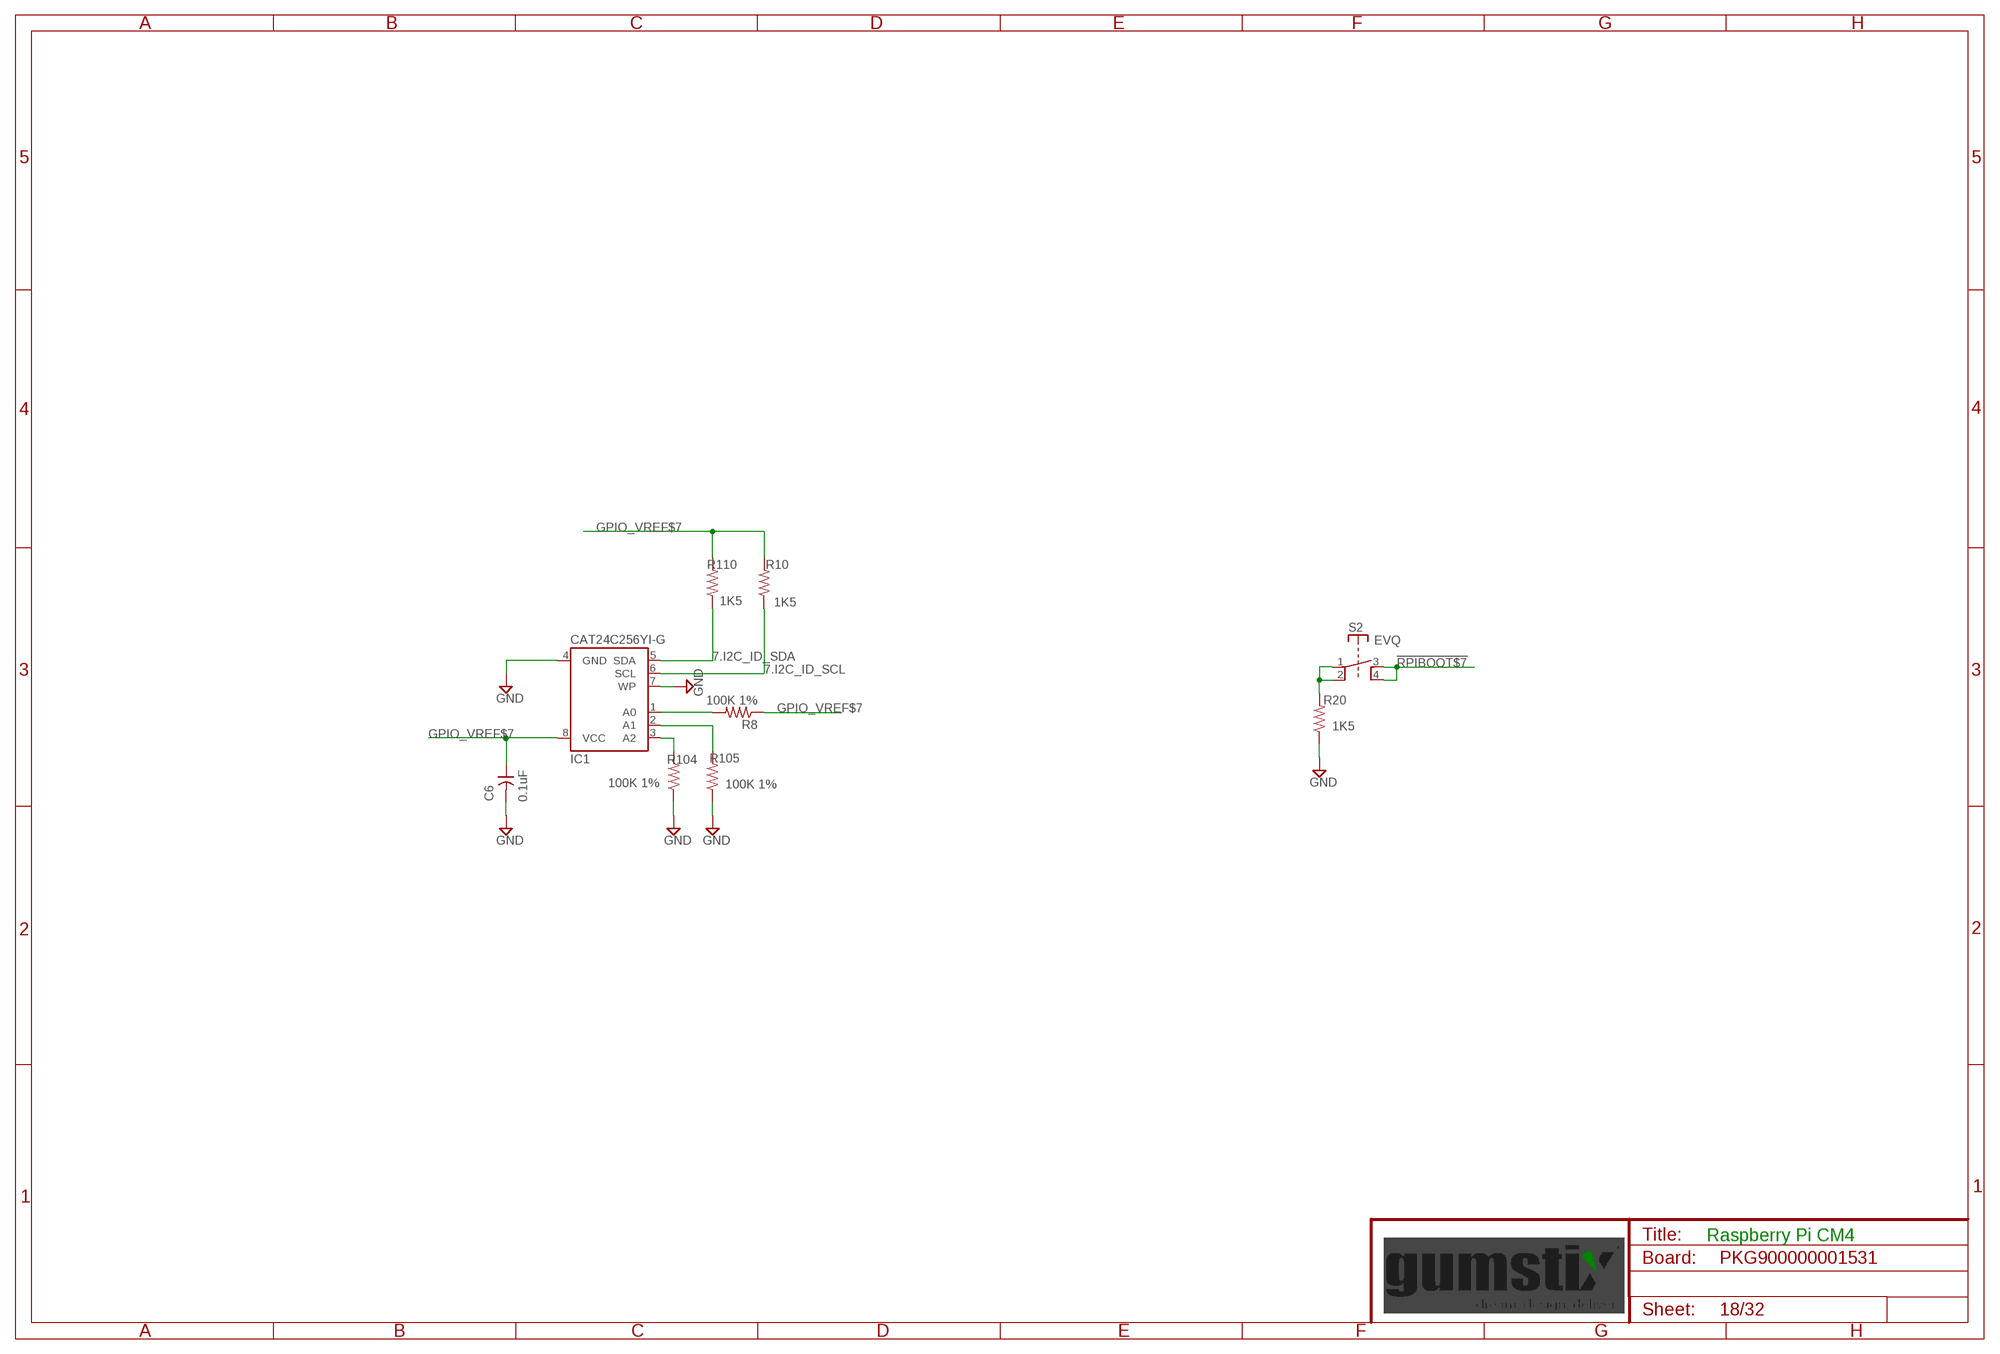
[diagram p17: schematic, sheet 18]

### Parts
C6  0.1uF  C0201  [0201]
IC1  CAT24C256YI-G  AT24CA  [TSSOP8]
R8  100K 1%  R0201  [0201]
R10  1K5  R0201  [0201]
R20  1K5  R0201  [0201]
R104  100K 1%  R0201  [0201]
R105  100K 1%  R0201  [0201]
R110  1K5  R0201  [0201]
S2  EVQ  EVQKMT0  [KMT0]

### Nets
7.I2C_ID_SCL: IC1.6(SCL) R10.1 ; also sheet 17,21
7.I2C_ID_SDA: IC1.5(SDA) R110.1 ; also sheet 17,21
!RPIBOOT$7: S2.3(B) S2.4(B') ; also sheet 17
A0$7: IC1.1(A0) R8.2
A1$7: IC1.2(A1) R105.2
A2$7: IC1.3(A2) R104.2
GND [supply]: C6.2 IC1.4(GND) IC1.7(WP) R20.1 R104.1 R105.1 ; also sheet 2,3,4,5,6,7,8,9,10,12,13,14,15,16,17,19,20,21,22,23,24,25,26,27,28,29,30,31,32
GPIO_VREF$7 [supply]: C6.1 IC1.8(VCC) R8.1 R10.2 R110.2 ; also sheet 17
RPIBOOT_SWITCH$19: R20.2 S2.1(A) S2.2(A')

### Notes on the sheet
- Raspberry Pi CM4

## Sheet 19 of 32
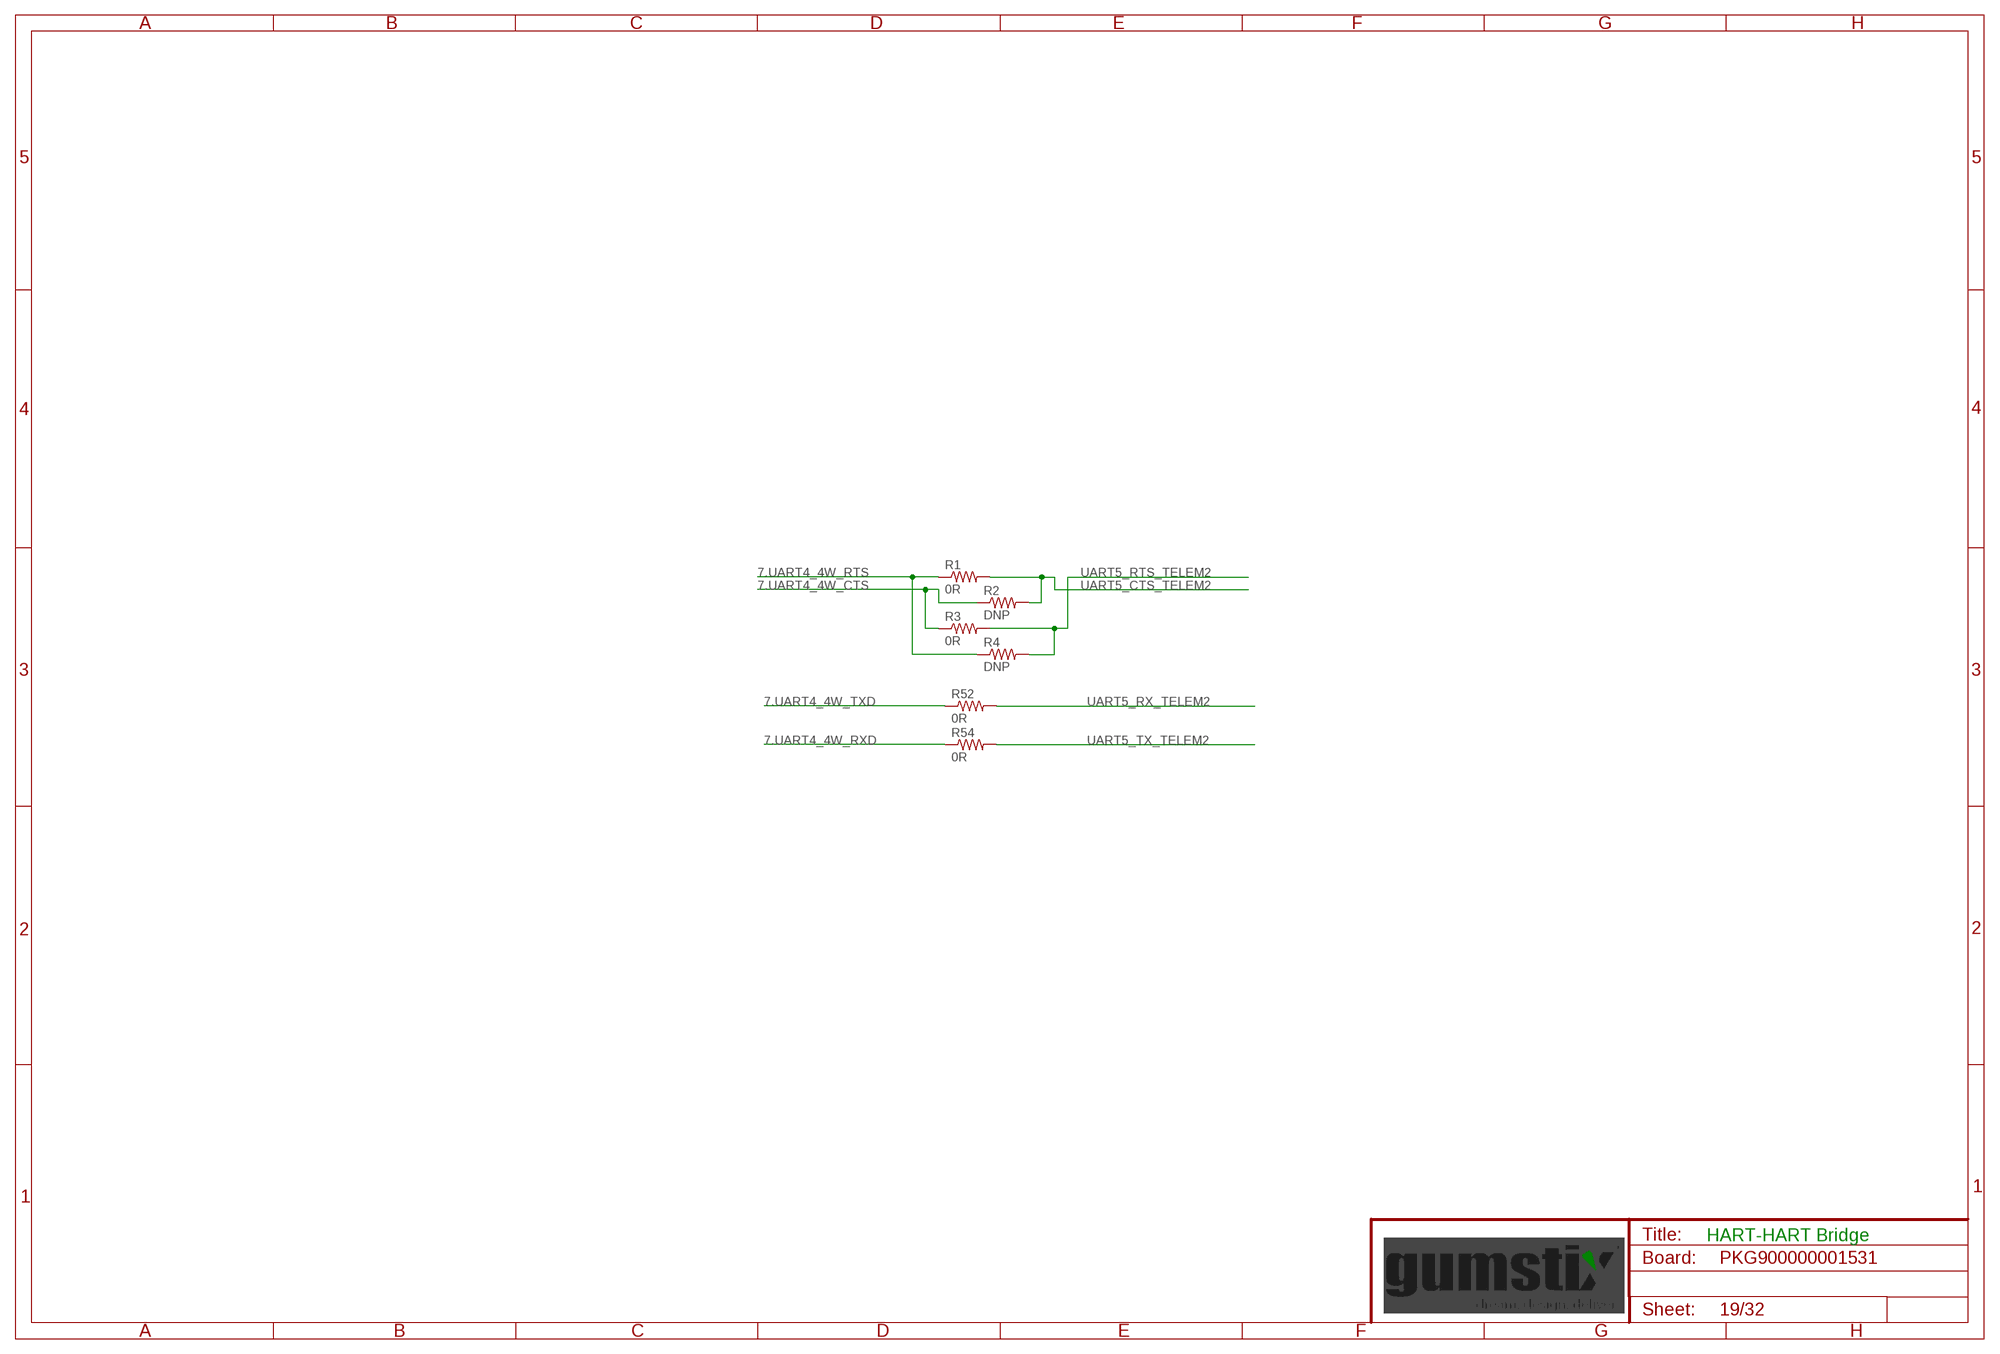
[diagram p18: schematic, sheet 19]

### Parts
R1  0R  R0201  [0201]
R2  DNP  R0201  [0201]
R3  0R  R0201  [0201]
R4  DNP  R0201  [0201]
R52  0R  R0201  [0201]
R54  0R  R0201  [0201]

### Nets
7.UART4_4W_CTS: R2.1 R3.1 ; also sheet 17
7.UART4_4W_RTS: R1.1 R4.1 ; also sheet 17
7.UART4_4W_RXD: R54.1 ; also sheet 17
7.UART4_4W_TXD: R52.1 ; also sheet 17
UART5_CTS_TELEM2: R1.2 R2.2 ; also sheet 2
UART5_RTS_TELEM2: R3.2 R4.2 ; also sheet 2
UART5_RX_TELEM2: R52.2 ; also sheet 2
UART5_TX_TELEM2: R54.2 ; also sheet 2

### Notes on the sheet
- HART-HART Bridge

## Sheet 20 of 32
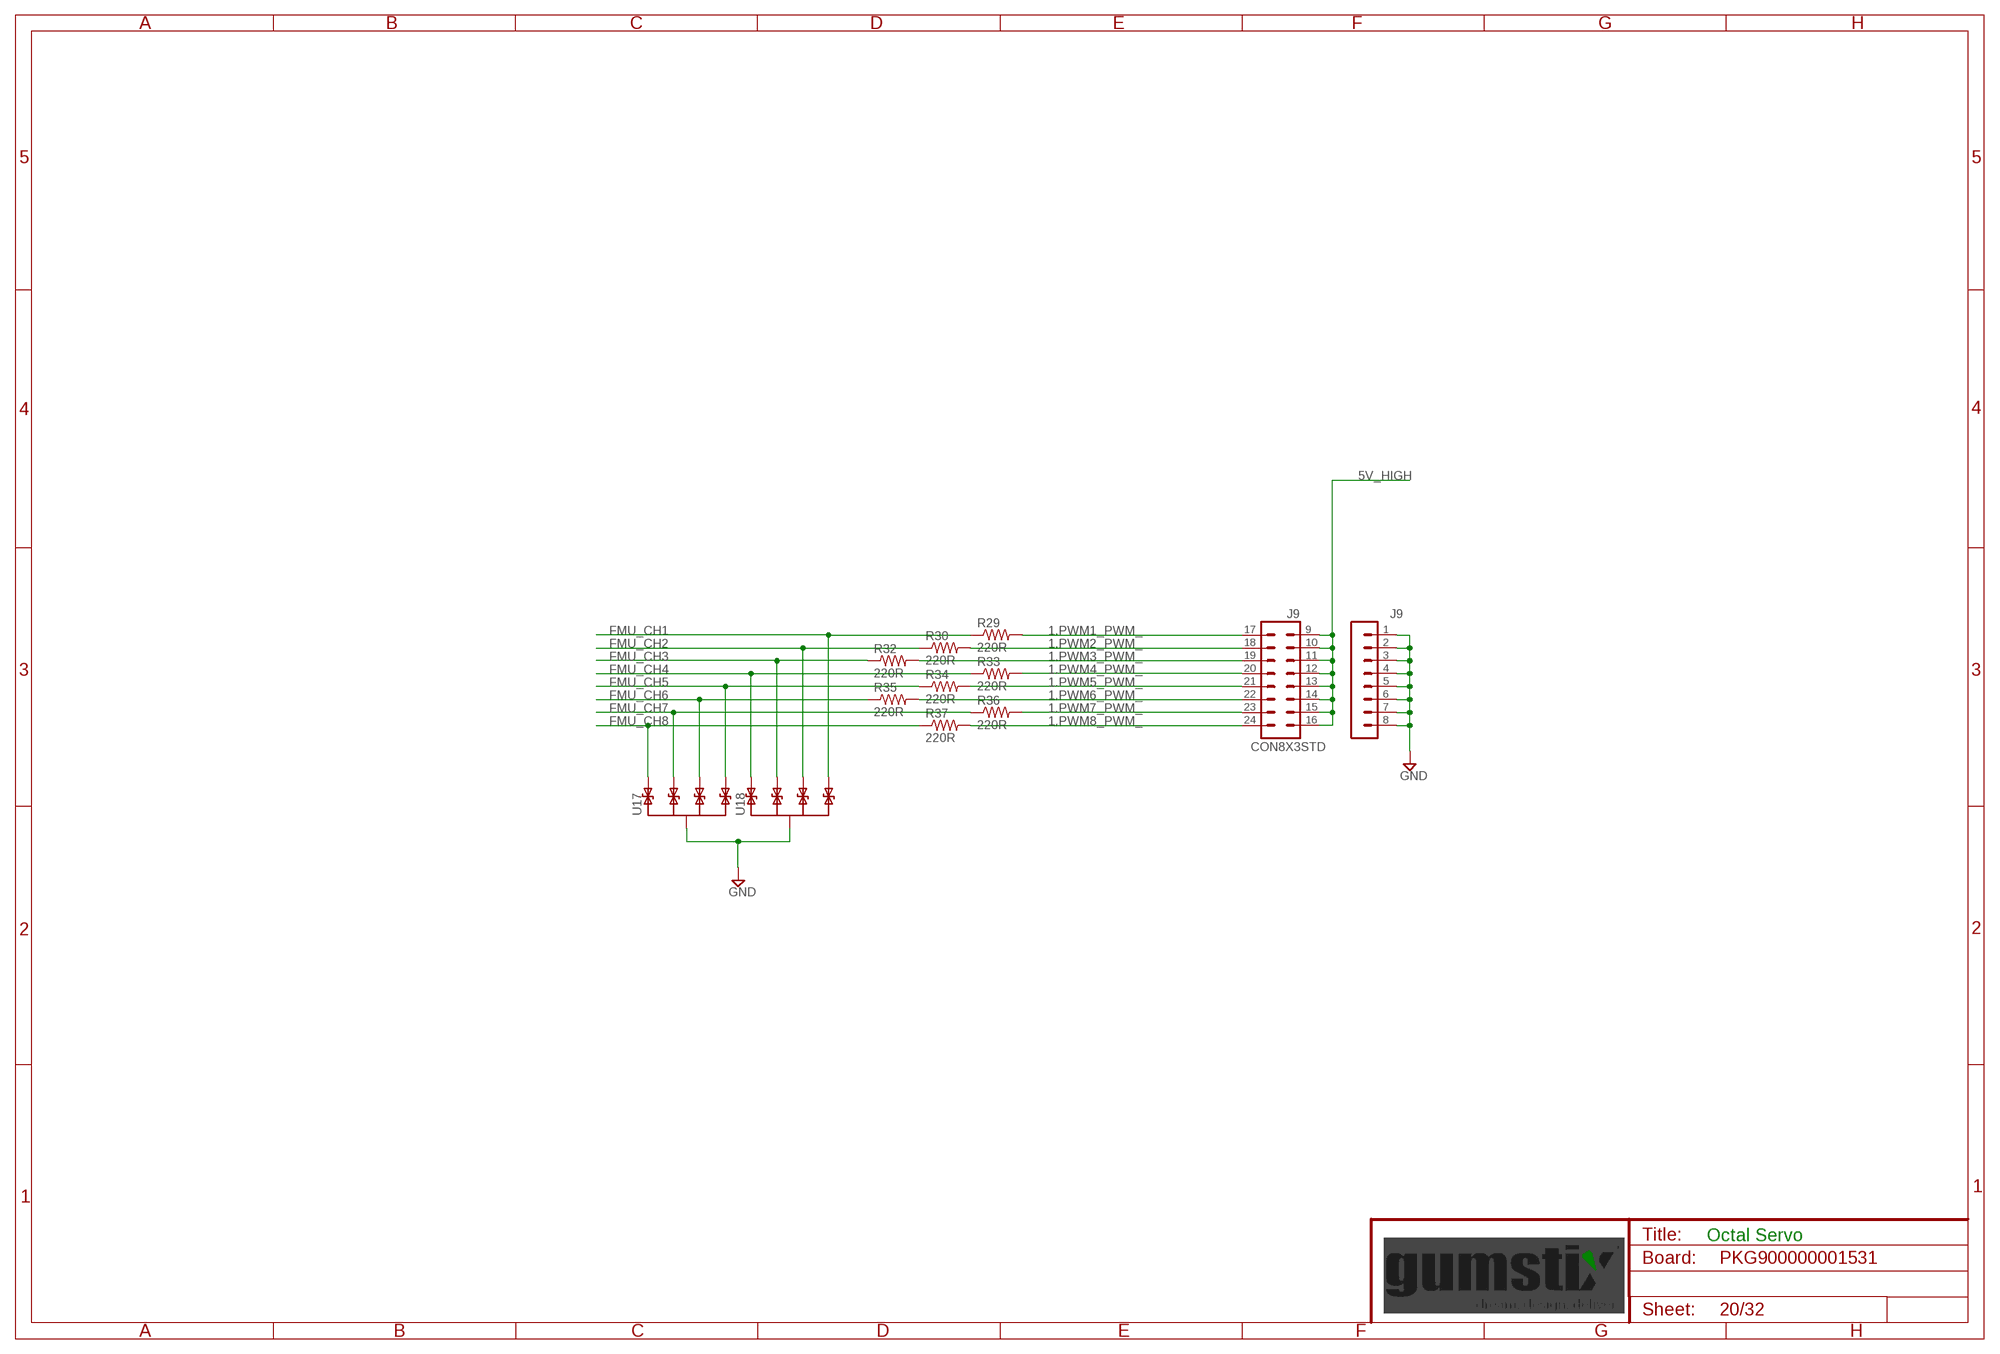
[diagram p19: schematic, sheet 20]

### Parts
J9  CON8X3STD  [MA08-3W-0100]
R29  220R  R0402  [0402]
R30  220R  R0402  [0402]
R32  220R  R0402  [0402]
R33  220R  R0402  [0402]
R34  220R  R0402  [0402]
R35  220R  R0402  [0402]
R36  220R  R0402  [0402]
R37  220R  R0402  [0402]
U17  TPD4E02B0410-USON  [UFDFN-10]
U18  TPD4E02B0410-USON  [UFDFN-10]

### Nets
1.PWM1_PWM_: J9.17 R29.2
1.PWM2_PWM_: J9.18 R30.2
1.PWM3_PWM_: J9.19 R32.2
1.PWM4_PWM_: J9.20 R33.2
1.PWM5_PWM_: J9.21 R34.2
1.PWM6_PWM_: J9.22 R35.2
1.PWM7_PWM_: J9.23 R36.2
1.PWM8_PWM_: J9.24 R37.2
5V_HIGH [supply]: J9.9 J9.10 J9.11 J9.12 J9.13 J9.14 J9.15 J9.16 ; also sheet 3
FMU_CH1: R29.1 U18.5(P4) U18.6(P4) ; also sheet 2
FMU_CH2: R30.1 U18.4(P3) U18.7(P3) ; also sheet 2
FMU_CH3: R32.1 U18.2 U18.9(P2) ; also sheet 2
FMU_CH4: R33.1 U18.1 U18.10(P1) ; also sheet 2
FMU_CH5: R34.1 U17.5(P4) U17.6(P4) ; also sheet 2
FMU_CH6: R35.1 U17.4(P3) U17.7(P3) ; also sheet 2
FMU_CH7: R36.1 U17.2 U17.9(P2) ; also sheet 2
FMU_CH8: R37.1 U17.1 U17.10(P1) ; also sheet 2
GND [supply]: J9.1 J9.2 J9.3 J9.4 J9.5 J9.6 J9.7 J9.8 U17.3(SHIELD) U17.8(SHIELD) U18.3(SHIELD) U18.8(SHIELD) ; also sheet 2,3,4,5,6,7,8,9,10,12,13,14,15,16,17,18,19,21,22,23,24,25,26,27,28,29,30,31,32

### Notes on the sheet
- Octal Servo

## Sheet 21 of 32
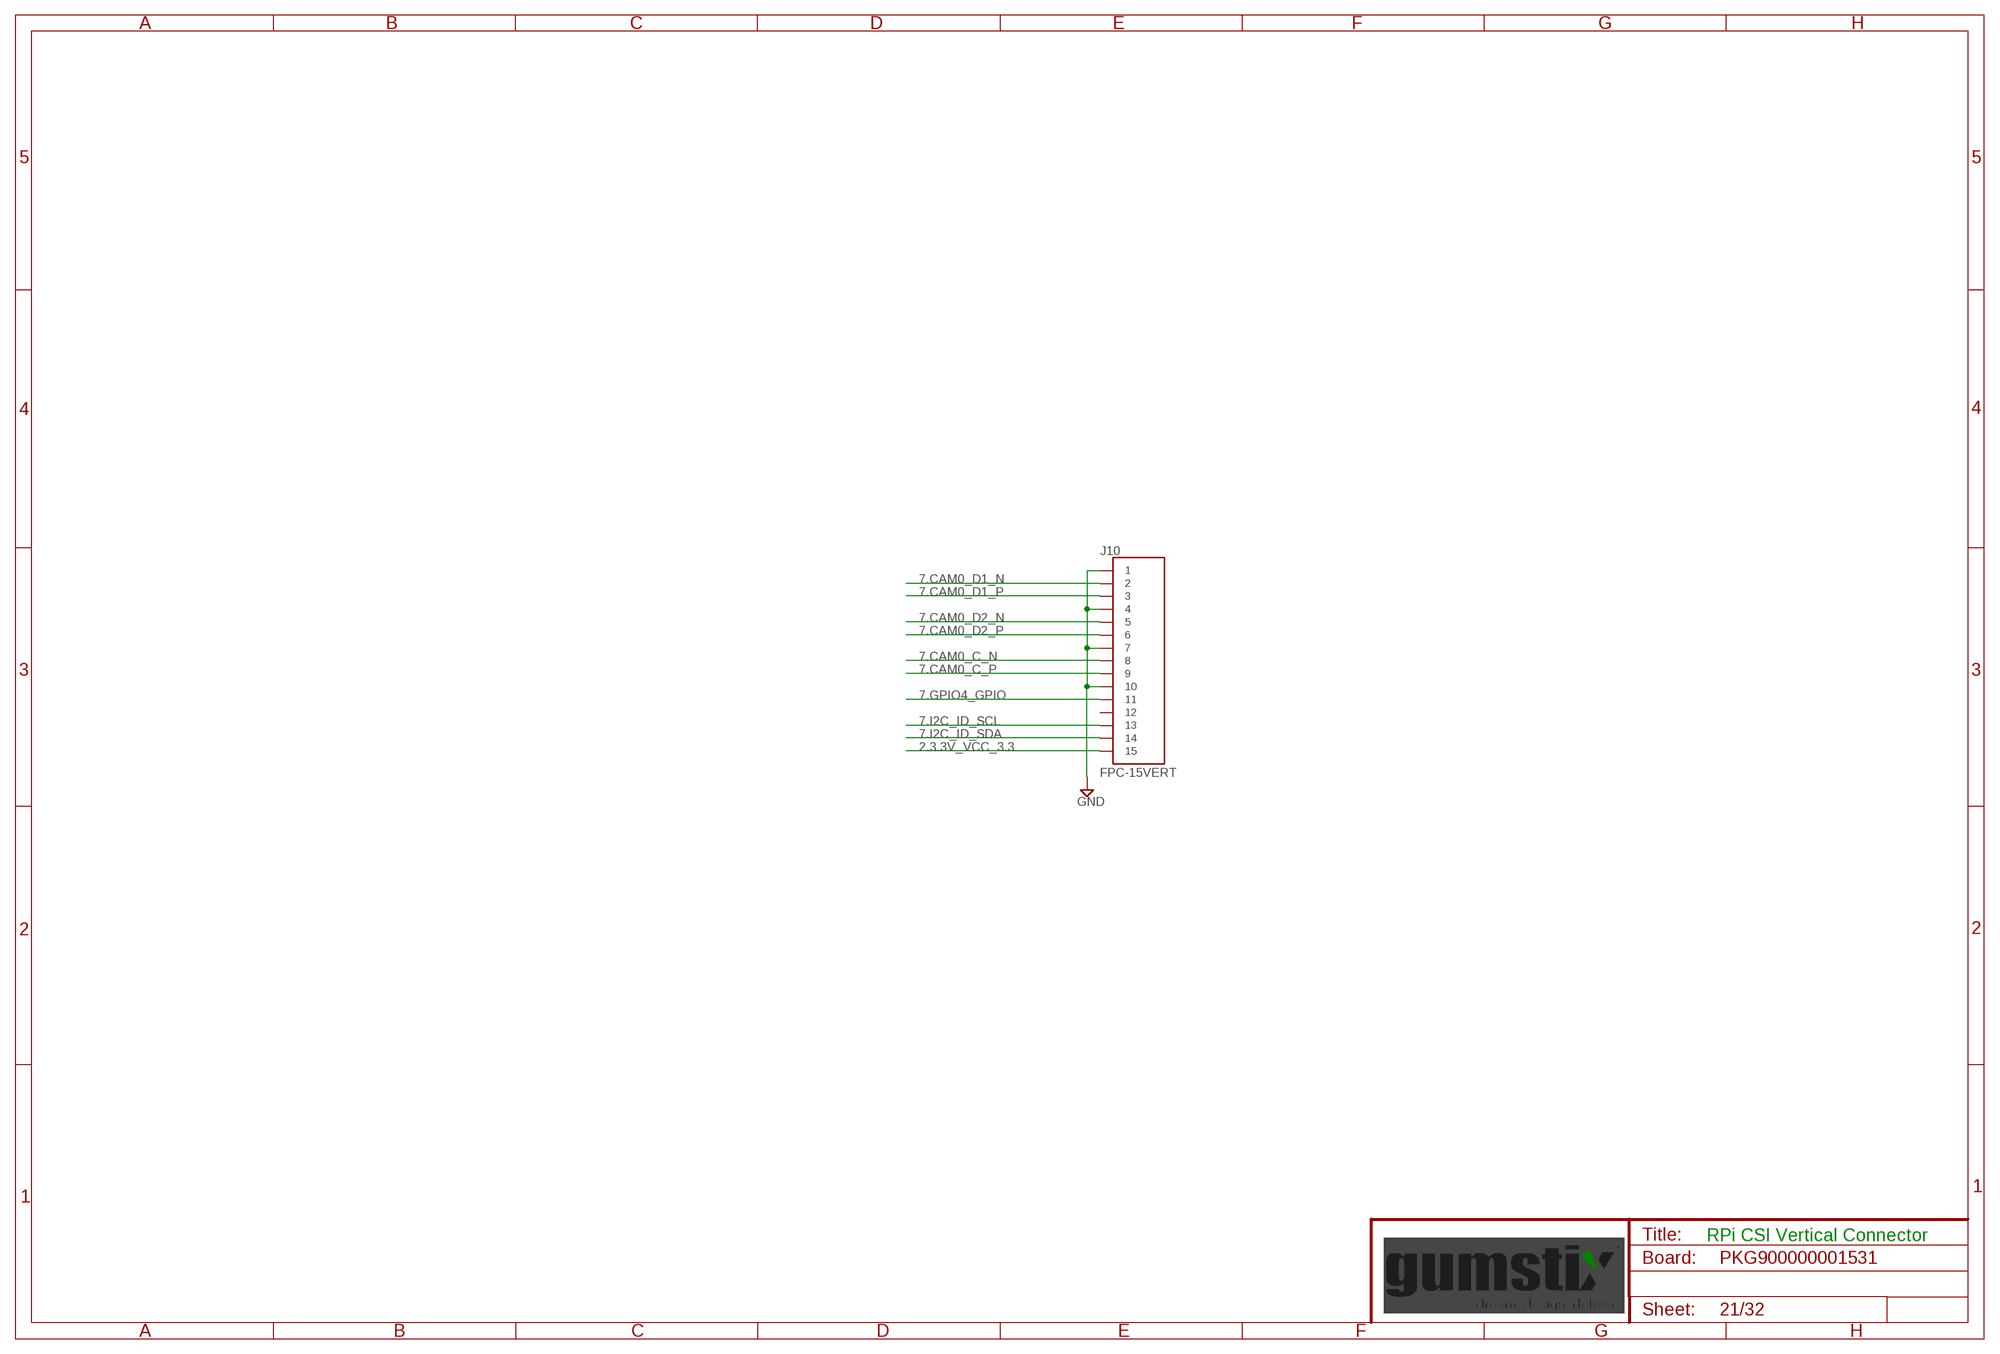
[diagram p20: schematic, sheet 21]

### Parts
J10  FPC-15VERT  [1-1734248-5]

### Nets
2.3.3V_VCC_3.3 [supply]: J10.1_15 ; also sheet 2,3,4,5,11,12,14,15,19,20,22,29,30,32
7.CAM0_C_N [HDMI]: J10.1_8 ; also sheet 17
7.CAM0_C_P [HDMI]: J10.1_9 ; also sheet 17
7.CAM0_D1_N [HDMI]: J10.1_2 ; also sheet 17
7.CAM0_D1_P [HDMI]: J10.1_3 ; also sheet 17
7.CAM0_D2_N [HDMI]: J10.1_5 ; also sheet 17
7.CAM0_D2_P [HDMI]: J10.1_6 ; also sheet 17
7.GPIO4_GPIO: J10.1_11 ; also sheet 17
7.I2C_ID_SCL: J10.1_13 ; also sheet 17,18
7.I2C_ID_SDA: J10.1_14 ; also sheet 17,18
GND [supply]: J10.1_1 J10.1_4 J10.1_7 J10.1_10 ; also sheet 2,3,4,5,6,7,8,9,10,12,13,14,15,16,17,18,19,20,22,23,24,25,26,27,28,29,30,31,32
Unconnected: J10.1_12

### Notes on the sheet
- RPi CSI Vertical Connector

## Sheet 22 of 32
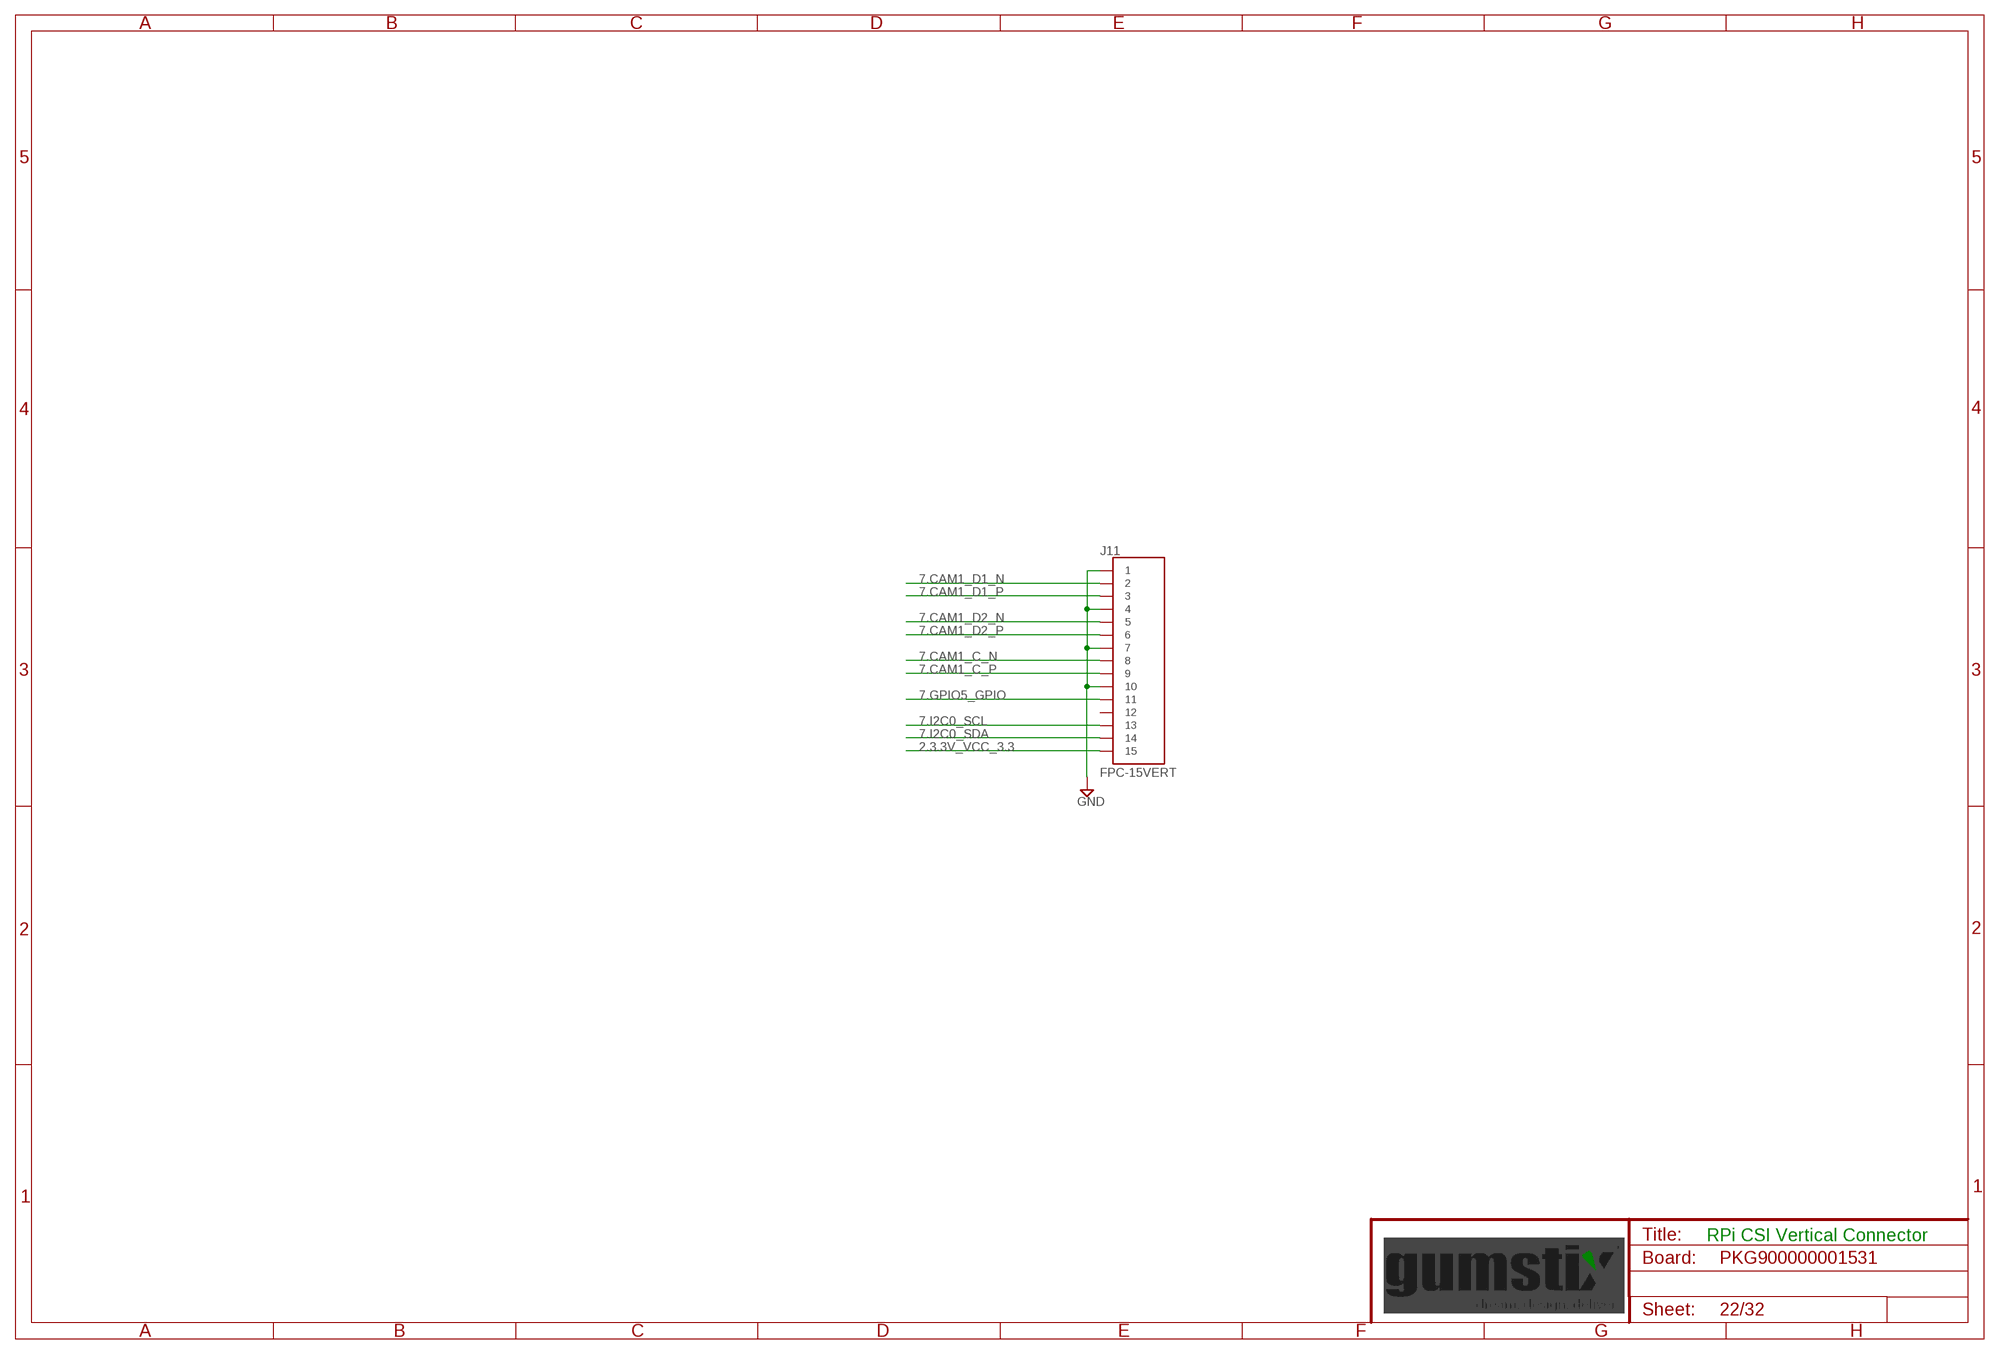
[diagram p21: schematic, sheet 22]

### Parts
J11  FPC-15VERT  [1-1734248-5]

### Nets
2.3.3V_VCC_3.3 [supply]: J11.1_15 ; also sheet 2,3,4,5,11,12,14,15,19,20,21,29,30,32
7.CAM1_C_N [HDMI]: J11.1_8 ; also sheet 17
7.CAM1_C_P [HDMI]: J11.1_9 ; also sheet 17
7.CAM1_D1_N [HDMI]: J11.1_2 ; also sheet 17
7.CAM1_D1_P [HDMI]: J11.1_3 ; also sheet 17
7.CAM1_D2_N [HDMI]: J11.1_5 ; also sheet 17
7.CAM1_D2_P [HDMI]: J11.1_6 ; also sheet 17
7.GPIO5_GPIO: J11.1_11 ; also sheet 17
7.I2C0_SCL: J11.1_13 ; also sheet 17
7.I2C0_SDA: J11.1_14 ; also sheet 17
GND [supply]: J11.1_1 J11.1_4 J11.1_7 J11.1_10 ; also sheet 2,3,4,5,6,7,8,9,10,12,13,14,15,16,17,18,19,20,21,23,24,25,26,27,28,29,30,31,32
Unconnected: J11.1_12

### Notes on the sheet
- RPi CSI Vertical Connector

## Sheet 23 of 32
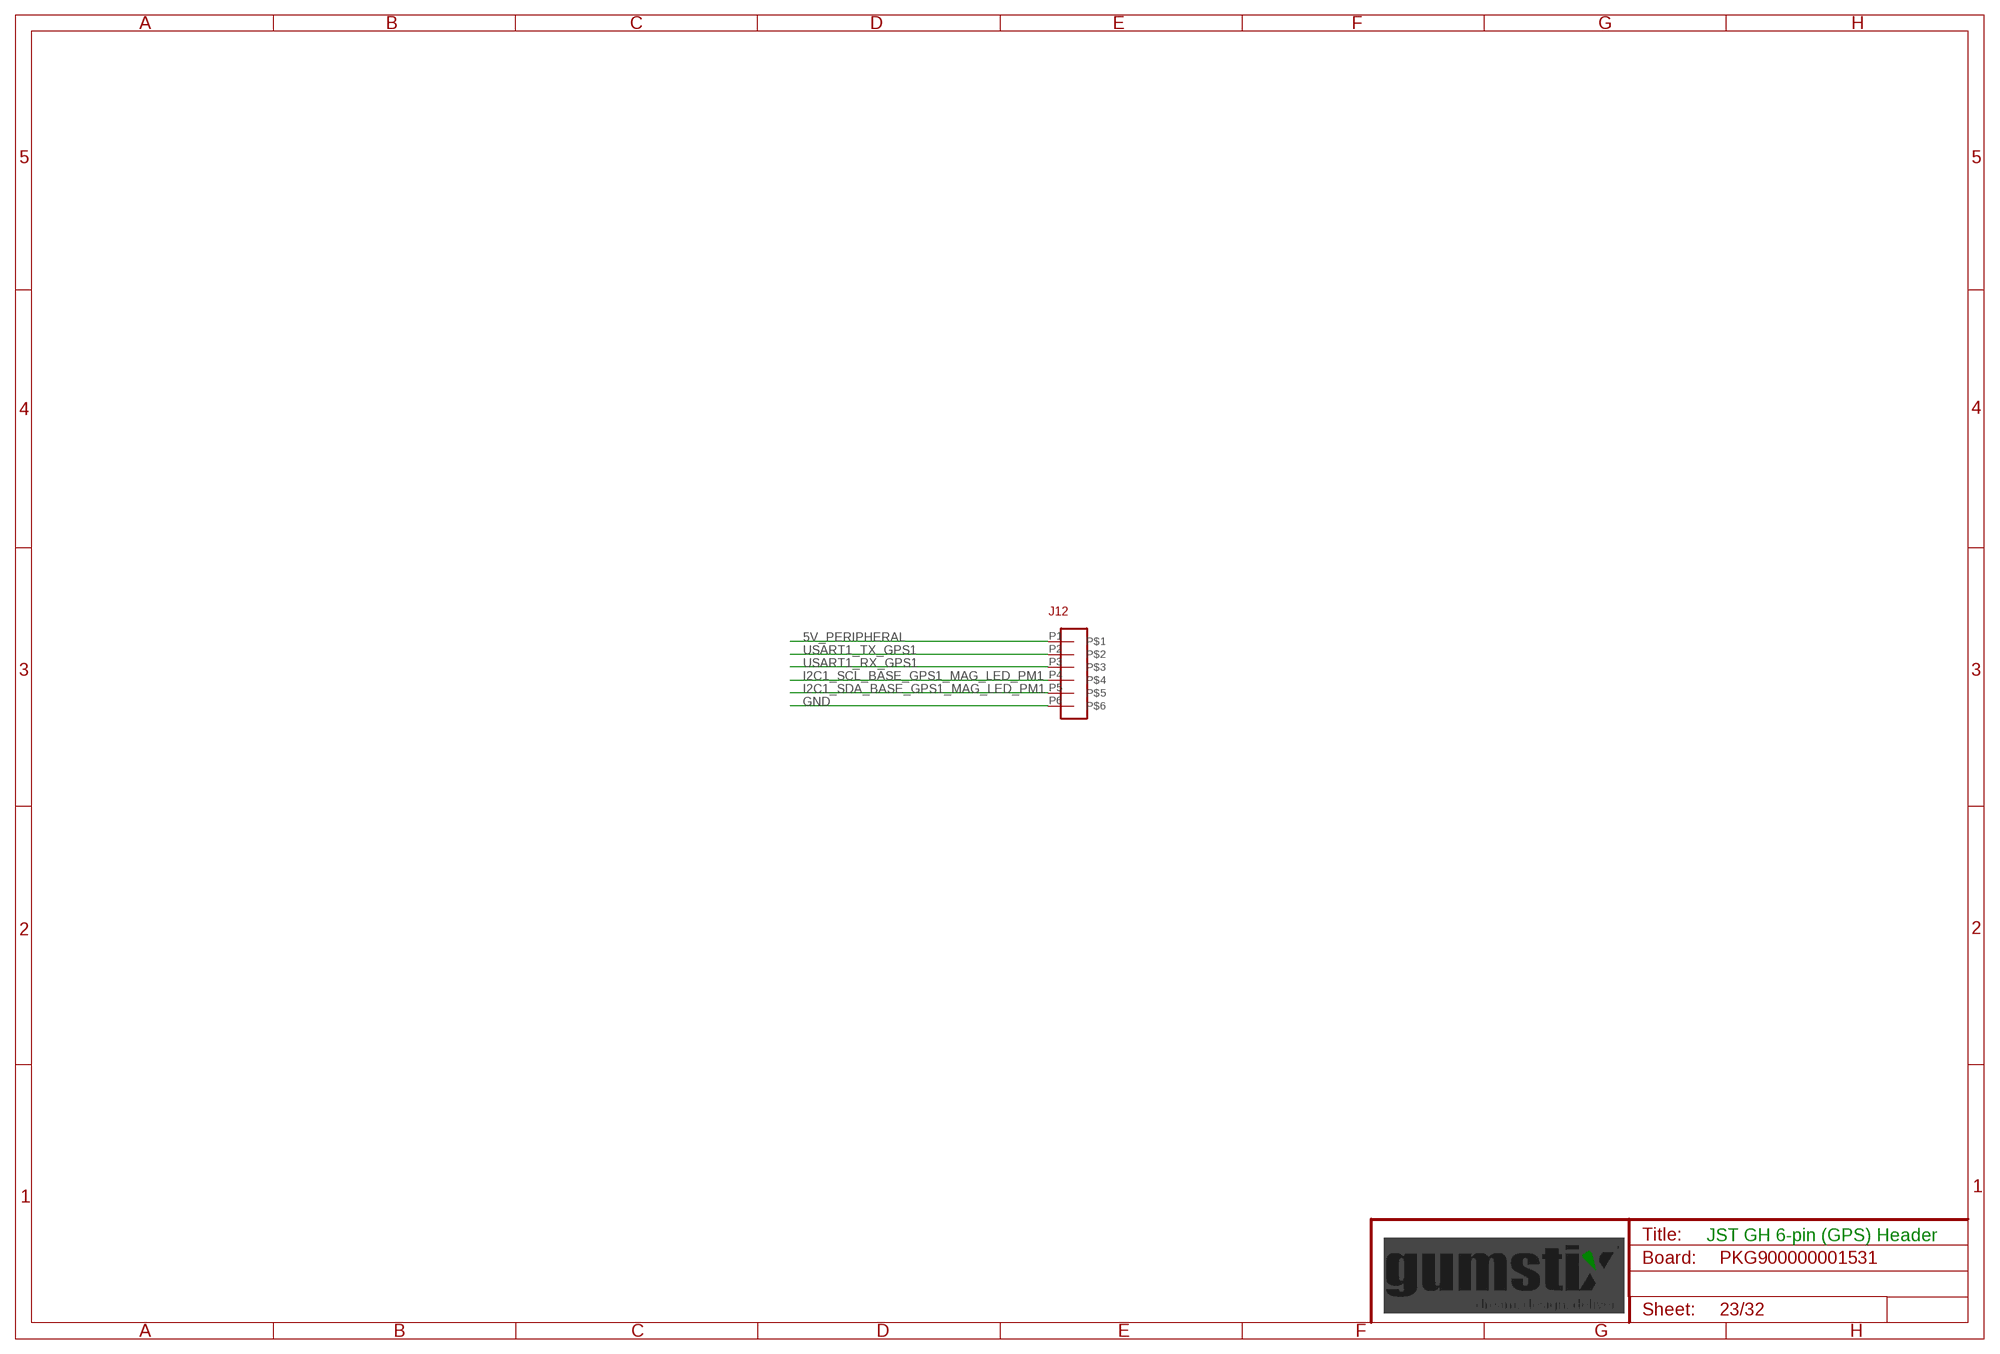
[diagram p22: schematic, sheet 23]

### Parts
J12  JST-GH-6H  [JST-GH-6H]

### Nets
5V_PERIPHERAL [supply]: J12.P1 ; also sheet 3,26,27,29
GND [supply]: J12.P6 ; also sheet 2,3,4,5,6,7,8,9,10,12,13,14,15,16,17,18,19,20,21,22,24,25,26,27,28,29,30,31,32
I2C1_SCL_BASE_GPS1_MAG_LED_PM1: J12.P4 ; also sheet 2
I2C1_SDA_BASE_GPS1_MAG_LED_PM1: J12.P5 ; also sheet 2
USART1_RX_GPS1: J12.P3 ; also sheet 2
USART1_TX_GPS1: J12.P2 ; also sheet 2

### Notes on the sheet
- JST GH 6-pin (GPS) Header

## Sheet 24 of 32
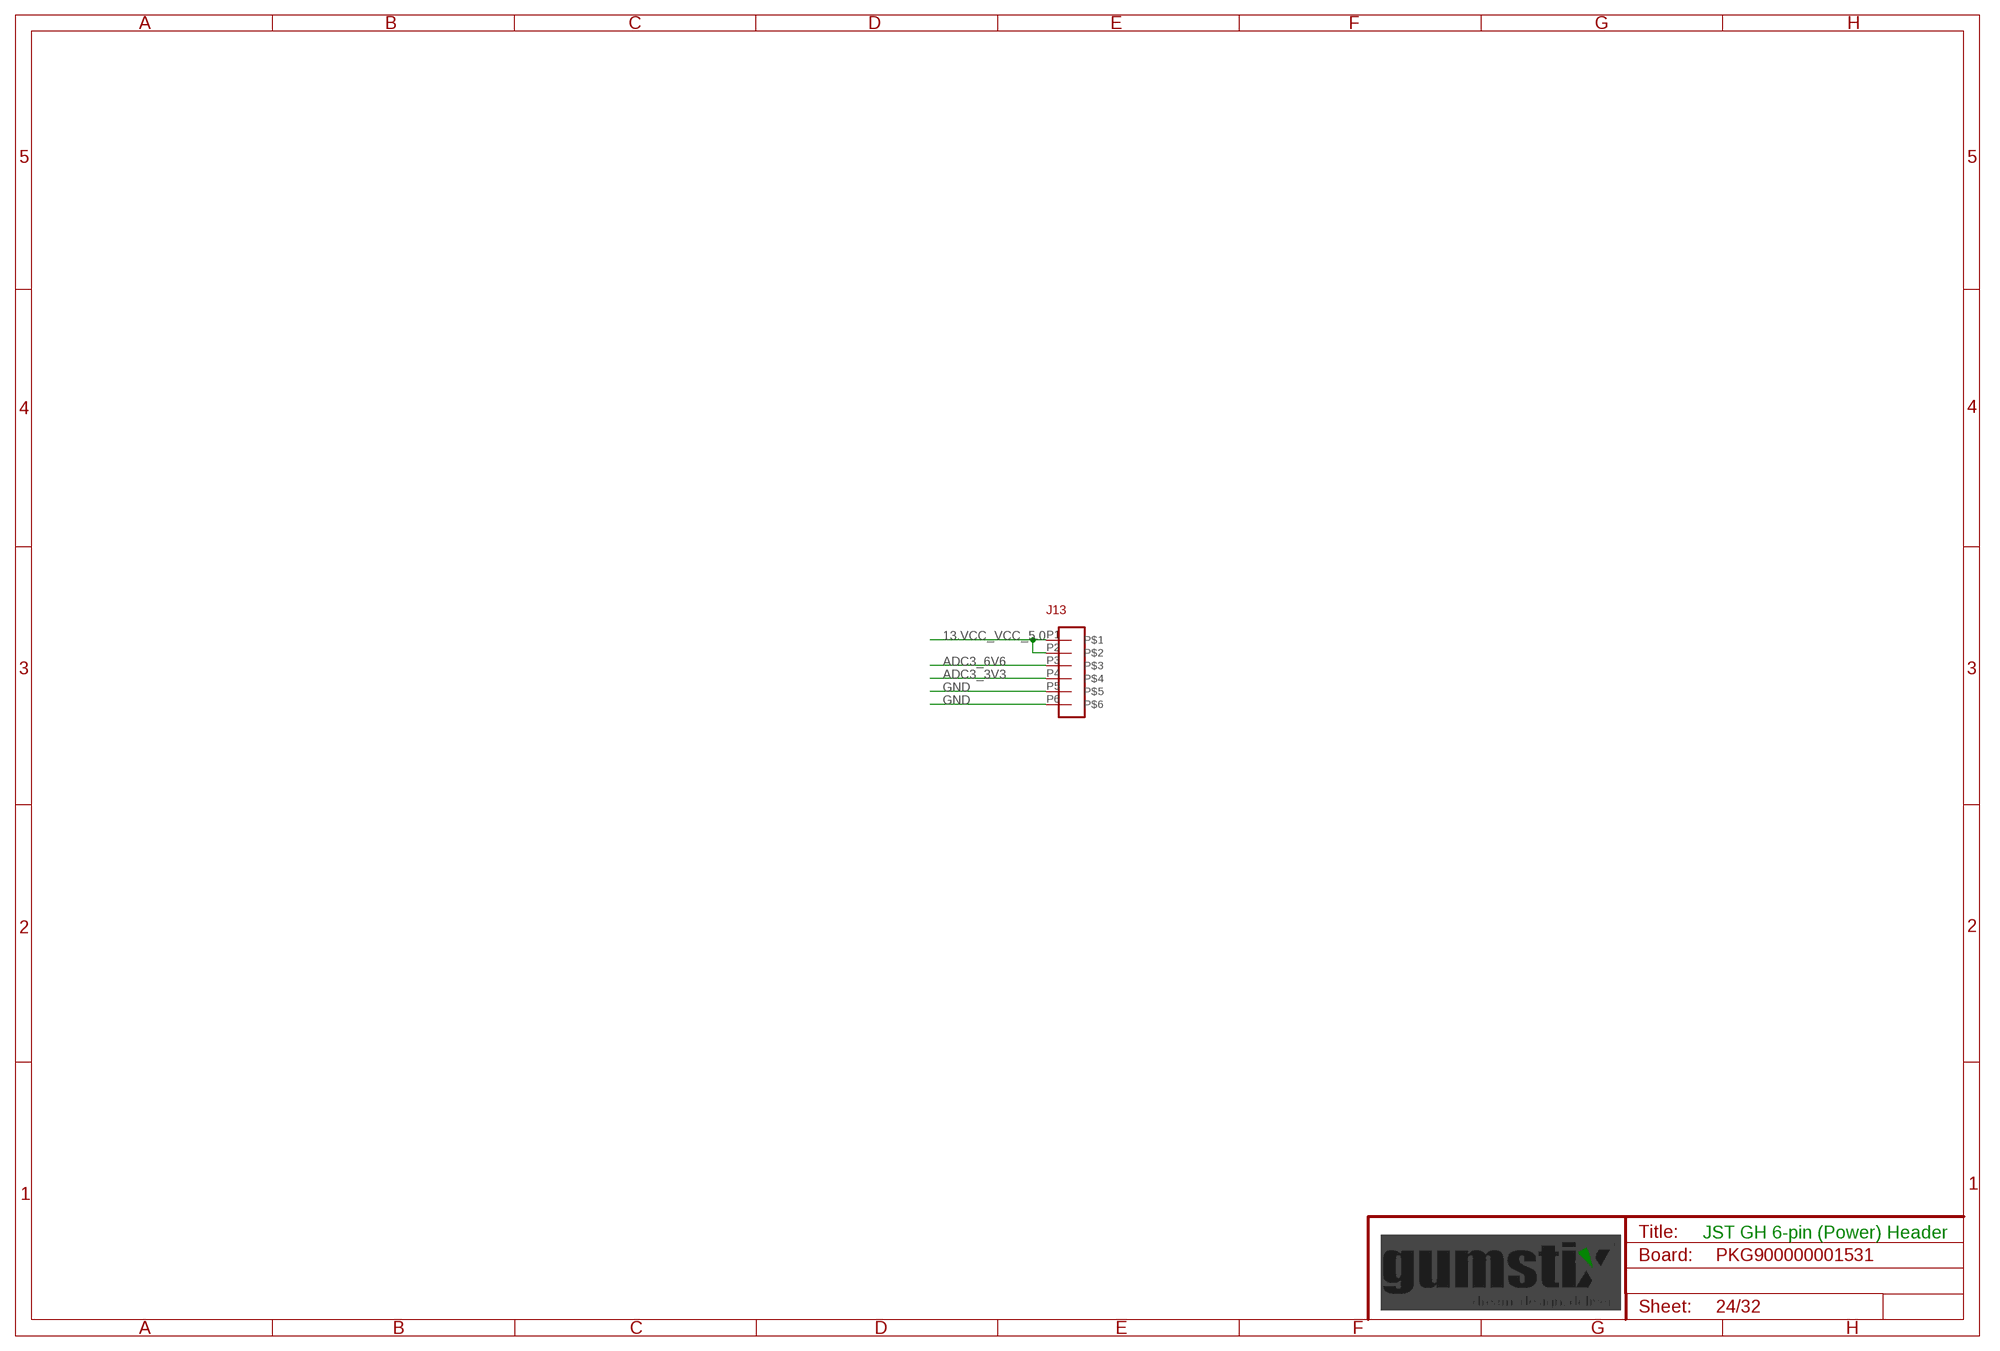
[diagram p23: schematic, sheet 24]

### Parts
J13  JST-GH-6H  [JST-GH-6H]

### Nets
13.VCC_VCC_5.0: J13.P1 J13.P2 ; also sheet 25
ADC3_3V3: J13.P4 ; also sheet 2
ADC3_6V6: J13.P3 ; also sheet 2
GND [supply]: J13.P5 J13.P6 ; also sheet 2,3,4,5,6,7,8,9,10,12,13,14,15,16,17,18,19,20,21,22,23,25,26,27,28,29,30,31,32

### Notes on the sheet
- JST GH 6-pin (Power) Header